# EAGLE schematic 8B_RAM_3 (EAGLE 6.5.0), part 1 of 2

## Sheet 1 of 44
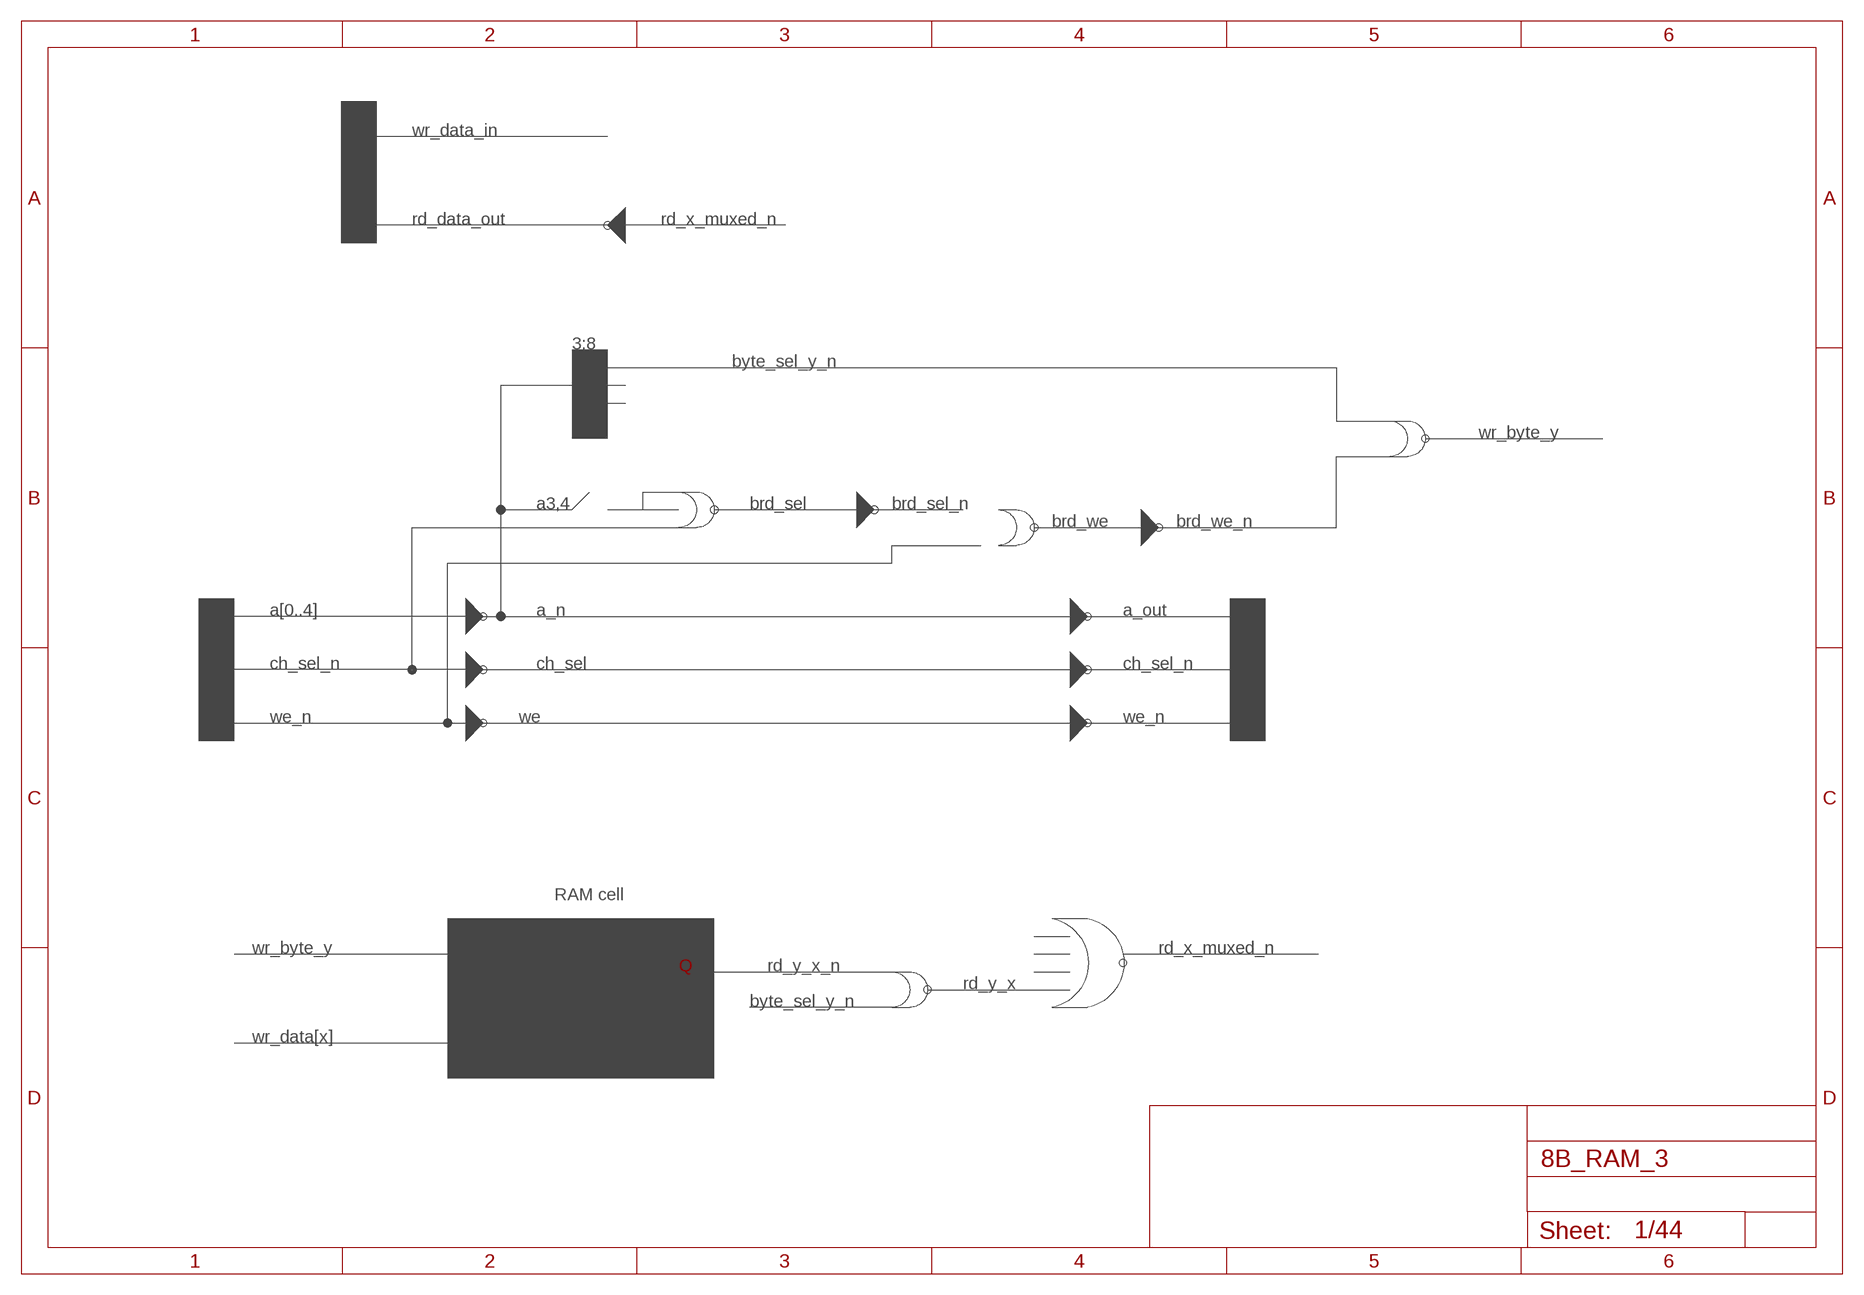
[diagram p0: schematic, sheet 1]

### Notes on the sheet
- wr_data_in
- rd_data_out | rd_x_muxed_n
- 3:8
- byte_sel_y_n
- wr_byte_y
- a3,4 | brd_sel | brd_sel_n
- brd_we | brd_we_n
- a[0..4] | a_n | a_out
- ch_sel_n | ch_sel | ch_sel_n
- we_n | we | we_n
- RAM cell
- wr_byte_y | rd_x_muxed_n
- Q | rd_y_x_n
- RAM cells | rd_y_x
- byte_sel_y_n
- wr_data[x]

## Sheet 2 of 44
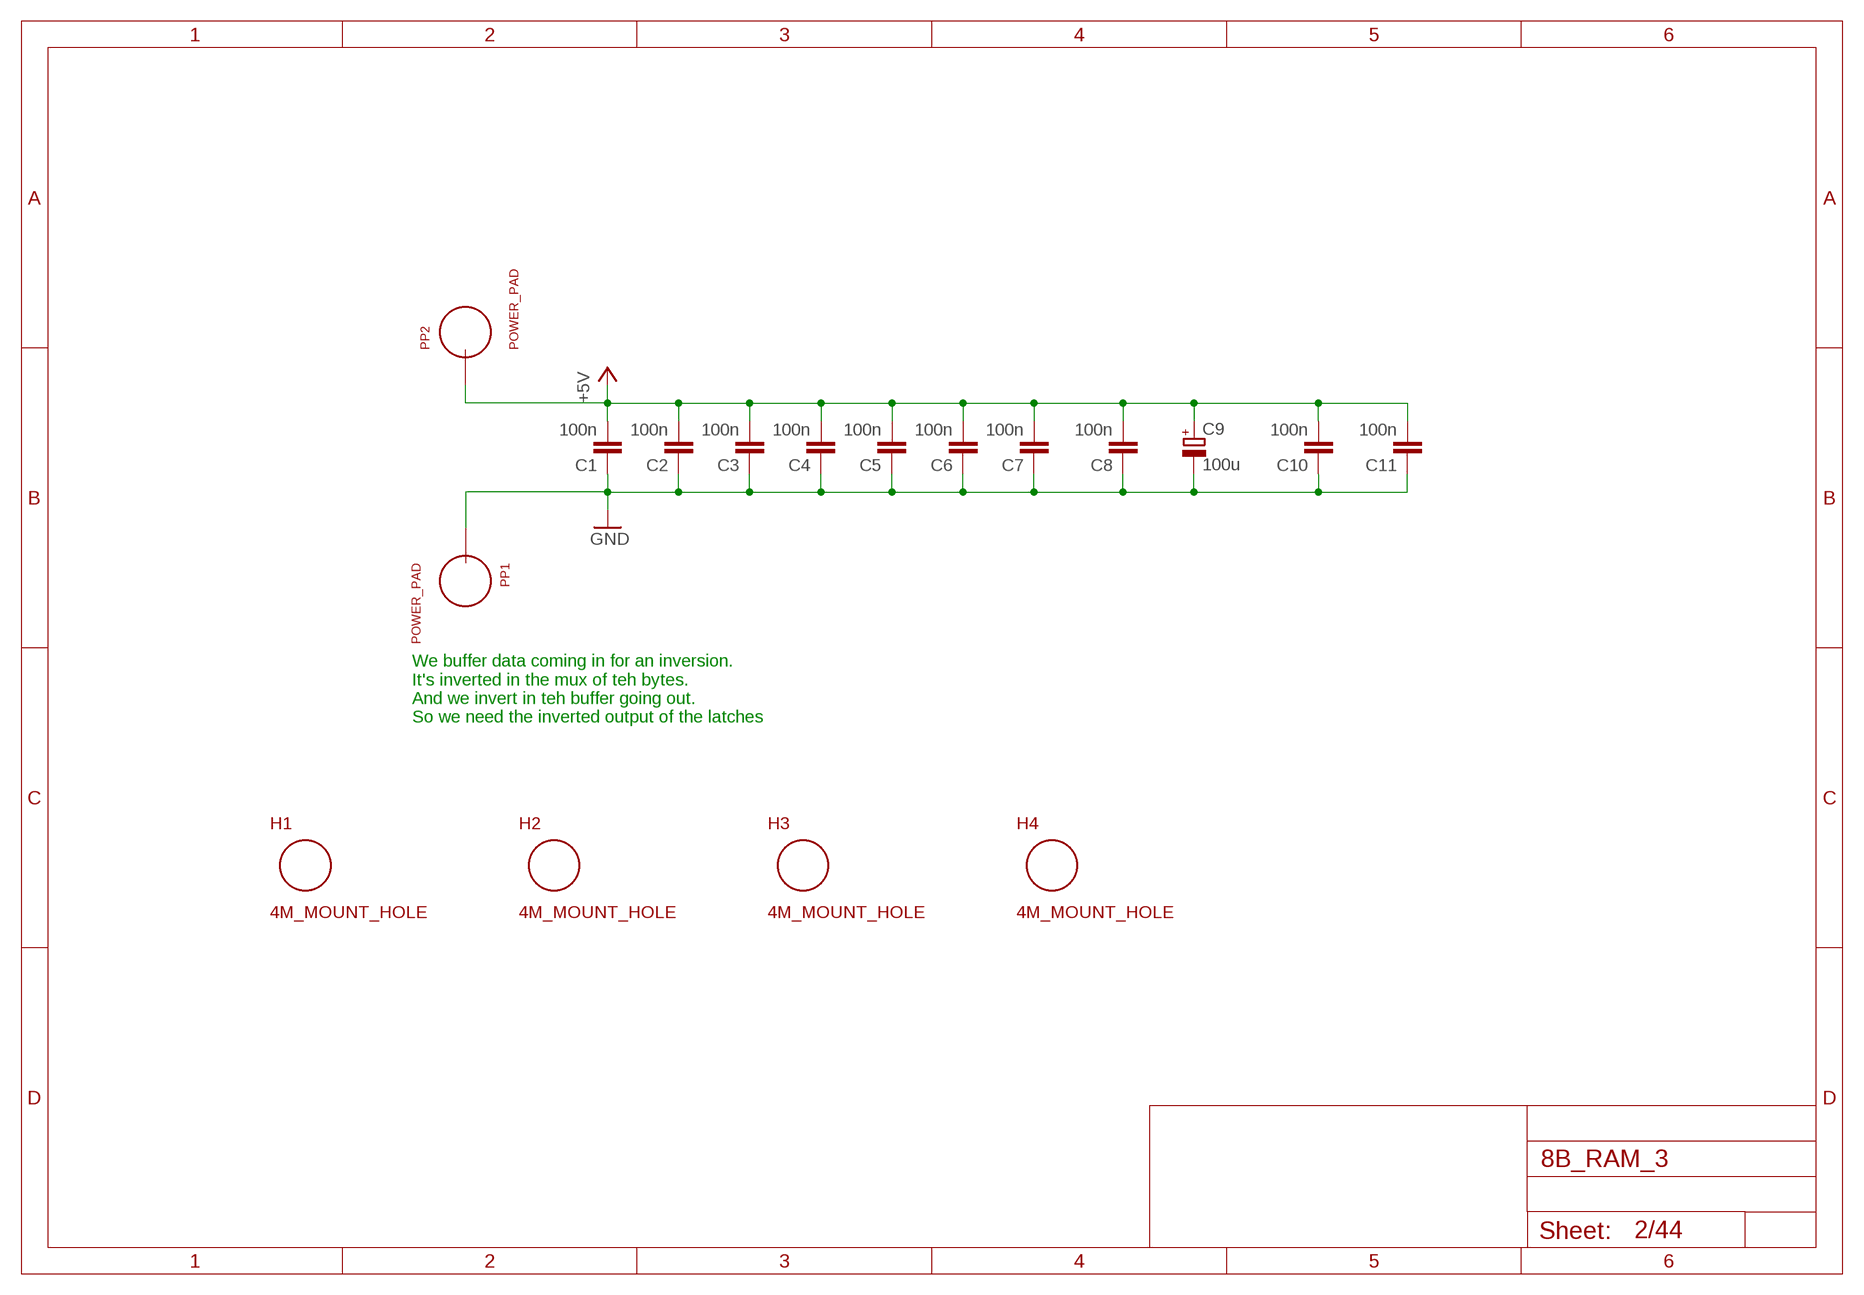
[diagram p1: schematic, sheet 2]

### Parts
C1  100n  C_P2INCH  [CAP_P2INCH]
C2  100n  C_P2INCH  [CAP_P2INCH]
C3  100n  C_P2INCH  [CAP_P2INCH]
C4  100n  C_P2INCH  [CAP_P2INCH]
C5  100n  C_P2INCH  [CAP_P2INCH]
C6  100n  C_P2INCH  [CAP_P2INCH]
C7  100n  C_P2INCH  [CAP_P2INCH]
C8  100n  C_P2INCH  [CAP_P2INCH]
C9  100u  POLARISED_CAP_2P5_6P3MM  [POLARISED_CAP_2P5_6P3MM]
C10  100n  C_P2INCH  [CAP_P2INCH]
C11  100n  C_P2INCH  [CAP_P2INCH]
H1  4M_MOUNT_HOLE  [4M_HOLE]
H2  4M_MOUNT_HOLE  [4M_HOLE]
H3  4M_MOUNT_HOLE  [4M_HOLE]
H4  4M_MOUNT_HOLE  [4M_HOLE]
PP1  POWER_PAD  [POWER_PAD]
PP2  POWER_PAD  [POWER_PAD]

### Nets
+5V: C1.2 C2.2 C3.2 C4.2 C5.2 C6.2 C7.2 C8.2 C9.A C10.2 C11.2 PP2.1 ; also sheet 4,5,6,7,8,9,10,11,12,13,14,15,16,17,18,19,20,21,22,23,24,25,26,27,28,29,30,31,32,33,34,35,36,37,38,39,40,41,42,43,44
GND: C1.1 C2.1 C3.1 C4.1 C5.1 C6.1 C7.1 C8.1 C9.K C10.1 C11.1 PP1.1 ; also sheet 3,4,5,6,7,8,9,10,11,12,13,14,15,16,17,18,19,20,21,22,23,24,25,26,27,28,29,30,31,32,33,34,35,36,37,38,39,40,41,42,43,44

### Notes on the sheet
- We buffer data coming in for an inversion.
  It's inverted in the mux of teh bytes.
  And we invert in teh buffer going out.
  So we need the inverted output of the latches

## Sheet 3 of 44
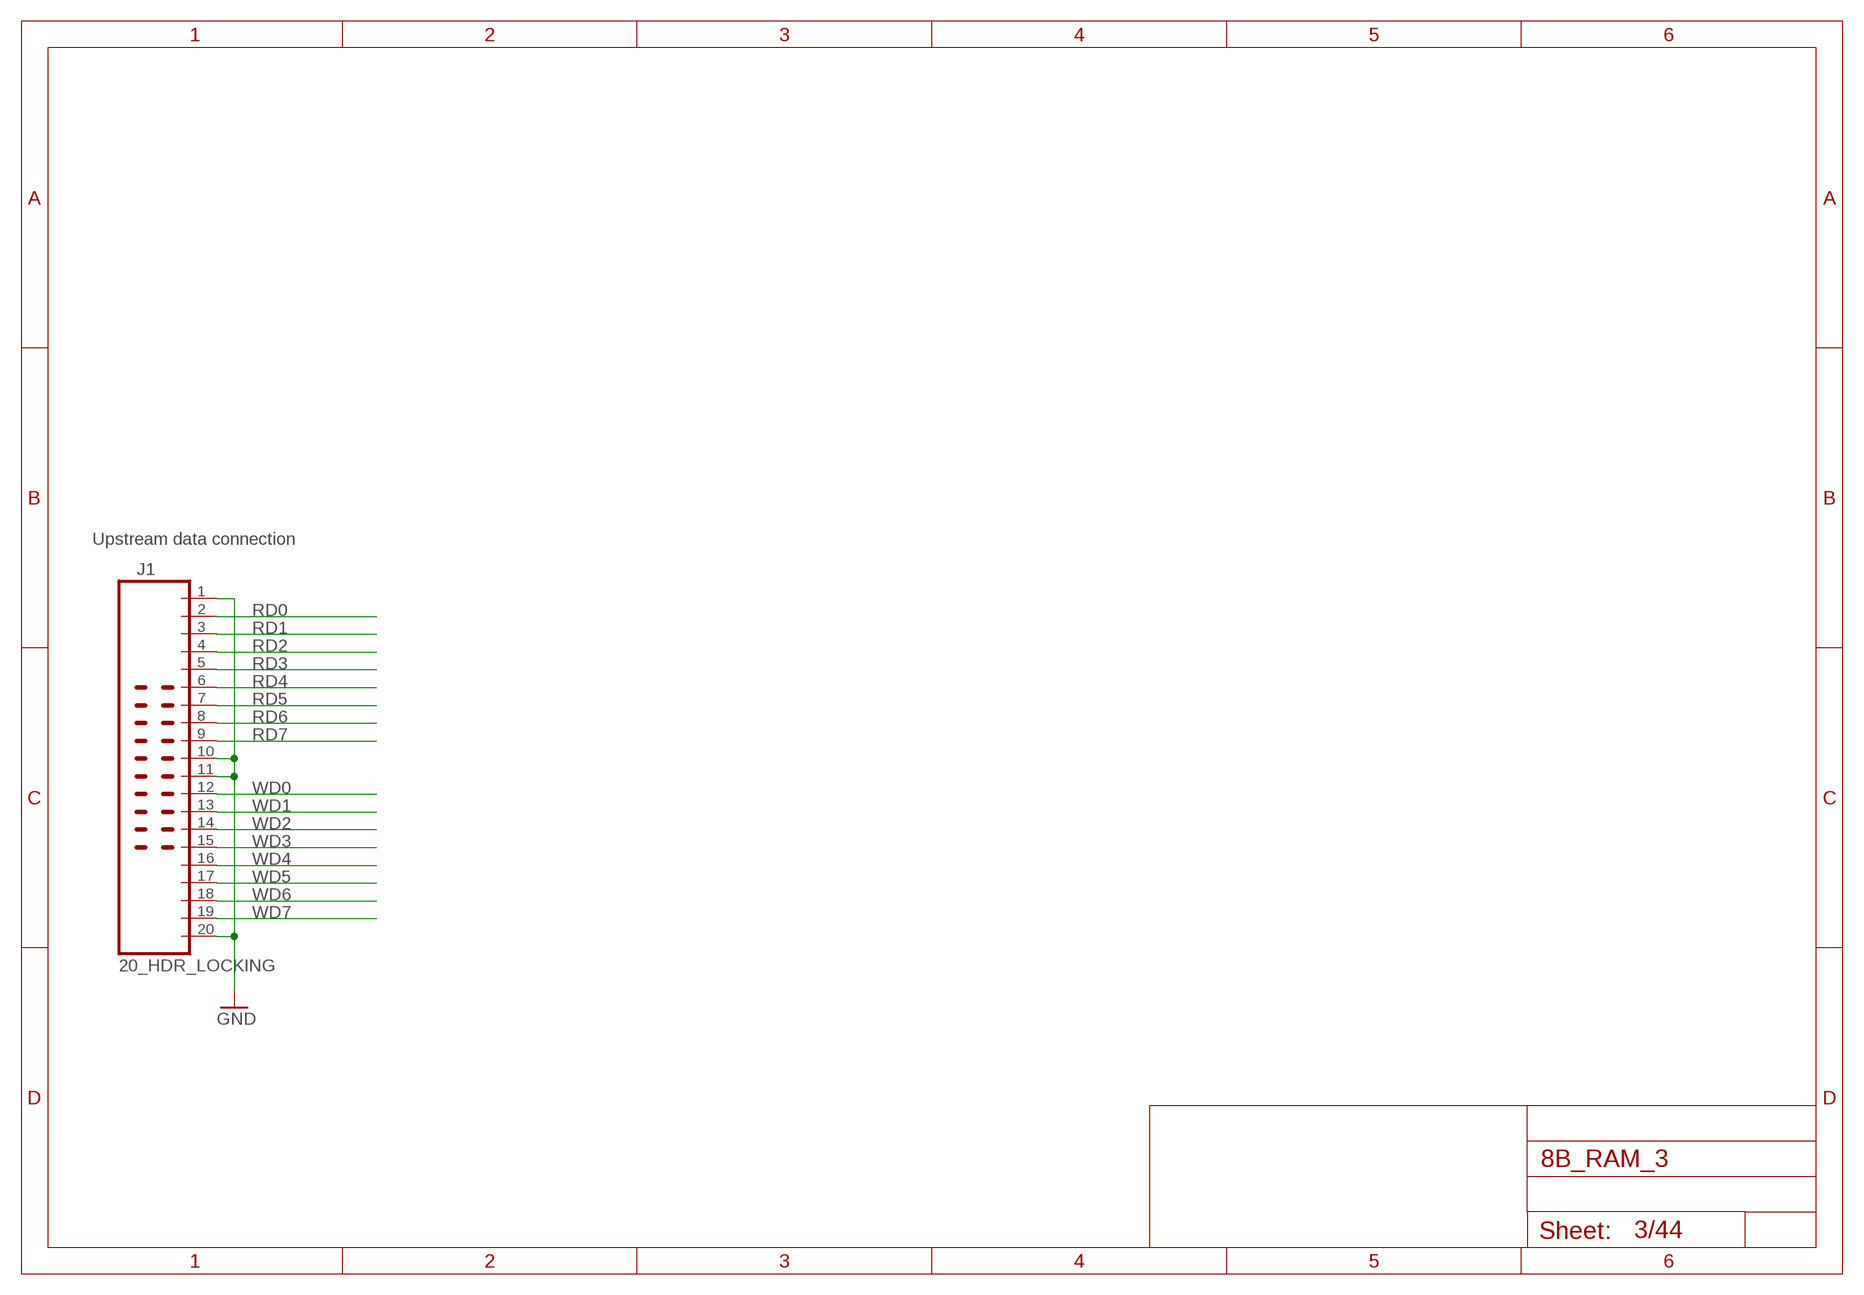
[diagram p2: schematic, sheet 3]

### Parts
J1  20_HDR_LOCKING  [20_HDR_LOCKING]

### Nets
GND: J1.1 J1.10 J1.11 J1.20 ; also sheet 2,4,5,6,7,8,9,10,11,12,13,14,15,16,17,18,19,20,21,22,23,24,25,26,27,28,29,30,31,32,33,34,35,36,37,38,39,40,41,42,43,44
RD0: J1.2 ; also sheet 41
RD1: J1.3 ; also sheet 41
RD2: J1.4 ; also sheet 42
RD3: J1.5 ; also sheet 42
RD4: J1.6 ; also sheet 43
RD5: J1.7 ; also sheet 43
RD6: J1.8 ; also sheet 44
RD7: J1.9 ; also sheet 44
WD0: J1.12 ; also sheet 9,13,17,21,25,29,33,37
WD1: J1.13 ; also sheet 9,13,17,21,25,29,33,37
WD2: J1.14 ; also sheet 10,14,18,22,26,30,34,38
WD3: J1.15 ; also sheet 10,14,18,22,26,30,34,38
WD4: J1.16 ; also sheet 11,15,19,23,27,31,35,39
WD5: J1.17 ; also sheet 11,15,19,23,27,31,35,39
WD6: J1.18 ; also sheet 12,16,20,24,28,32,36,40
WD7: J1.19 ; also sheet 12,16,20,24,28,32,36,40

### Notes on the sheet
- Upstream data connection

## Sheet 4 of 44
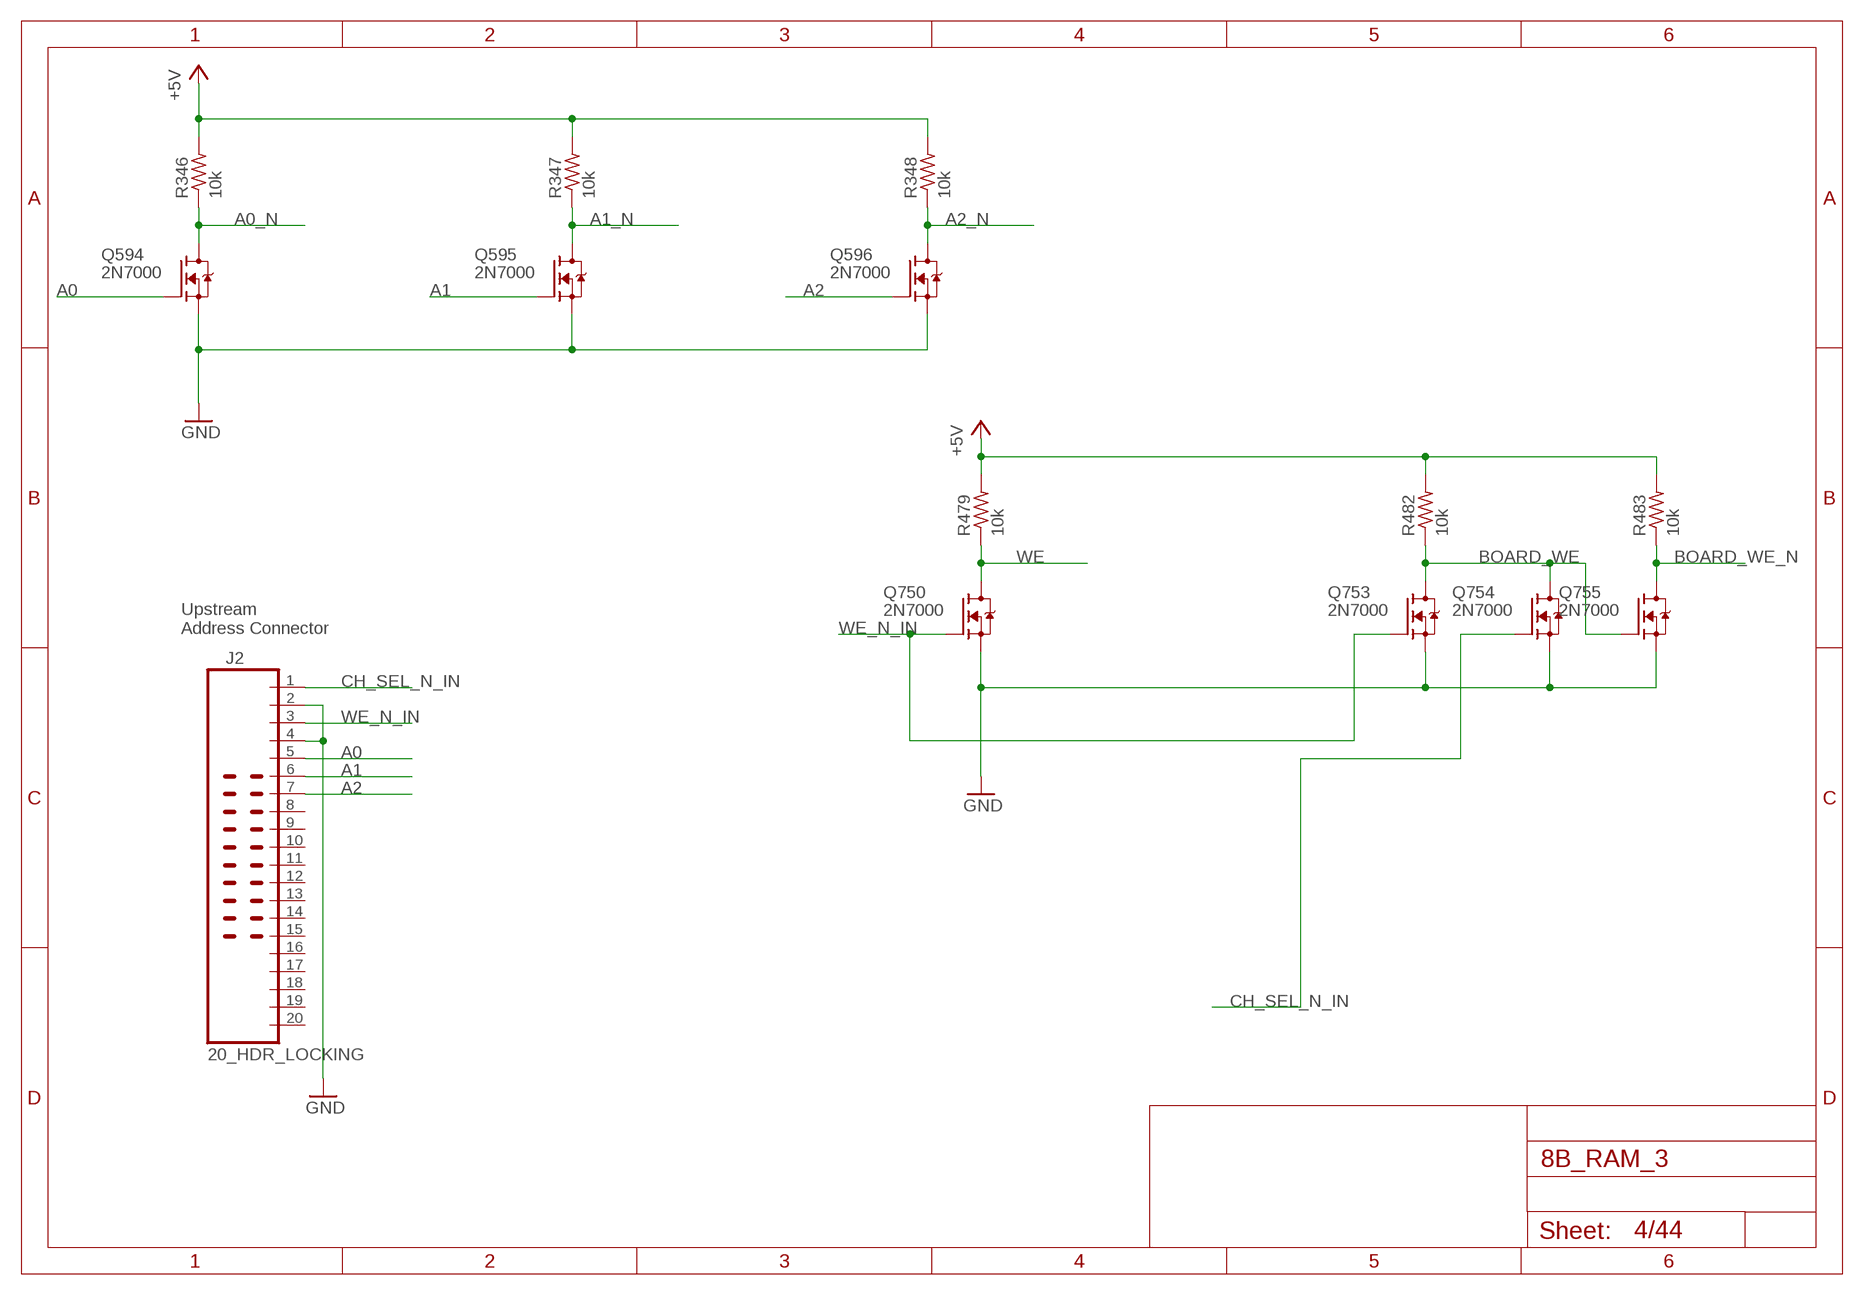
[diagram p3: schematic, sheet 4]

### Parts
J2  20_HDR_LOCKING  [20_HDR_LOCKING]
Q594  2N7000  [TO92-DGS]
Q595  2N7000  [TO92-DGS]
Q596  2N7000  [TO92-DGS]
Q750  2N7000  [TO92-DGS]
Q753  2N7000  [TO92-DGS]
Q754  2N7000  [TO92-DGS]
Q755  2N7000  [TO92-DGS]
R346  10k  R_P2INCH  [R_P2INCH]
R347  10k  R_P2INCH  [R_P2INCH]
R348  10k  R_P2INCH  [R_P2INCH]
R479  10k  R_P2INCH  [R_P2INCH]
R482  10k  R_P2INCH  [R_P2INCH]
R483  10k  R_P2INCH  [R_P2INCH]

### Nets
+5V: R346.2 R347.2 R348.2 R479.2 R482.2 R483.2 ; also sheet 2,5,6,7,8,9,10,11,12,13,14,15,16,17,18,19,20,21,22,23,24,25,26,27,28,29,30,31,32,33,34,35,36,37,38,39,40,41,42,43,44
A0: J2.5 Q594.G ; also sheet 5,6,7,8
A0_N: Q594.D R346.1 ; also sheet 5,6,7,8
A1: J2.6 Q595.G ; also sheet 6,8
A1_N: Q595.D R347.1 ; also sheet 5,7
A2: J2.7 Q596.G ; also sheet 7,8
A2_N: Q596.D R348.1 ; also sheet 5,6
BOARD_WE: Q753.D Q754.D Q755.G R482.1
BOARD_WE_N: Q755.D R483.1 ; also sheet 5,6,7,8
CH_SEL_N_IN: J2.1 Q754.G
GND: J2.2 J2.4 Q594.S Q595.S Q596.S Q750.S Q753.S Q754.S Q755.S ; also sheet 2,3,5,6,7,8,9,10,11,12,13,14,15,16,17,18,19,20,21,22,23,24,25,26,27,28,29,30,31,32,33,34,35,36,37,38,39,40,41,42,43,44
WE: Q750.D R479.1
WE_N_IN: J2.3 Q750.G Q753.G
Unconnected: J2.8 J2.9 J2.10 J2.11 J2.12 J2.13 J2.14 J2.15 J2.16 J2.17 J2.18 J2.19 J2.20

### Notes on the sheet
- Upstream
  Address Connector

## Sheet 5 of 44
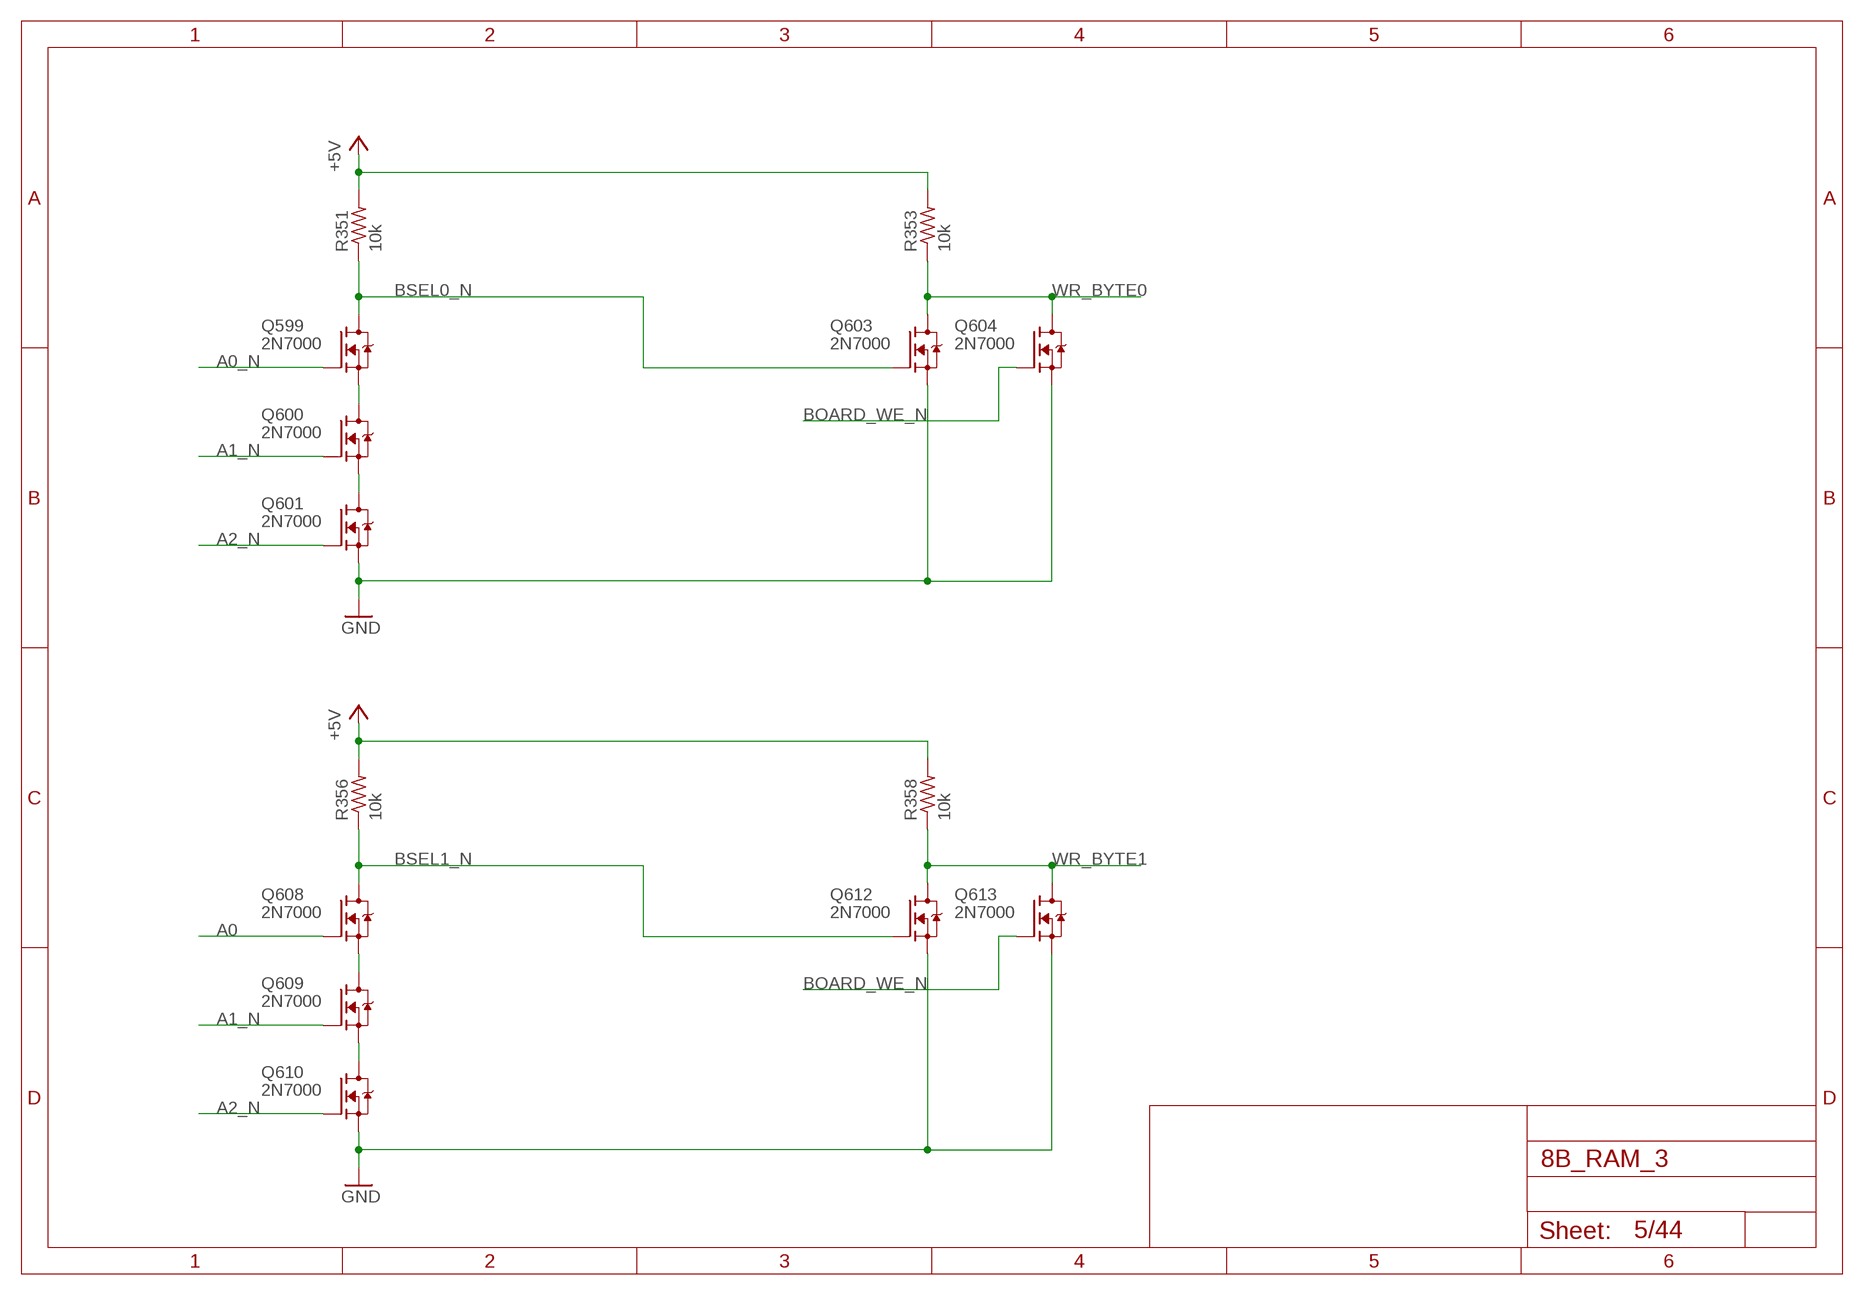
[diagram p4: schematic, sheet 5]

### Parts
Q599  2N7000  [TO92-DGS]
Q600  2N7000  [TO92-DGS]
Q601  2N7000  [TO92-DGS]
Q603  2N7000  [TO92-DGS]
Q604  2N7000  [TO92-DGS]
Q608  2N7000  [TO92-DGS]
Q609  2N7000  [TO92-DGS]
Q610  2N7000  [TO92-DGS]
Q612  2N7000  [TO92-DGS]
Q613  2N7000  [TO92-DGS]
R351  10k  R_P2INCH  [R_P2INCH]
R353  10k  R_P2INCH  [R_P2INCH]
R356  10k  R_P2INCH  [R_P2INCH]
R358  10k  R_P2INCH  [R_P2INCH]

### Nets
+5V: R351.2 R353.2 R356.2 R358.2 ; also sheet 2,4,6,7,8,9,10,11,12,13,14,15,16,17,18,19,20,21,22,23,24,25,26,27,28,29,30,31,32,33,34,35,36,37,38,39,40,41,42,43,44
A0: Q608.G ; also sheet 4,6,7,8
A0_N: Q599.G ; also sheet 4,6,7,8
A1_N: Q600.G Q609.G ; also sheet 4,7
A2_N: Q601.G Q610.G ; also sheet 4,6
BOARD_WE_N: Q604.G Q613.G ; also sheet 4,6,7,8
BSEL0_N: Q599.D Q603.G R351.1 ; also sheet 9,10,11,12
BSEL1_N: Q608.D Q612.G R356.1 ; also sheet 13,14,15,16
GND: Q601.S Q603.S Q604.S Q610.S Q612.S Q613.S ; also sheet 2,3,4,6,7,8,9,10,11,12,13,14,15,16,17,18,19,20,21,22,23,24,25,26,27,28,29,30,31,32,33,34,35,36,37,38,39,40,41,42,43,44
N$449: Q608.S Q609.D
N$451: Q599.S Q600.D
N$452: Q600.S Q601.D
N$454: Q609.S Q610.D
WR_BYTE0: Q603.D Q604.D R353.1 ; also sheet 9,10,11,12
WR_BYTE1: Q612.D Q613.D R358.1 ; also sheet 13,14,15,16

## Sheet 6 of 44
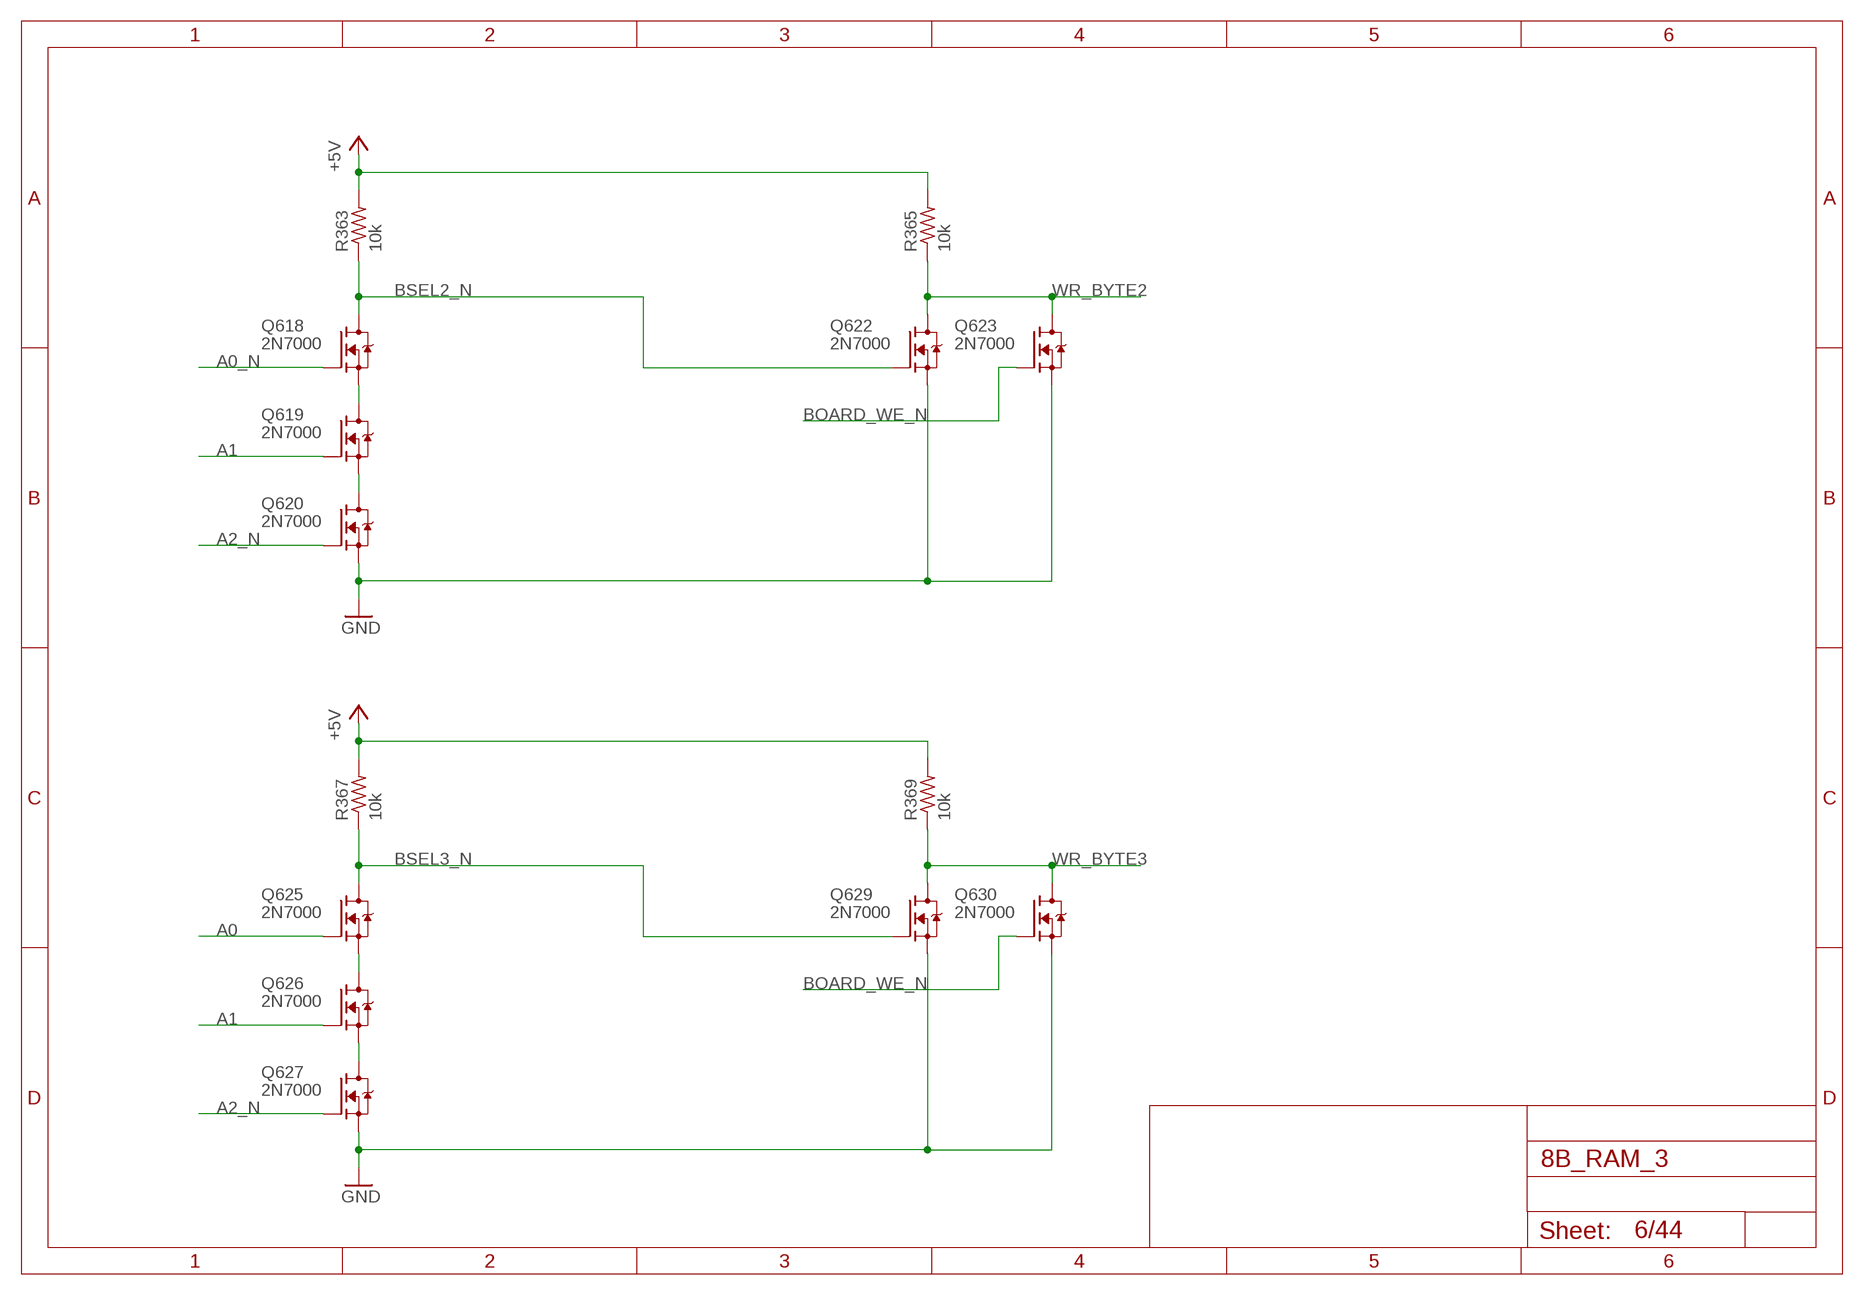
[diagram p5: schematic, sheet 6]

### Parts
Q618  2N7000  [TO92-DGS]
Q619  2N7000  [TO92-DGS]
Q620  2N7000  [TO92-DGS]
Q622  2N7000  [TO92-DGS]
Q623  2N7000  [TO92-DGS]
Q625  2N7000  [TO92-DGS]
Q626  2N7000  [TO92-DGS]
Q627  2N7000  [TO92-DGS]
Q629  2N7000  [TO92-DGS]
Q630  2N7000  [TO92-DGS]
R363  10k  R_P2INCH  [R_P2INCH]
R365  10k  R_P2INCH  [R_P2INCH]
R367  10k  R_P2INCH  [R_P2INCH]
R369  10k  R_P2INCH  [R_P2INCH]

### Nets
+5V: R363.2 R365.2 R367.2 R369.2 ; also sheet 2,4,5,7,8,9,10,11,12,13,14,15,16,17,18,19,20,21,22,23,24,25,26,27,28,29,30,31,32,33,34,35,36,37,38,39,40,41,42,43,44
A0: Q625.G ; also sheet 4,5,7,8
A0_N: Q618.G ; also sheet 4,5,7,8
A1: Q619.G Q626.G ; also sheet 4,8
A2_N: Q620.G Q627.G ; also sheet 4,5
BOARD_WE_N: Q623.G Q630.G ; also sheet 4,5,7,8
BSEL2_N: Q618.D Q622.G R363.1 ; also sheet 17,18,19,20
BSEL3_N: Q625.D Q629.G R367.1 ; also sheet 21,22,23,24
GND: Q620.S Q622.S Q623.S Q627.S Q629.S Q630.S ; also sheet 2,3,4,5,7,8,9,10,11,12,13,14,15,16,17,18,19,20,21,22,23,24,25,26,27,28,29,30,31,32,33,34,35,36,37,38,39,40,41,42,43,44
N$455: Q618.S Q619.D
N$456: Q619.S Q620.D
N$457: Q625.S Q626.D
N$458: Q626.S Q627.D
WR_BYTE2: Q622.D Q623.D R365.1 ; also sheet 17,18,19,20
WR_BYTE3: Q629.D Q630.D R369.1 ; also sheet 21,22,23,24

## Sheet 7 of 44
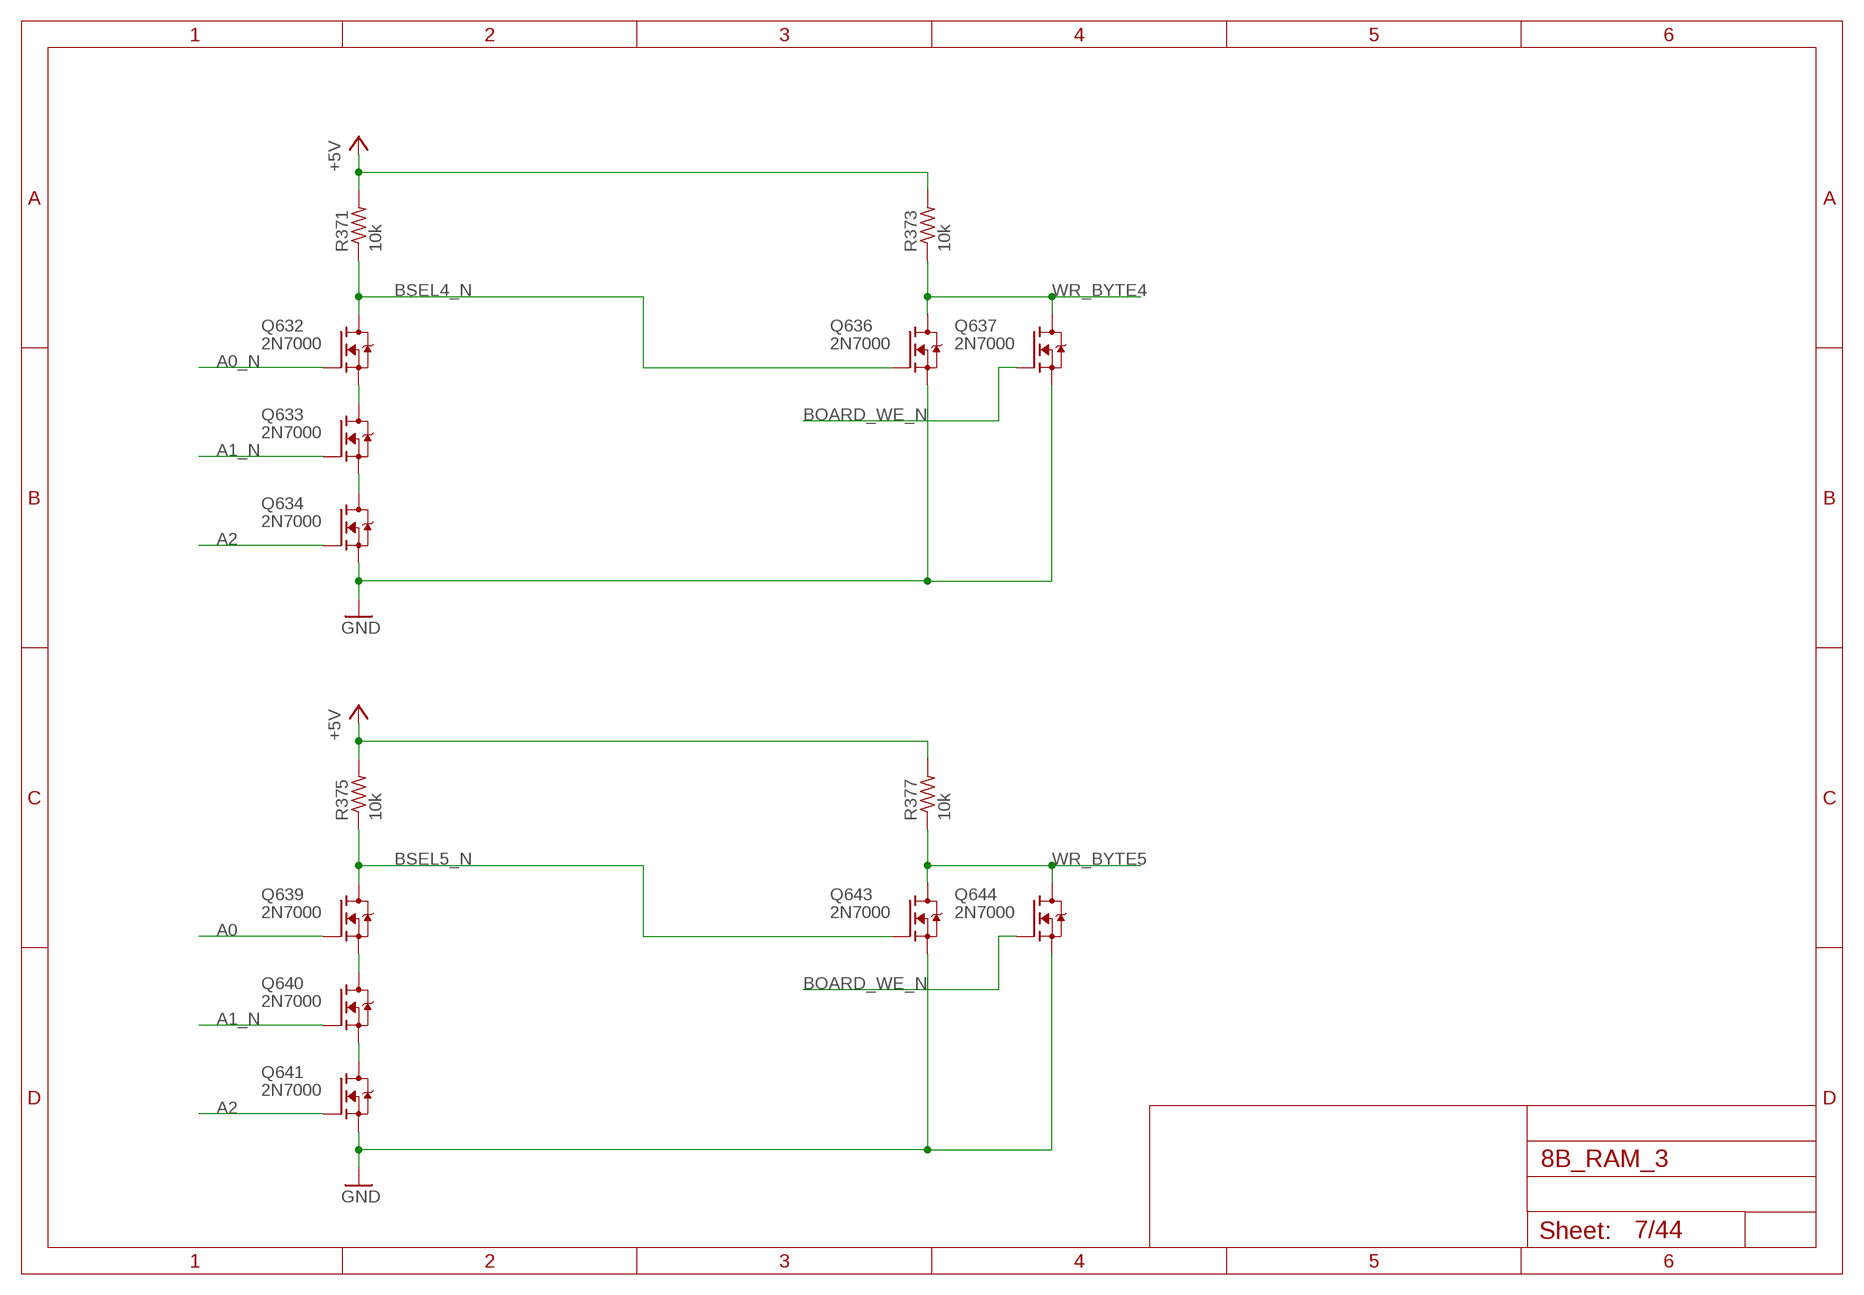
[diagram p6: schematic, sheet 7]

### Parts
Q632  2N7000  [TO92-DGS]
Q633  2N7000  [TO92-DGS]
Q634  2N7000  [TO92-DGS]
Q636  2N7000  [TO92-DGS]
Q637  2N7000  [TO92-DGS]
Q639  2N7000  [TO92-DGS]
Q640  2N7000  [TO92-DGS]
Q641  2N7000  [TO92-DGS]
Q643  2N7000  [TO92-DGS]
Q644  2N7000  [TO92-DGS]
R371  10k  R_P2INCH  [R_P2INCH]
R373  10k  R_P2INCH  [R_P2INCH]
R375  10k  R_P2INCH  [R_P2INCH]
R377  10k  R_P2INCH  [R_P2INCH]

### Nets
+5V: R371.2 R373.2 R375.2 R377.2 ; also sheet 2,4,5,6,8,9,10,11,12,13,14,15,16,17,18,19,20,21,22,23,24,25,26,27,28,29,30,31,32,33,34,35,36,37,38,39,40,41,42,43,44
A0: Q639.G ; also sheet 4,5,6,8
A0_N: Q632.G ; also sheet 4,5,6,8
A1_N: Q633.G Q640.G ; also sheet 4,5
A2: Q634.G Q641.G ; also sheet 4,8
BOARD_WE_N: Q637.G Q644.G ; also sheet 4,5,6,8
BSEL4_N: Q632.D Q636.G R371.1 ; also sheet 25,26,27,28
BSEL5_N: Q639.D Q643.G R375.1 ; also sheet 29,30,31,32
GND: Q634.S Q636.S Q637.S Q641.S Q643.S Q644.S ; also sheet 2,3,4,5,6,8,9,10,11,12,13,14,15,16,17,18,19,20,21,22,23,24,25,26,27,28,29,30,31,32,33,34,35,36,37,38,39,40,41,42,43,44
N$459: Q632.S Q633.D
N$460: Q633.S Q634.D
N$461: Q639.S Q640.D
N$462: Q640.S Q641.D
WR_BYTE4: Q636.D Q637.D R373.1 ; also sheet 25,26,27,28
WR_BYTE5: Q643.D Q644.D R377.1 ; also sheet 29,30,31,32

## Sheet 8 of 44
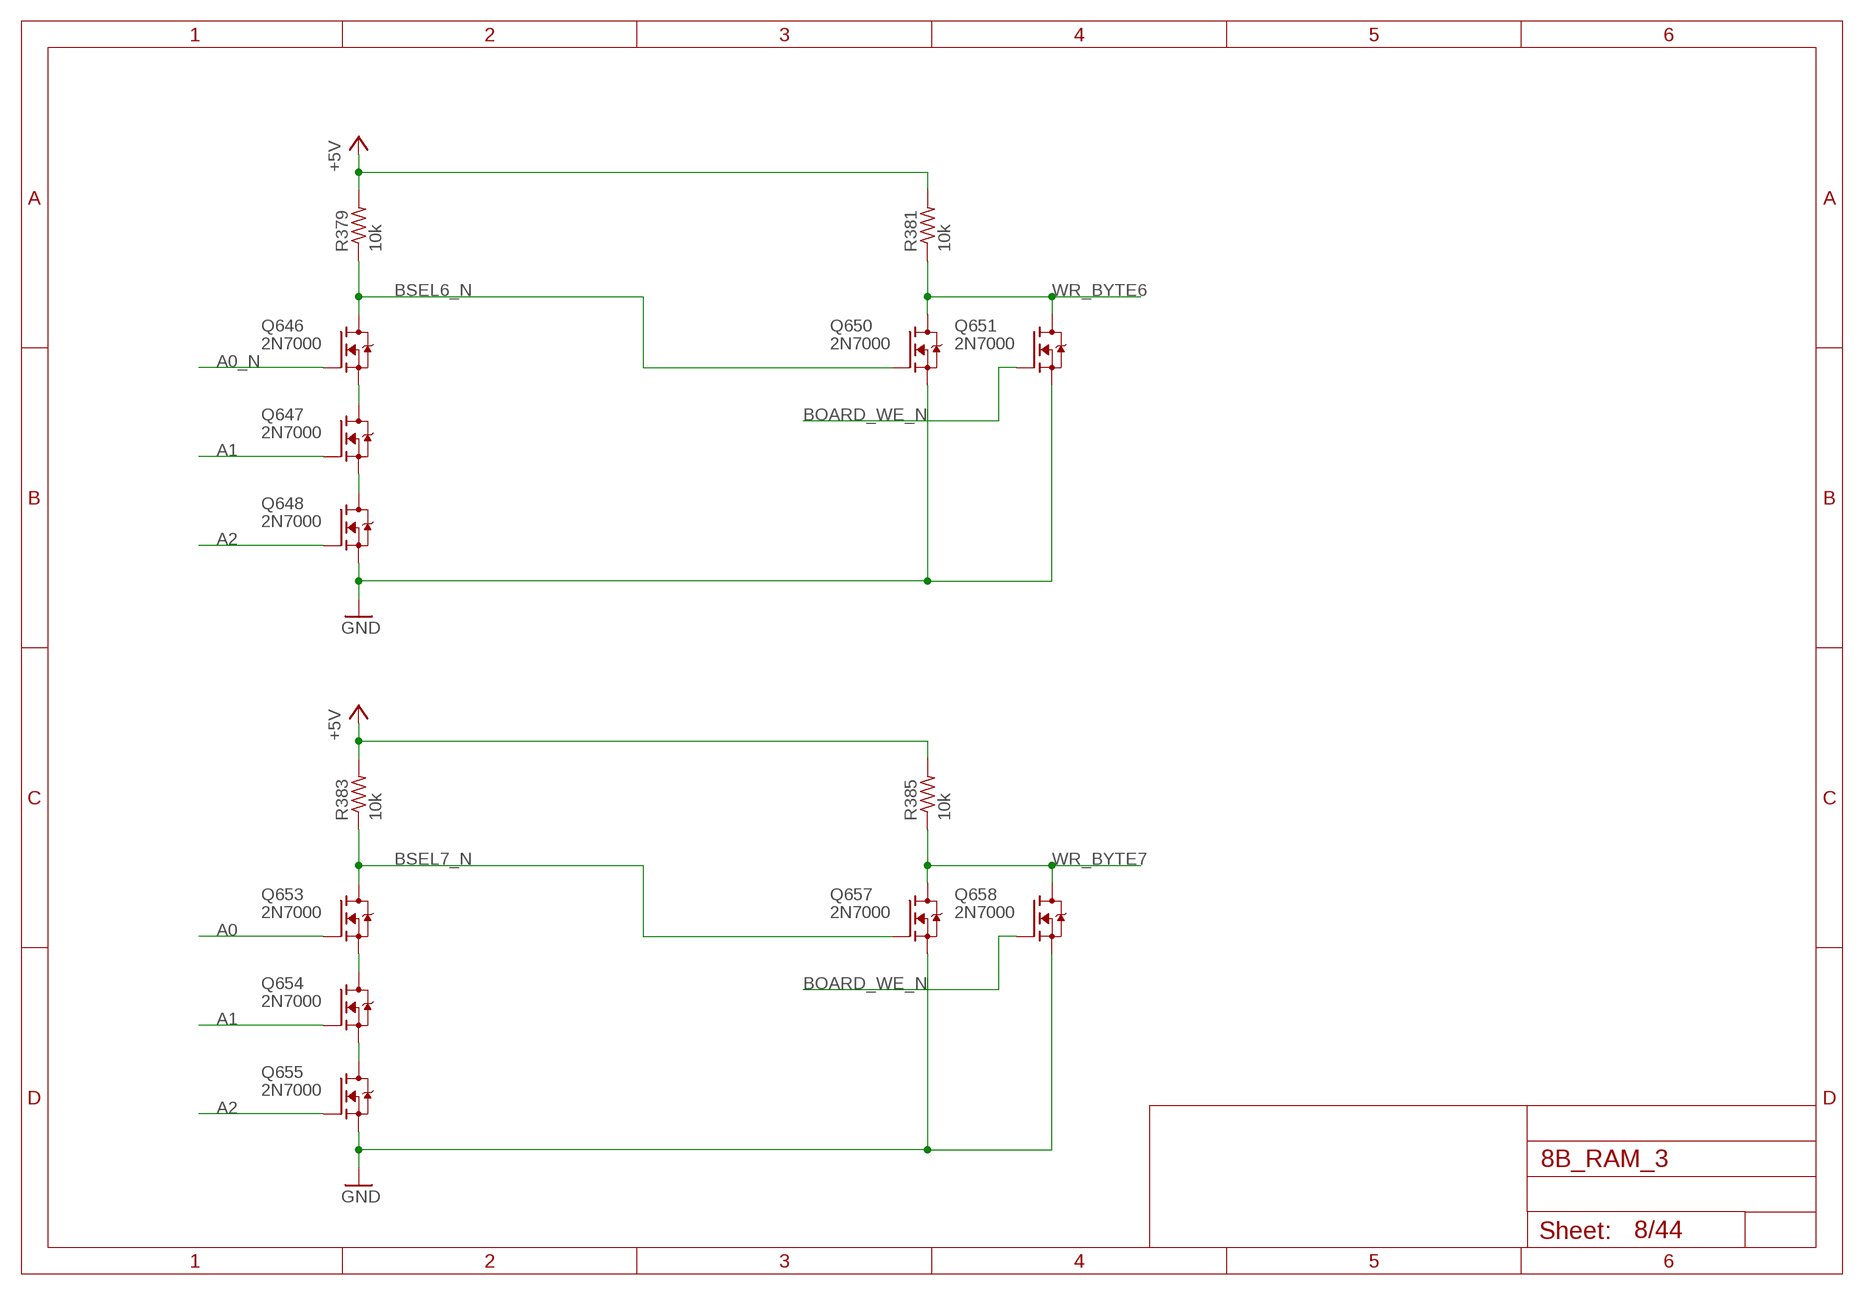
[diagram p7: schematic, sheet 8]

### Parts
Q646  2N7000  [TO92-DGS]
Q647  2N7000  [TO92-DGS]
Q648  2N7000  [TO92-DGS]
Q650  2N7000  [TO92-DGS]
Q651  2N7000  [TO92-DGS]
Q653  2N7000  [TO92-DGS]
Q654  2N7000  [TO92-DGS]
Q655  2N7000  [TO92-DGS]
Q657  2N7000  [TO92-DGS]
Q658  2N7000  [TO92-DGS]
R379  10k  R_P2INCH  [R_P2INCH]
R381  10k  R_P2INCH  [R_P2INCH]
R383  10k  R_P2INCH  [R_P2INCH]
R385  10k  R_P2INCH  [R_P2INCH]

### Nets
+5V: R379.2 R381.2 R383.2 R385.2 ; also sheet 2,4,5,6,7,9,10,11,12,13,14,15,16,17,18,19,20,21,22,23,24,25,26,27,28,29,30,31,32,33,34,35,36,37,38,39,40,41,42,43,44
A0: Q653.G ; also sheet 4,5,6,7
A0_N: Q646.G ; also sheet 4,5,6,7
A1: Q647.G Q654.G ; also sheet 4,6
A2: Q648.G Q655.G ; also sheet 4,7
BOARD_WE_N: Q651.G Q658.G ; also sheet 4,5,6,7
BSEL6_N: Q646.D Q650.G R379.1 ; also sheet 33,34,35,36
BSEL7_N: Q653.D Q657.G R383.1 ; also sheet 37,38,39,40
GND: Q648.S Q650.S Q651.S Q655.S Q657.S Q658.S ; also sheet 2,3,4,5,6,7,9,10,11,12,13,14,15,16,17,18,19,20,21,22,23,24,25,26,27,28,29,30,31,32,33,34,35,36,37,38,39,40,41,42,43,44
N$463: Q646.S Q647.D
N$464: Q647.S Q648.D
N$465: Q653.S Q654.D
N$466: Q654.S Q655.D
WR_BYTE6: Q650.D Q651.D R381.1 ; also sheet 33,34,35,36
WR_BYTE7: Q657.D Q658.D R385.1 ; also sheet 37,38,39,40

## Sheet 9 of 44
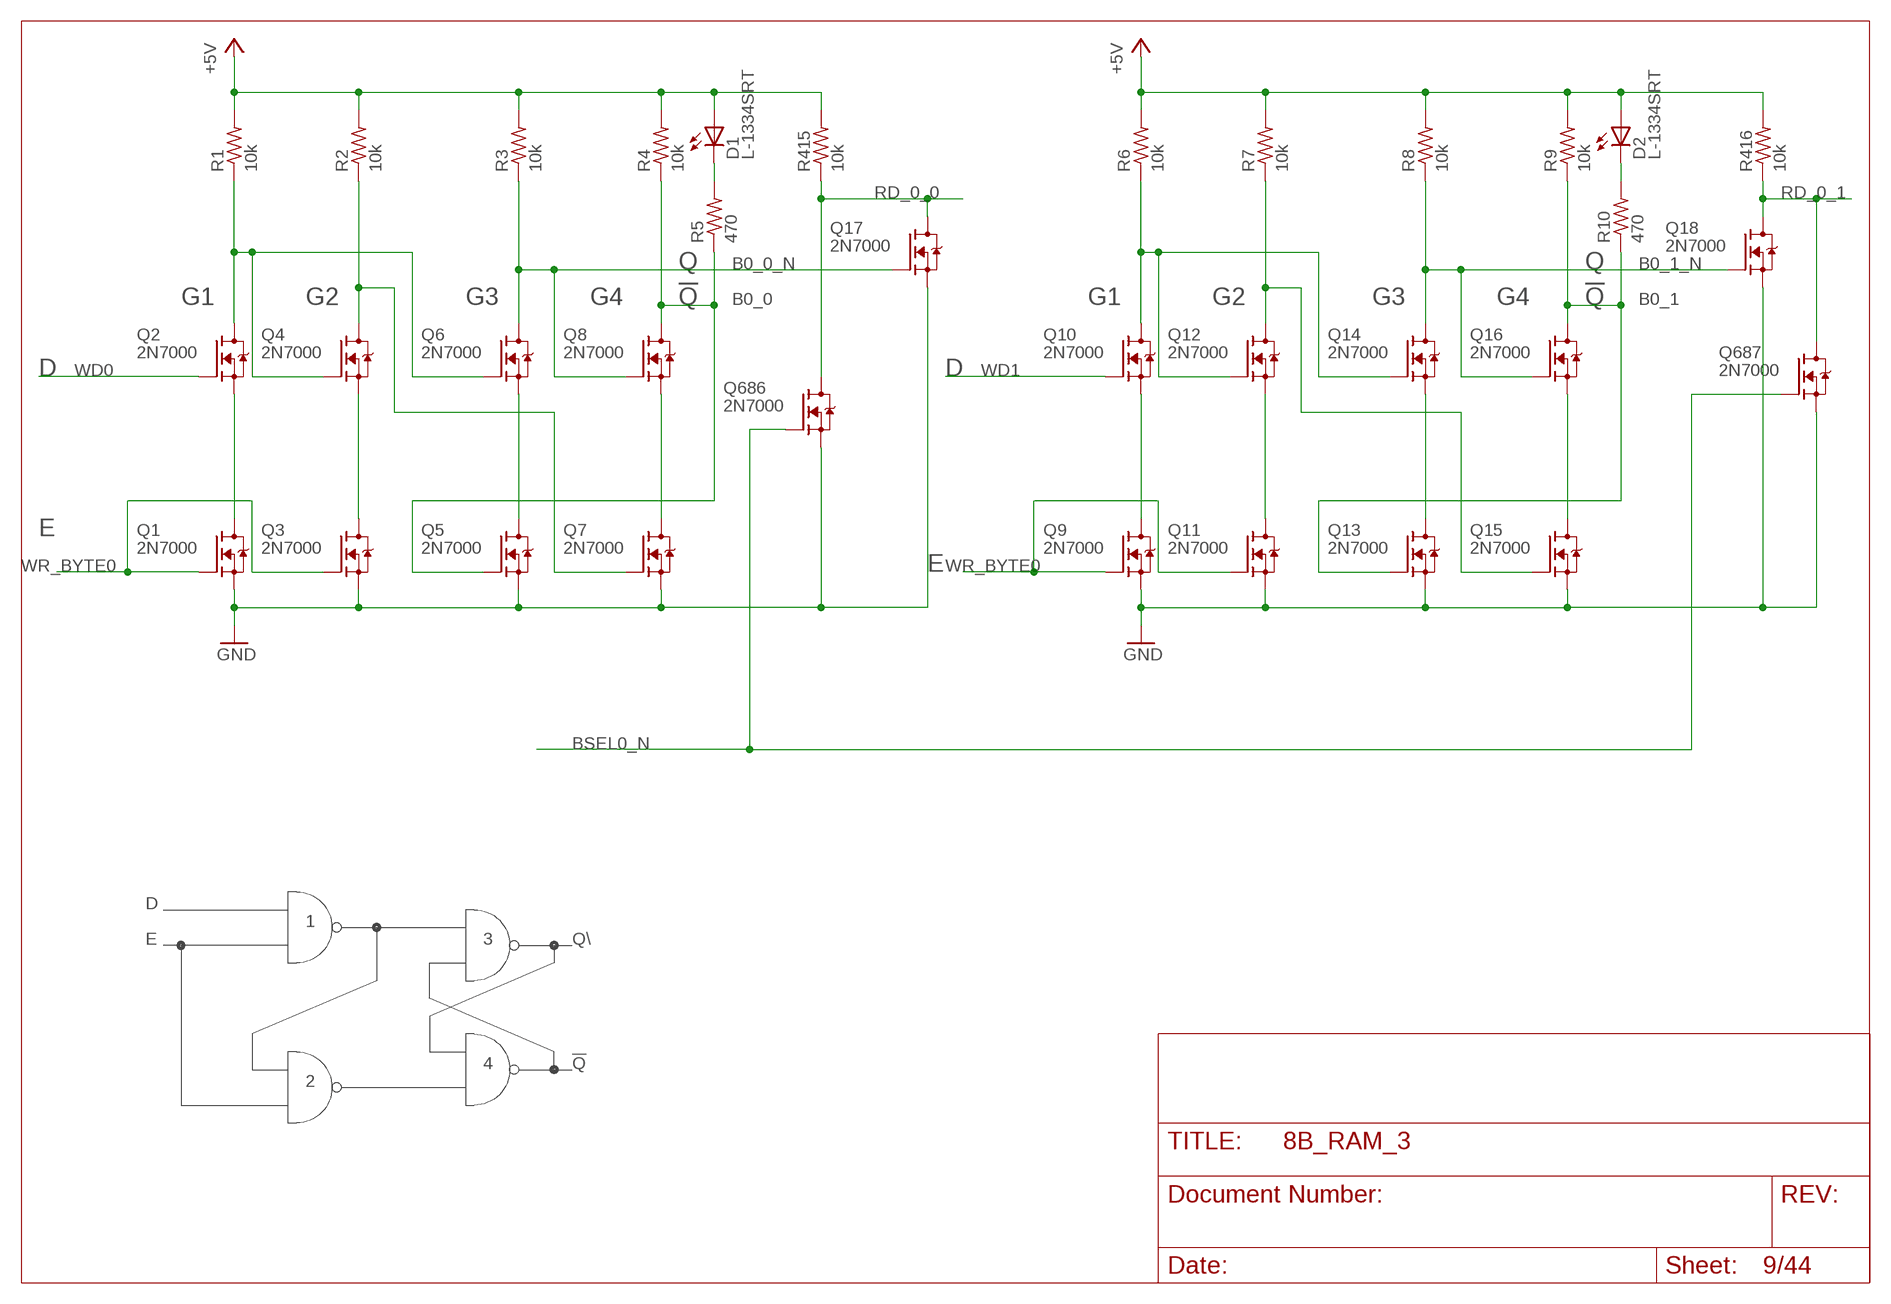
[diagram p8: schematic, sheet 9]

### Parts
D1  L-1334SRT  [LED3MM]
D2  L-1334SRT  [LED3MM]
Q1  2N7000  [TO92-DGS]
Q2  2N7000  [TO92-DGS]
Q3  2N7000  [TO92-DGS]
Q4  2N7000  [TO92-DGS]
Q5  2N7000  [TO92-DGS]
Q6  2N7000  [TO92-DGS]
Q7  2N7000  [TO92-DGS]
Q8  2N7000  [TO92-DGS]
Q9  2N7000  [TO92-DGS]
Q10  2N7000  [TO92-DGS]
Q11  2N7000  [TO92-DGS]
Q12  2N7000  [TO92-DGS]
Q13  2N7000  [TO92-DGS]
Q14  2N7000  [TO92-DGS]
Q15  2N7000  [TO92-DGS]
Q16  2N7000  [TO92-DGS]
Q17  2N7000  [TO92-DGS]
Q18  2N7000  [TO92-DGS]
Q686  2N7000  [TO92-DGS]
Q687  2N7000  [TO92-DGS]
R1  10k  R_P2INCH  [R_P2INCH]
R2  10k  R_P2INCH  [R_P2INCH]
R3  10k  R_P2INCH  [R_P2INCH]
R4  10k  R_P2INCH  [R_P2INCH]
R5  470  R_P2INCH  [R_P2INCH]
R6  10k  R_P2INCH  [R_P2INCH]
R7  10k  R_P2INCH  [R_P2INCH]
R8  10k  R_P2INCH  [R_P2INCH]
R9  10k  R_P2INCH  [R_P2INCH]
R10  470  R_P2INCH  [R_P2INCH]
R415  10k  R_P2INCH  [R_P2INCH]
R416  10k  R_P2INCH  [R_P2INCH]

### Nets
+5V: D1.A D2.A R1.2 R2.2 R3.2 R4.2 R6.2 R7.2 R8.2 R9.2 R415.2 R416.2 ; also sheet 2,4,5,6,7,8,10,11,12,13,14,15,16,17,18,19,20,21,22,23,24,25,26,27,28,29,30,31,32,33,34,35,36,37,38,39,40,41,42,43,44
B0_0: Q5.G Q8.D R4.1 R5.1
B0_0_N: Q6.D Q8.G Q17.G R3.1
B0_1: Q13.G Q16.D R9.1 R10.1
B0_1_N: Q14.D Q16.G Q18.G R8.1
BSEL0_N: Q686.G Q687.G ; also sheet 5,10,11,12
GND: Q1.S Q3.S Q5.S Q7.S Q9.S Q11.S Q13.S Q15.S Q17.S Q18.S Q686.S Q687.S ; also sheet 2,3,4,5,6,7,8,10,11,12,13,14,15,16,17,18,19,20,21,22,23,24,25,26,27,28,29,30,31,32,33,34,35,36,37,38,39,40,41,42,43,44
N$4: Q9.D Q10.S
N$5: Q7.D Q8.S
N$7: Q11.D Q12.S
N$8: Q13.D Q14.S
N$9: Q1.D Q2.S
N$10: Q3.D Q4.S
N$11: Q10.D Q12.G Q14.G R6.1
N$12: Q5.D Q6.S
N$13: Q12.D Q15.G R7.1
N$14: D2.K(C) R10.2
N$16: Q2.D Q4.G Q6.G R1.1
N$17: Q4.D Q7.G R2.1
N$20: Q15.D Q16.S
N$25: D1.K(C) R5.2
RD_0_0: Q17.D Q686.D R415.1 ; also sheet 41
RD_0_1: Q18.D Q687.D R416.1 ; also sheet 41
WD0: Q2.G ; also sheet 3,13,17,21,25,29,33,37
WD1: Q10.G ; also sheet 3,13,17,21,25,29,33,37
WR_BYTE0: Q1.G Q3.G Q9.G Q11.G ; also sheet 5,10,11,12

### Notes on the sheet
- Q | Q
- G1 | G2 | G3 | G4 | !Q | G1 | G2 | G3 | G4 | !Q
- D | D
- E
- E
- D
- 1
- E | 3 | Q\
- 4 | !Q
- 2

## Sheet 10 of 44
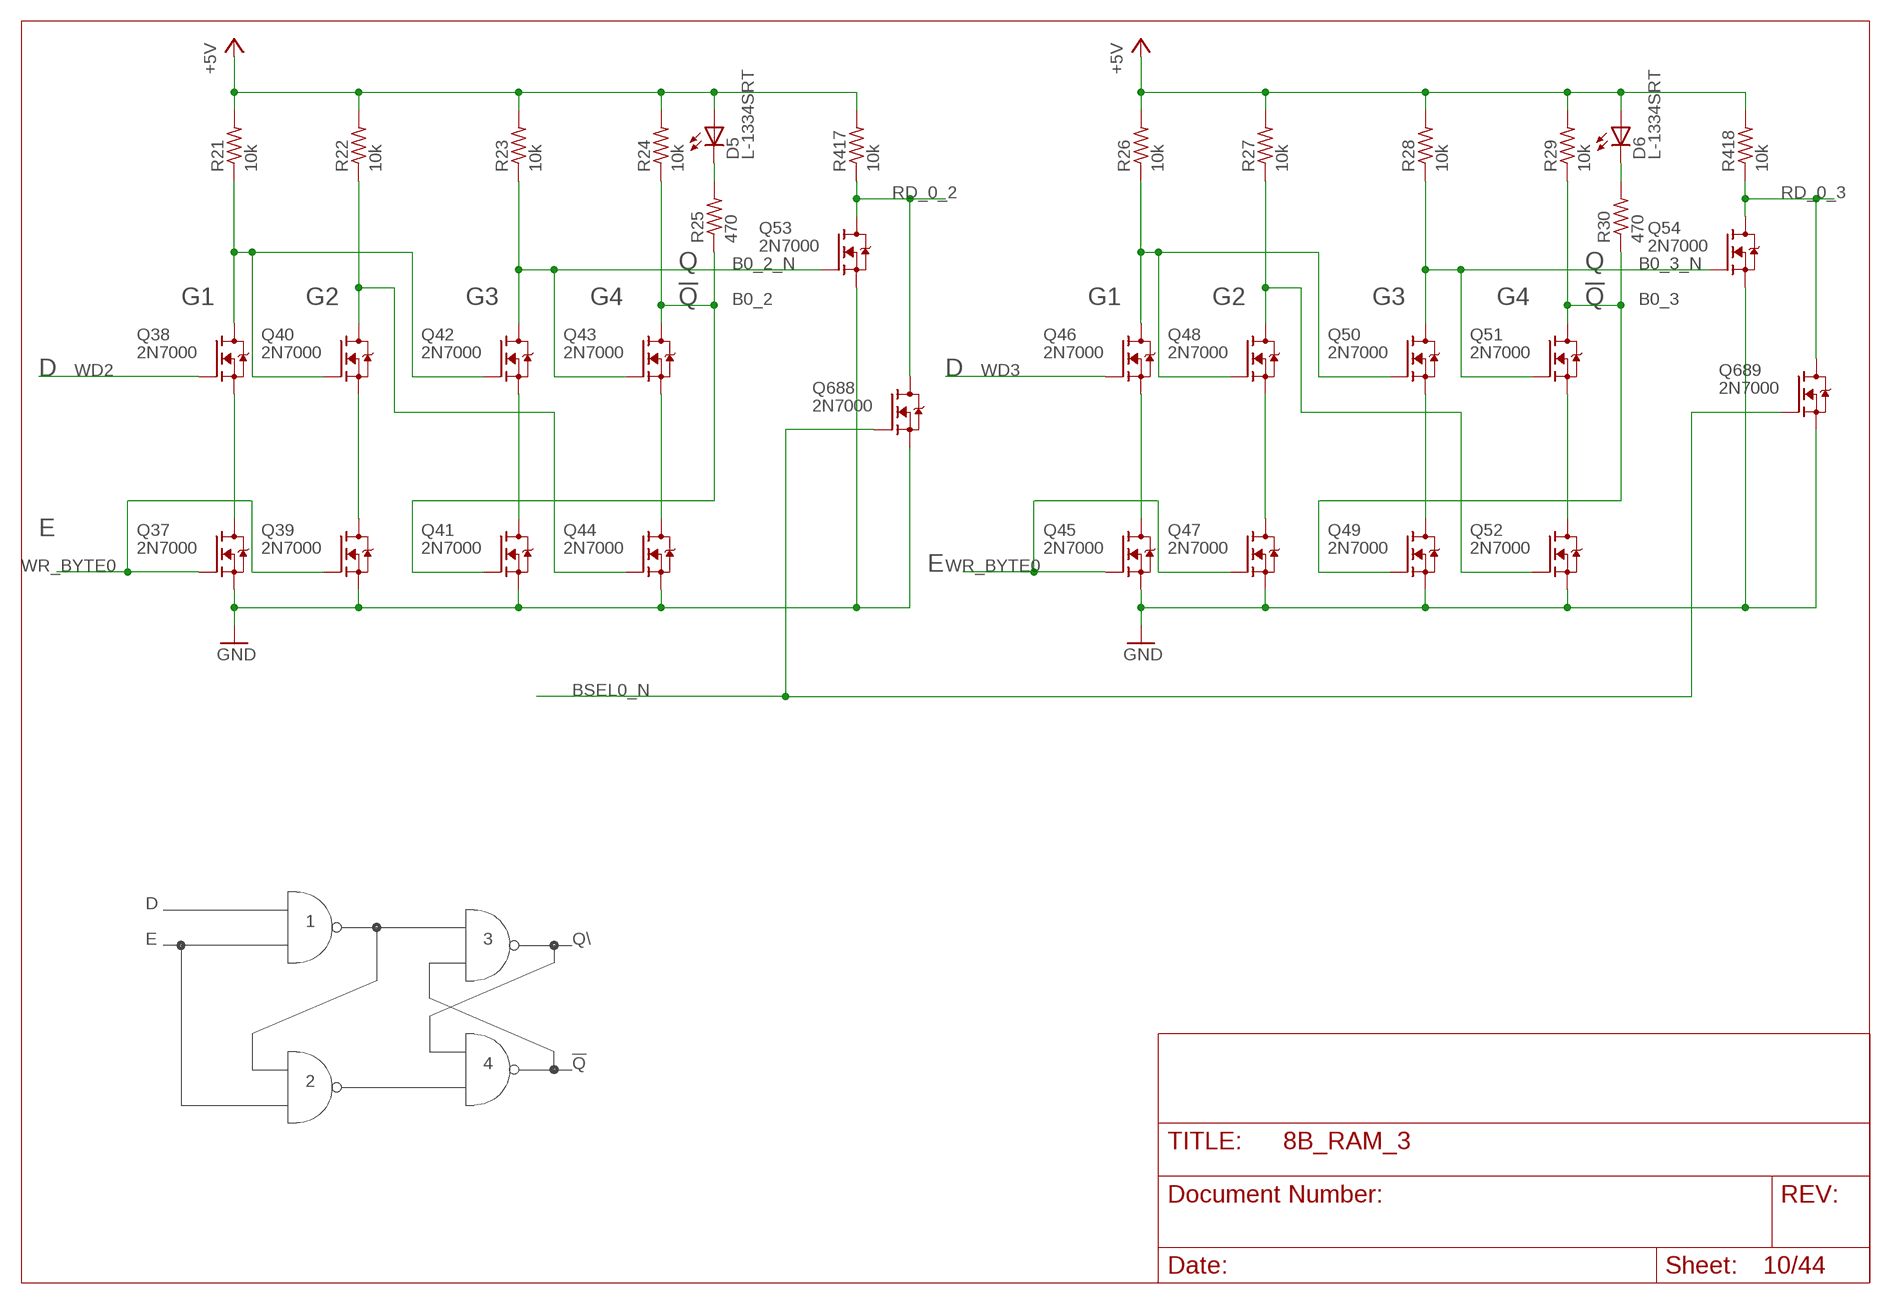
[diagram p9: schematic, sheet 10]

### Parts
D5  L-1334SRT  [LED3MM]
D6  L-1334SRT  [LED3MM]
Q37  2N7000  [TO92-DGS]
Q38  2N7000  [TO92-DGS]
Q39  2N7000  [TO92-DGS]
Q40  2N7000  [TO92-DGS]
Q41  2N7000  [TO92-DGS]
Q42  2N7000  [TO92-DGS]
Q43  2N7000  [TO92-DGS]
Q44  2N7000  [TO92-DGS]
Q45  2N7000  [TO92-DGS]
Q46  2N7000  [TO92-DGS]
Q47  2N7000  [TO92-DGS]
Q48  2N7000  [TO92-DGS]
Q49  2N7000  [TO92-DGS]
Q50  2N7000  [TO92-DGS]
Q51  2N7000  [TO92-DGS]
Q52  2N7000  [TO92-DGS]
Q53  2N7000  [TO92-DGS]
Q54  2N7000  [TO92-DGS]
Q688  2N7000  [TO92-DGS]
Q689  2N7000  [TO92-DGS]
R21  10k  R_P2INCH  [R_P2INCH]
R22  10k  R_P2INCH  [R_P2INCH]
R23  10k  R_P2INCH  [R_P2INCH]
R24  10k  R_P2INCH  [R_P2INCH]
R25  470  R_P2INCH  [R_P2INCH]
R26  10k  R_P2INCH  [R_P2INCH]
R27  10k  R_P2INCH  [R_P2INCH]
R28  10k  R_P2INCH  [R_P2INCH]
R29  10k  R_P2INCH  [R_P2INCH]
R30  470  R_P2INCH  [R_P2INCH]
R417  10k  R_P2INCH  [R_P2INCH]
R418  10k  R_P2INCH  [R_P2INCH]

### Nets
+5V: D5.A D6.A R21.2 R22.2 R23.2 R24.2 R26.2 R27.2 R28.2 R29.2 R417.2 R418.2 ; also sheet 2,4,5,6,7,8,9,11,12,13,14,15,16,17,18,19,20,21,22,23,24,25,26,27,28,29,30,31,32,33,34,35,36,37,38,39,40,41,42,43,44
B0_2: Q41.G Q43.D R24.1 R25.1
B0_2_N: Q42.D Q43.G Q53.G R23.1
B0_3: Q49.G Q51.D R29.1 R30.1
B0_3_N: Q50.D Q51.G Q54.G R28.1
BSEL0_N: Q688.G Q689.G ; also sheet 5,9,11,12
GND: Q37.S Q39.S Q41.S Q44.S Q45.S Q47.S Q49.S Q52.S Q53.S Q54.S Q688.S Q689.S ; also sheet 2,3,4,5,6,7,8,9,11,12,13,14,15,16,17,18,19,20,21,22,23,24,25,26,27,28,29,30,31,32,33,34,35,36,37,38,39,40,41,42,43,44
N$29: Q37.D Q38.S
N$30: Q39.D Q40.S
N$31: Q41.D Q42.S
N$32: Q38.D Q40.G Q42.G R21.1
N$33: Q40.D Q44.G R22.1
N$34: D5.K(C) R25.2
N$35: Q43.S Q44.D
N$36: Q45.D Q46.S
N$37: Q47.D Q48.S
N$38: Q49.D Q50.S
N$39: Q46.D Q48.G Q50.G R26.1
N$40: Q48.D Q52.G R27.1
N$41: D6.K(C) R30.2
N$42: Q51.S Q52.D
RD_0_2: Q53.D Q688.D R417.1 ; also sheet 42
RD_0_3: Q54.D Q689.D R418.1 ; also sheet 42
WD2: Q38.G ; also sheet 3,14,18,22,26,30,34,38
WD3: Q46.G ; also sheet 3,14,18,22,26,30,34,38
WR_BYTE0: Q37.G Q39.G Q45.G Q47.G ; also sheet 5,9,11,12

### Notes on the sheet
- Q | Q
- G1 | G2 | G3 | G4 | !Q | G1 | G2 | G3 | G4 | !Q
- D | D
- E
- E
- D
- 1
- E | 3 | Q\
- 4 | !Q
- 2

## Sheet 11 of 44
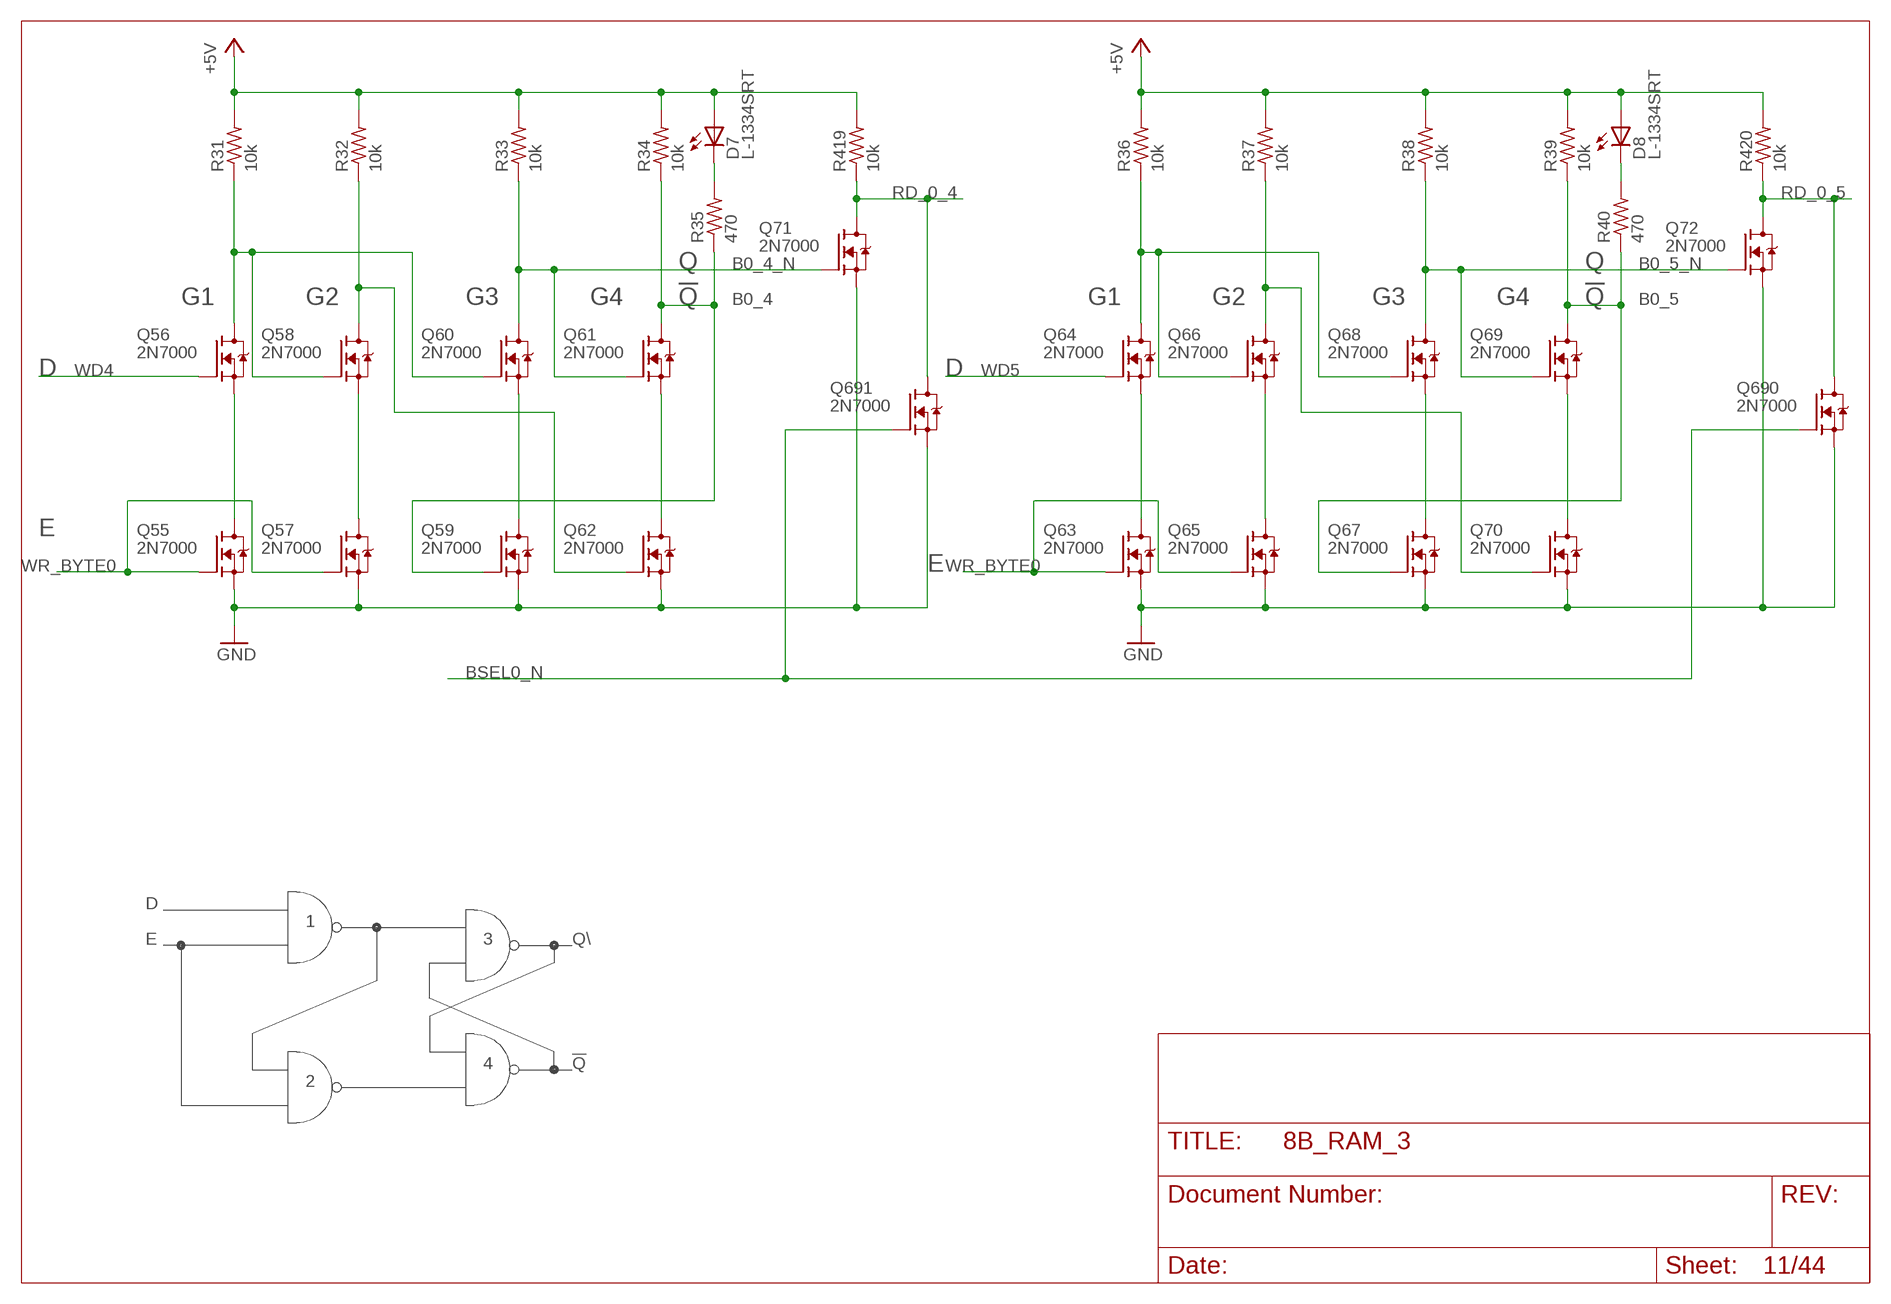
[diagram p10: schematic, sheet 11]

### Parts
D7  L-1334SRT  [LED3MM]
D8  L-1334SRT  [LED3MM]
Q55  2N7000  [TO92-DGS]
Q56  2N7000  [TO92-DGS]
Q57  2N7000  [TO92-DGS]
Q58  2N7000  [TO92-DGS]
Q59  2N7000  [TO92-DGS]
Q60  2N7000  [TO92-DGS]
Q61  2N7000  [TO92-DGS]
Q62  2N7000  [TO92-DGS]
Q63  2N7000  [TO92-DGS]
Q64  2N7000  [TO92-DGS]
Q65  2N7000  [TO92-DGS]
Q66  2N7000  [TO92-DGS]
Q67  2N7000  [TO92-DGS]
Q68  2N7000  [TO92-DGS]
Q69  2N7000  [TO92-DGS]
Q70  2N7000  [TO92-DGS]
Q71  2N7000  [TO92-DGS]
Q72  2N7000  [TO92-DGS]
Q690  2N7000  [TO92-DGS]
Q691  2N7000  [TO92-DGS]
R31  10k  R_P2INCH  [R_P2INCH]
R32  10k  R_P2INCH  [R_P2INCH]
R33  10k  R_P2INCH  [R_P2INCH]
R34  10k  R_P2INCH  [R_P2INCH]
R35  470  R_P2INCH  [R_P2INCH]
R36  10k  R_P2INCH  [R_P2INCH]
R37  10k  R_P2INCH  [R_P2INCH]
R38  10k  R_P2INCH  [R_P2INCH]
R39  10k  R_P2INCH  [R_P2INCH]
R40  470  R_P2INCH  [R_P2INCH]
R419  10k  R_P2INCH  [R_P2INCH]
R420  10k  R_P2INCH  [R_P2INCH]

### Nets
+5V: D7.A D8.A R31.2 R32.2 R33.2 R34.2 R36.2 R37.2 R38.2 R39.2 R419.2 R420.2 ; also sheet 2,4,5,6,7,8,9,10,12,13,14,15,16,17,18,19,20,21,22,23,24,25,26,27,28,29,30,31,32,33,34,35,36,37,38,39,40,41,42,43,44
B0_4: Q59.G Q61.D R34.1 R35.1
B0_4_N: Q60.D Q61.G Q71.G R33.1
B0_5: Q67.G Q69.D R39.1 R40.1
B0_5_N: Q68.D Q69.G Q72.G R38.1
BSEL0_N: Q690.G Q691.G ; also sheet 5,9,10,12
GND: Q55.S Q57.S Q59.S Q62.S Q63.S Q65.S Q67.S Q70.S Q71.S Q72.S Q690.S Q691.S ; also sheet 2,3,4,5,6,7,8,9,10,12,13,14,15,16,17,18,19,20,21,22,23,24,25,26,27,28,29,30,31,32,33,34,35,36,37,38,39,40,41,42,43,44
N$43: Q55.D Q56.S
N$44: Q57.D Q58.S
N$45: Q59.D Q60.S
N$46: Q56.D Q58.G Q60.G R31.1
N$47: Q58.D Q62.G R32.1
N$48: D7.K(C) R35.2
N$49: Q61.S Q62.D
N$50: Q63.D Q64.S
N$51: Q65.D Q66.S
N$52: Q67.D Q68.S
N$53: Q64.D Q66.G Q68.G R36.1
N$54: Q66.D Q70.G R37.1
N$55: D8.K(C) R40.2
N$56: Q69.S Q70.D
RD_0_4: Q71.D Q691.D R419.1 ; also sheet 43
RD_0_5: Q72.D Q690.D R420.1 ; also sheet 43
WD4: Q56.G ; also sheet 3,15,19,23,27,31,35,39
WD5: Q64.G ; also sheet 3,15,19,23,27,31,35,39
WR_BYTE0: Q55.G Q57.G Q63.G Q65.G ; also sheet 5,9,10,12

### Notes on the sheet
- Q | Q
- G1 | G2 | G3 | G4 | !Q | G1 | G2 | G3 | G4 | !Q
- D | D
- E
- E
- D
- 1
- E | 3 | Q\
- 4 | !Q
- 2

## Sheet 12 of 44
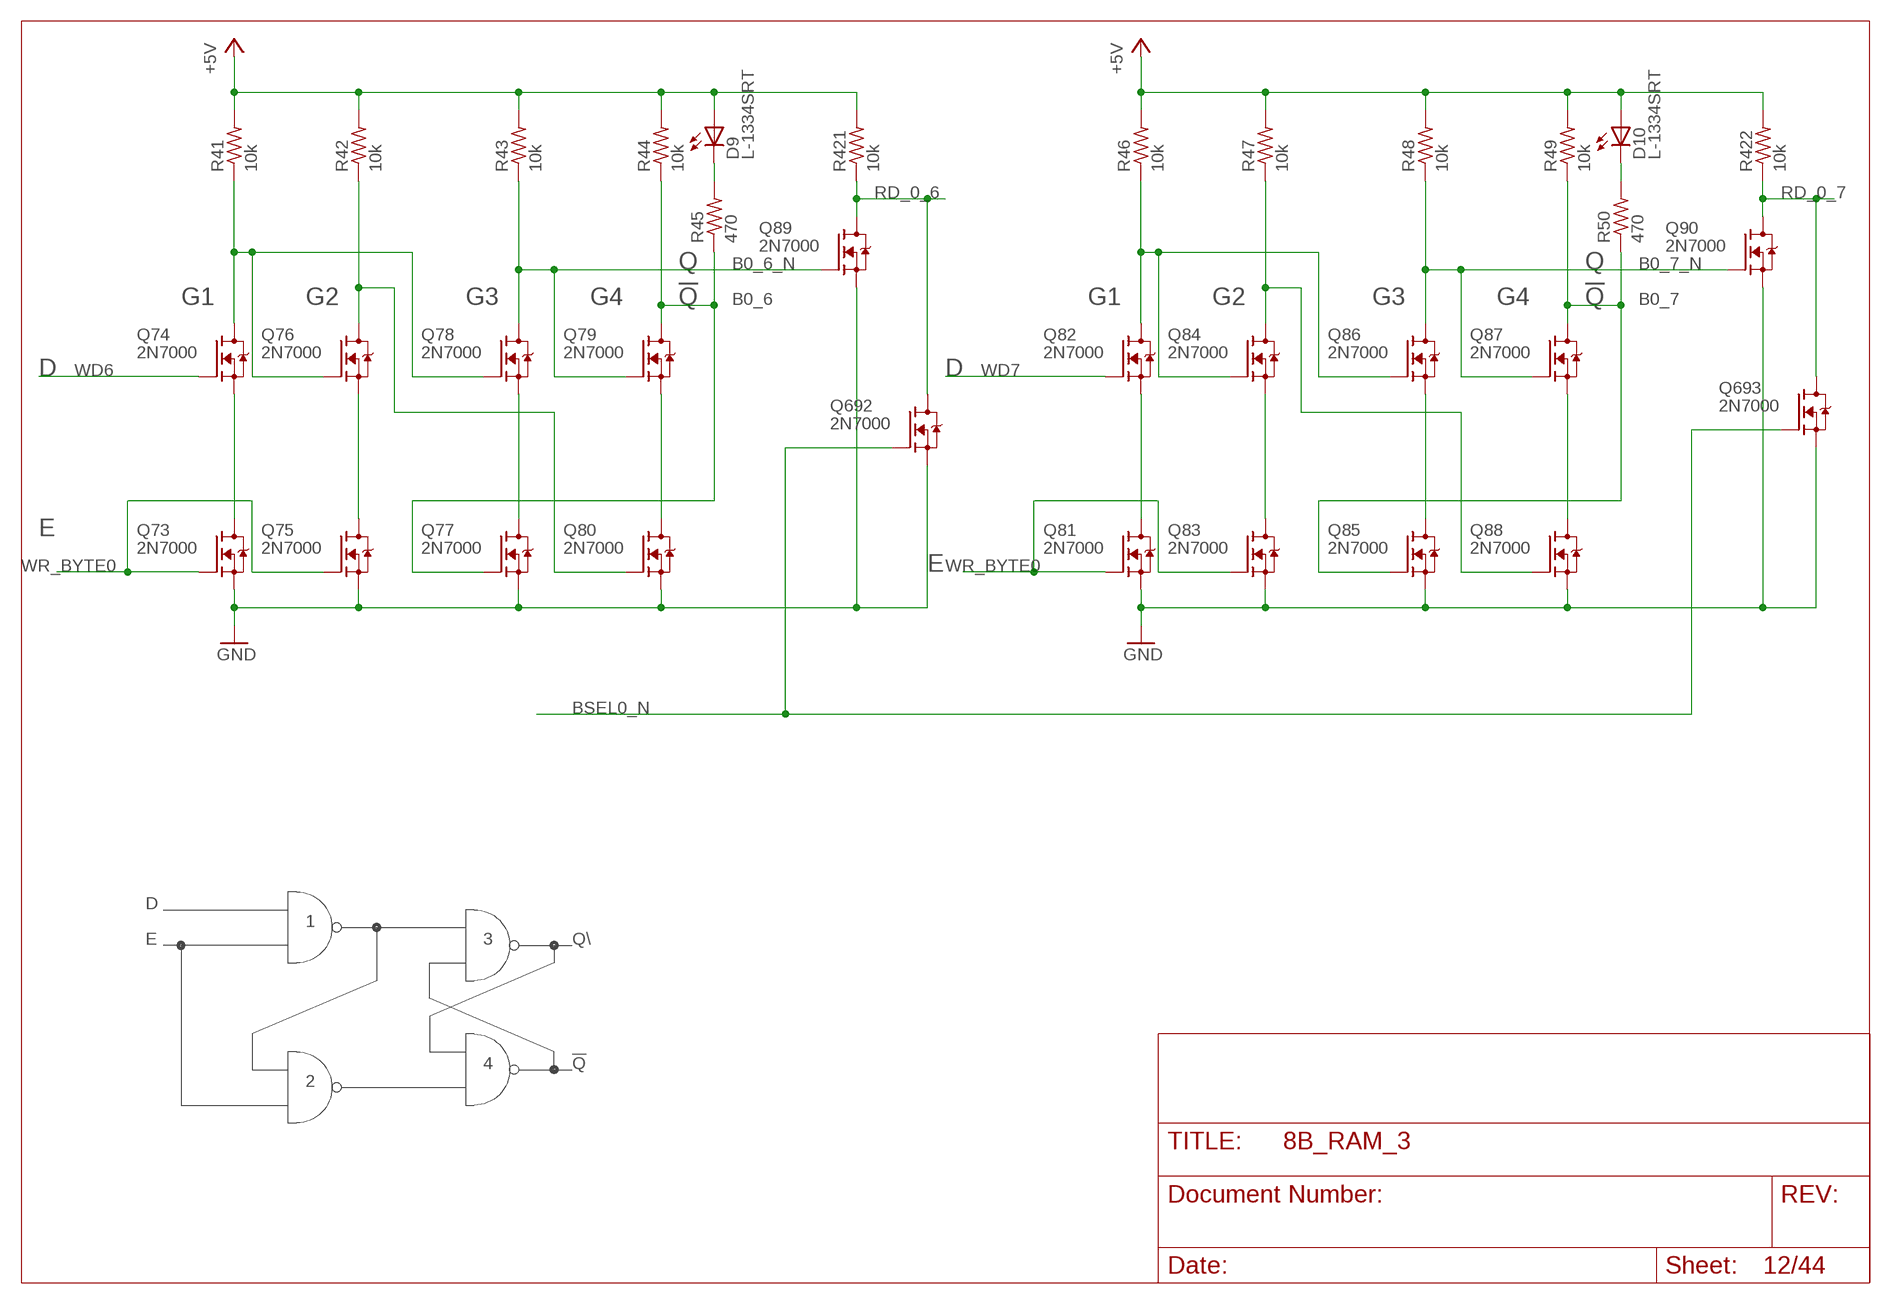
[diagram p11: schematic, sheet 12]

### Parts
D9  L-1334SRT  [LED3MM]
D10  L-1334SRT  [LED3MM]
Q73  2N7000  [TO92-DGS]
Q74  2N7000  [TO92-DGS]
Q75  2N7000  [TO92-DGS]
Q76  2N7000  [TO92-DGS]
Q77  2N7000  [TO92-DGS]
Q78  2N7000  [TO92-DGS]
Q79  2N7000  [TO92-DGS]
Q80  2N7000  [TO92-DGS]
Q81  2N7000  [TO92-DGS]
Q82  2N7000  [TO92-DGS]
Q83  2N7000  [TO92-DGS]
Q84  2N7000  [TO92-DGS]
Q85  2N7000  [TO92-DGS]
Q86  2N7000  [TO92-DGS]
Q87  2N7000  [TO92-DGS]
Q88  2N7000  [TO92-DGS]
Q89  2N7000  [TO92-DGS]
Q90  2N7000  [TO92-DGS]
Q692  2N7000  [TO92-DGS]
Q693  2N7000  [TO92-DGS]
R41  10k  R_P2INCH  [R_P2INCH]
R42  10k  R_P2INCH  [R_P2INCH]
R43  10k  R_P2INCH  [R_P2INCH]
R44  10k  R_P2INCH  [R_P2INCH]
R45  470  R_P2INCH  [R_P2INCH]
R46  10k  R_P2INCH  [R_P2INCH]
R47  10k  R_P2INCH  [R_P2INCH]
R48  10k  R_P2INCH  [R_P2INCH]
R49  10k  R_P2INCH  [R_P2INCH]
R50  470  R_P2INCH  [R_P2INCH]
R421  10k  R_P2INCH  [R_P2INCH]
R422  10k  R_P2INCH  [R_P2INCH]

### Nets
+5V: D9.A D10.A R41.2 R42.2 R43.2 R44.2 R46.2 R47.2 R48.2 R49.2 R421.2 R422.2 ; also sheet 2,4,5,6,7,8,9,10,11,13,14,15,16,17,18,19,20,21,22,23,24,25,26,27,28,29,30,31,32,33,34,35,36,37,38,39,40,41,42,43,44
B0_6: Q77.G Q79.D R44.1 R45.1
B0_6_N: Q78.D Q79.G Q89.G R43.1
B0_7: Q85.G Q87.D R49.1 R50.1
B0_7_N: Q86.D Q87.G Q90.G R48.1
BSEL0_N: Q692.G Q693.G ; also sheet 5,9,10,11
GND: Q73.S Q75.S Q77.S Q80.S Q81.S Q83.S Q85.S Q88.S Q89.S Q90.S Q692.S Q693.S ; also sheet 2,3,4,5,6,7,8,9,10,11,13,14,15,16,17,18,19,20,21,22,23,24,25,26,27,28,29,30,31,32,33,34,35,36,37,38,39,40,41,42,43,44
N$57: Q73.D Q74.S
N$58: Q75.D Q76.S
N$59: Q77.D Q78.S
N$60: Q74.D Q76.G Q78.G R41.1
N$61: Q76.D Q80.G R42.1
N$62: D9.K(C) R45.2
N$63: Q79.S Q80.D
N$64: Q81.D Q82.S
N$65: Q83.D Q84.S
N$66: Q85.D Q86.S
N$67: Q82.D Q84.G Q86.G R46.1
N$68: Q84.D Q88.G R47.1
N$69: D10.K(C) R50.2
N$70: Q87.S Q88.D
RD_0_6: Q89.D Q692.D R421.1 ; also sheet 44
RD_0_7: Q90.D Q693.D R422.1 ; also sheet 44
WD6: Q74.G ; also sheet 3,16,20,24,28,32,36,40
WD7: Q82.G ; also sheet 3,16,20,24,28,32,36,40
WR_BYTE0: Q73.G Q75.G Q81.G Q83.G ; also sheet 5,9,10,11

### Notes on the sheet
- Q | Q
- G1 | G2 | G3 | G4 | !Q | G1 | G2 | G3 | G4 | !Q
- D | D
- E
- E
- D
- 1
- E | 3 | Q\
- 4 | !Q
- 2

## Sheet 13 of 44
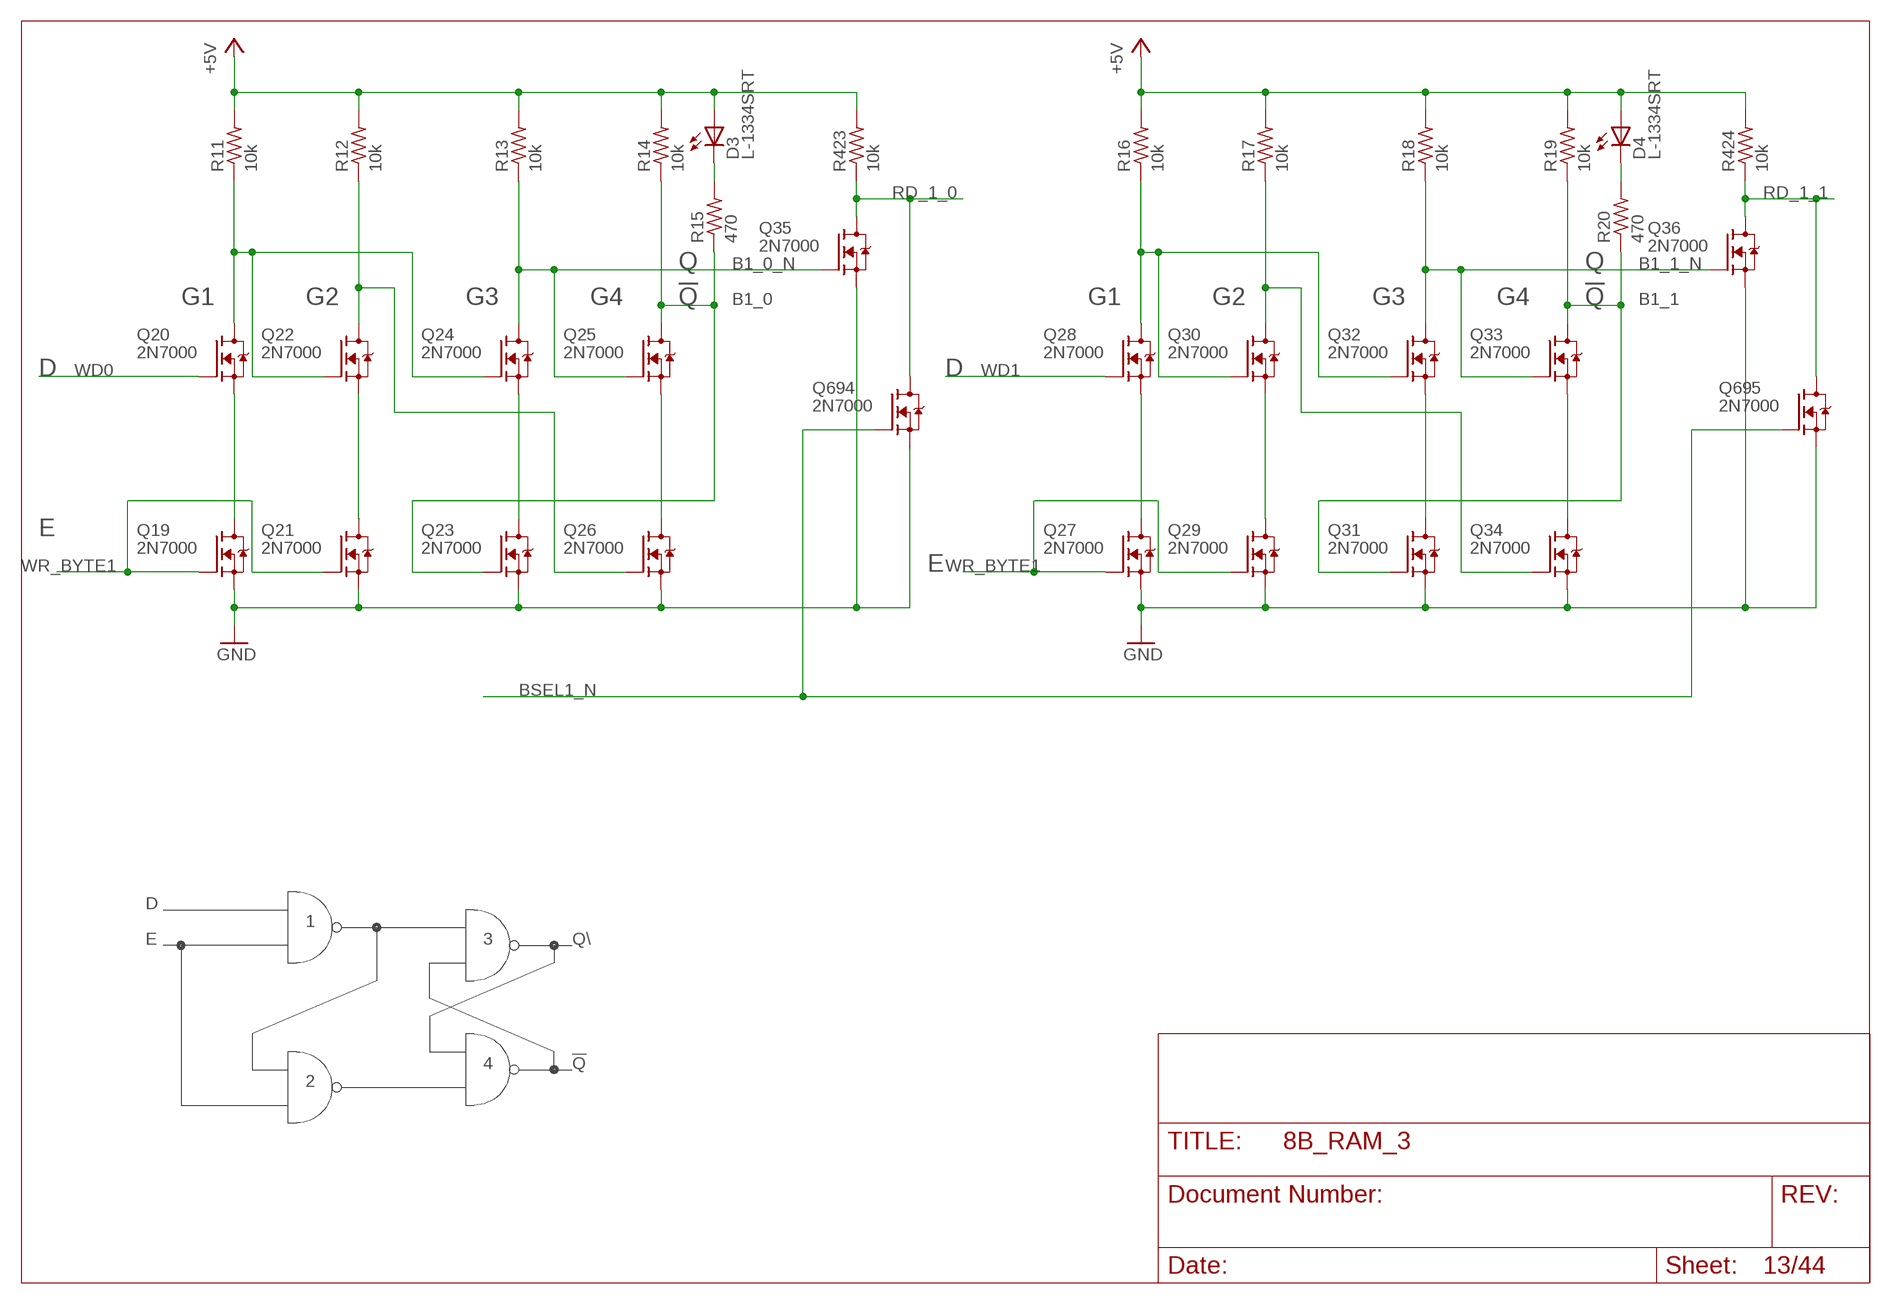
[diagram p12: schematic, sheet 13]

### Parts
D3  L-1334SRT  [LED3MM]
D4  L-1334SRT  [LED3MM]
Q19  2N7000  [TO92-DGS]
Q20  2N7000  [TO92-DGS]
Q21  2N7000  [TO92-DGS]
Q22  2N7000  [TO92-DGS]
Q23  2N7000  [TO92-DGS]
Q24  2N7000  [TO92-DGS]
Q25  2N7000  [TO92-DGS]
Q26  2N7000  [TO92-DGS]
Q27  2N7000  [TO92-DGS]
Q28  2N7000  [TO92-DGS]
Q29  2N7000  [TO92-DGS]
Q30  2N7000  [TO92-DGS]
Q31  2N7000  [TO92-DGS]
Q32  2N7000  [TO92-DGS]
Q33  2N7000  [TO92-DGS]
Q34  2N7000  [TO92-DGS]
Q35  2N7000  [TO92-DGS]
Q36  2N7000  [TO92-DGS]
Q694  2N7000  [TO92-DGS]
Q695  2N7000  [TO92-DGS]
R11  10k  R_P2INCH  [R_P2INCH]
R12  10k  R_P2INCH  [R_P2INCH]
R13  10k  R_P2INCH  [R_P2INCH]
R14  10k  R_P2INCH  [R_P2INCH]
R15  470  R_P2INCH  [R_P2INCH]
R16  10k  R_P2INCH  [R_P2INCH]
R17  10k  R_P2INCH  [R_P2INCH]
R18  10k  R_P2INCH  [R_P2INCH]
R19  10k  R_P2INCH  [R_P2INCH]
R20  470  R_P2INCH  [R_P2INCH]
R423  10k  R_P2INCH  [R_P2INCH]
R424  10k  R_P2INCH  [R_P2INCH]

### Nets
+5V: D3.A D4.A R11.2 R12.2 R13.2 R14.2 R16.2 R17.2 R18.2 R19.2 R423.2 R424.2 ; also sheet 2,4,5,6,7,8,9,10,11,12,14,15,16,17,18,19,20,21,22,23,24,25,26,27,28,29,30,31,32,33,34,35,36,37,38,39,40,41,42,43,44
B1_0: Q23.G Q25.D R14.1 R15.1
B1_0_N: Q24.D Q25.G Q35.G R13.1
B1_1: Q31.G Q33.D R19.1 R20.1
B1_1_N: Q32.D Q33.G Q36.G R18.1
BSEL1_N: Q694.G Q695.G ; also sheet 5,14,15,16
GND: Q19.S Q21.S Q23.S Q26.S Q27.S Q29.S Q31.S Q34.S Q35.S Q36.S Q694.S Q695.S ; also sheet 2,3,4,5,6,7,8,9,10,11,12,14,15,16,17,18,19,20,21,22,23,24,25,26,27,28,29,30,31,32,33,34,35,36,37,38,39,40,41,42,43,44
N$1: Q19.D Q20.S
N$2: Q21.D Q22.S
N$3: Q23.D Q24.S
N$6: Q20.D Q22.G Q24.G R11.1
N$15: Q22.D Q26.G R12.1
N$18: D3.K(C) R15.2
N$19: Q25.S Q26.D
N$21: Q27.D Q28.S
N$22: Q29.D Q30.S
N$23: Q31.D Q32.S
N$24: Q28.D Q30.G Q32.G R16.1
N$26: Q30.D Q34.G R17.1
N$27: D4.K(C) R20.2
N$28: Q33.S Q34.D
RD_1_0: Q35.D Q694.D R423.1 ; also sheet 41
RD_1_1: Q36.D Q695.D R424.1 ; also sheet 41
WD0: Q20.G ; also sheet 3,9,17,21,25,29,33,37
WD1: Q28.G ; also sheet 3,9,17,21,25,29,33,37
WR_BYTE1: Q19.G Q21.G Q27.G Q29.G ; also sheet 5,14,15,16

### Notes on the sheet
- Q | Q
- G1 | G2 | G3 | G4 | !Q | G1 | G2 | G3 | G4 | !Q
- D | D
- E
- E
- D
- 1
- E | 3 | Q\
- 4 | !Q
- 2

## Sheet 14 of 44
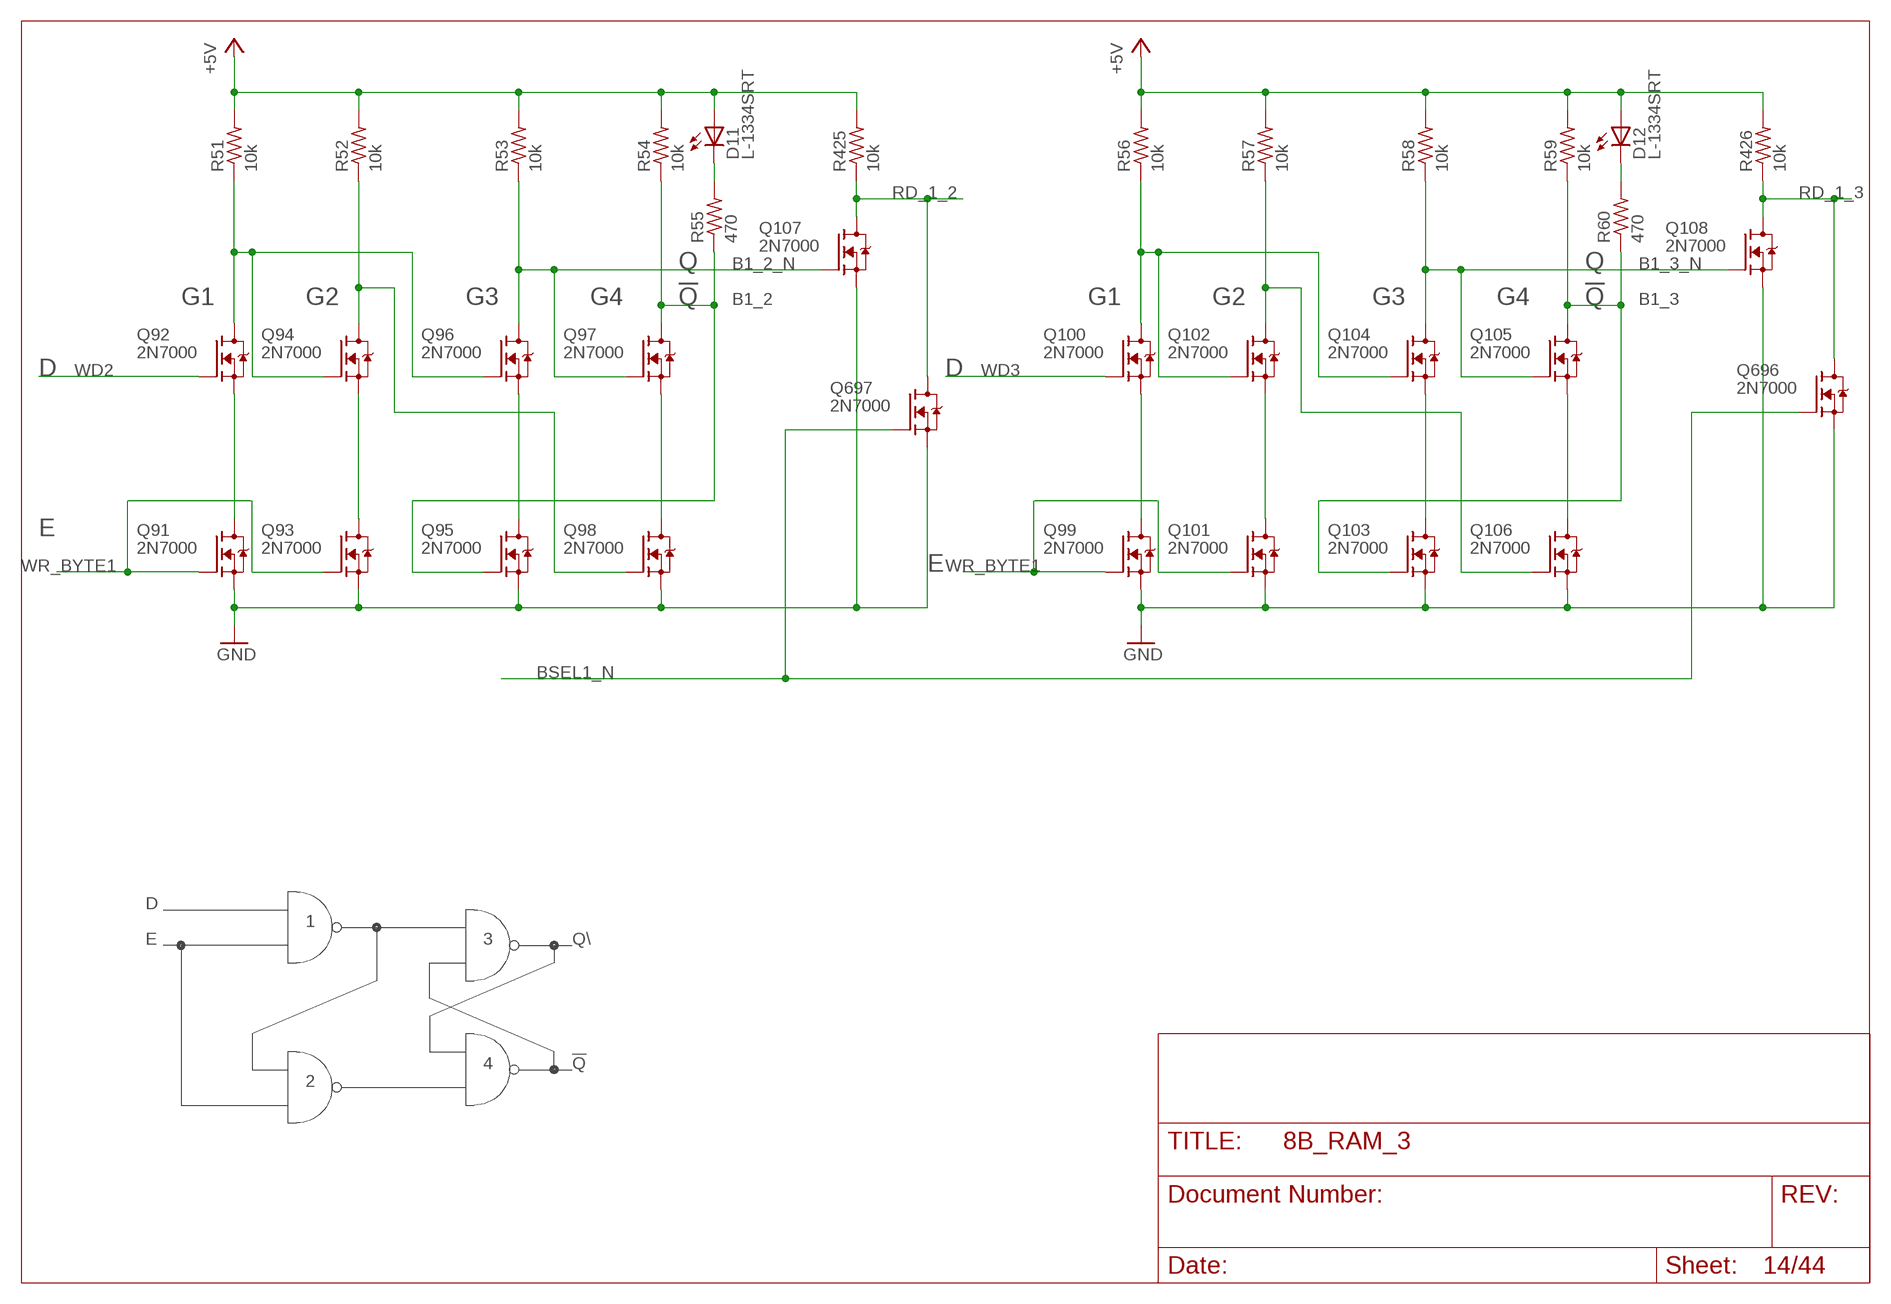
[diagram p13: schematic, sheet 14]

### Parts
D11  L-1334SRT  [LED3MM]
D12  L-1334SRT  [LED3MM]
Q91  2N7000  [TO92-DGS]
Q92  2N7000  [TO92-DGS]
Q93  2N7000  [TO92-DGS]
Q94  2N7000  [TO92-DGS]
Q95  2N7000  [TO92-DGS]
Q96  2N7000  [TO92-DGS]
Q97  2N7000  [TO92-DGS]
Q98  2N7000  [TO92-DGS]
Q99  2N7000  [TO92-DGS]
Q100  2N7000  [TO92-DGS]
Q101  2N7000  [TO92-DGS]
Q102  2N7000  [TO92-DGS]
Q103  2N7000  [TO92-DGS]
Q104  2N7000  [TO92-DGS]
Q105  2N7000  [TO92-DGS]
Q106  2N7000  [TO92-DGS]
Q107  2N7000  [TO92-DGS]
Q108  2N7000  [TO92-DGS]
Q696  2N7000  [TO92-DGS]
Q697  2N7000  [TO92-DGS]
R51  10k  R_P2INCH  [R_P2INCH]
R52  10k  R_P2INCH  [R_P2INCH]
R53  10k  R_P2INCH  [R_P2INCH]
R54  10k  R_P2INCH  [R_P2INCH]
R55  470  R_P2INCH  [R_P2INCH]
R56  10k  R_P2INCH  [R_P2INCH]
R57  10k  R_P2INCH  [R_P2INCH]
R58  10k  R_P2INCH  [R_P2INCH]
R59  10k  R_P2INCH  [R_P2INCH]
R60  470  R_P2INCH  [R_P2INCH]
R425  10k  R_P2INCH  [R_P2INCH]
R426  10k  R_P2INCH  [R_P2INCH]

### Nets
+5V: D11.A D12.A R51.2 R52.2 R53.2 R54.2 R56.2 R57.2 R58.2 R59.2 R425.2 R426.2 ; also sheet 2,4,5,6,7,8,9,10,11,12,13,15,16,17,18,19,20,21,22,23,24,25,26,27,28,29,30,31,32,33,34,35,36,37,38,39,40,41,42,43,44
B1_2: Q95.G Q97.D R54.1 R55.1
B1_2_N: Q96.D Q97.G Q107.G R53.1
B1_3: Q103.G Q105.D R59.1 R60.1
B1_3_N: Q104.D Q105.G Q108.G R58.1
BSEL1_N: Q696.G Q697.G ; also sheet 5,13,15,16
GND: Q91.S Q93.S Q95.S Q98.S Q99.S Q101.S Q103.S Q106.S Q107.S Q108.S Q696.S Q697.S ; also sheet 2,3,4,5,6,7,8,9,10,11,12,13,15,16,17,18,19,20,21,22,23,24,25,26,27,28,29,30,31,32,33,34,35,36,37,38,39,40,41,42,43,44
N$71: Q91.D Q92.S
N$72: Q93.D Q94.S
N$73: Q95.D Q96.S
N$74: Q92.D Q94.G Q96.G R51.1
N$75: Q94.D Q98.G R52.1
N$76: D11.K(C) R55.2
N$77: Q97.S Q98.D
N$78: Q99.D Q100.S
N$79: Q101.D Q102.S
N$80: Q103.D Q104.S
N$81: Q100.D Q102.G Q104.G R56.1
N$82: Q102.D Q106.G R57.1
N$83: D12.K(C) R60.2
N$84: Q105.S Q106.D
RD_1_2: Q107.D Q697.D R425.1 ; also sheet 42
RD_1_3: Q108.D Q696.D R426.1 ; also sheet 42
WD2: Q92.G ; also sheet 3,10,18,22,26,30,34,38
WD3: Q100.G ; also sheet 3,10,18,22,26,30,34,38
WR_BYTE1: Q91.G Q93.G Q99.G Q101.G ; also sheet 5,13,15,16

### Notes on the sheet
- Q | Q
- G1 | G2 | G3 | G4 | !Q | G1 | G2 | G3 | G4 | !Q
- D | D
- E
- E
- D
- 1
- E | 3 | Q\
- 4 | !Q
- 2

## Sheet 15 of 44
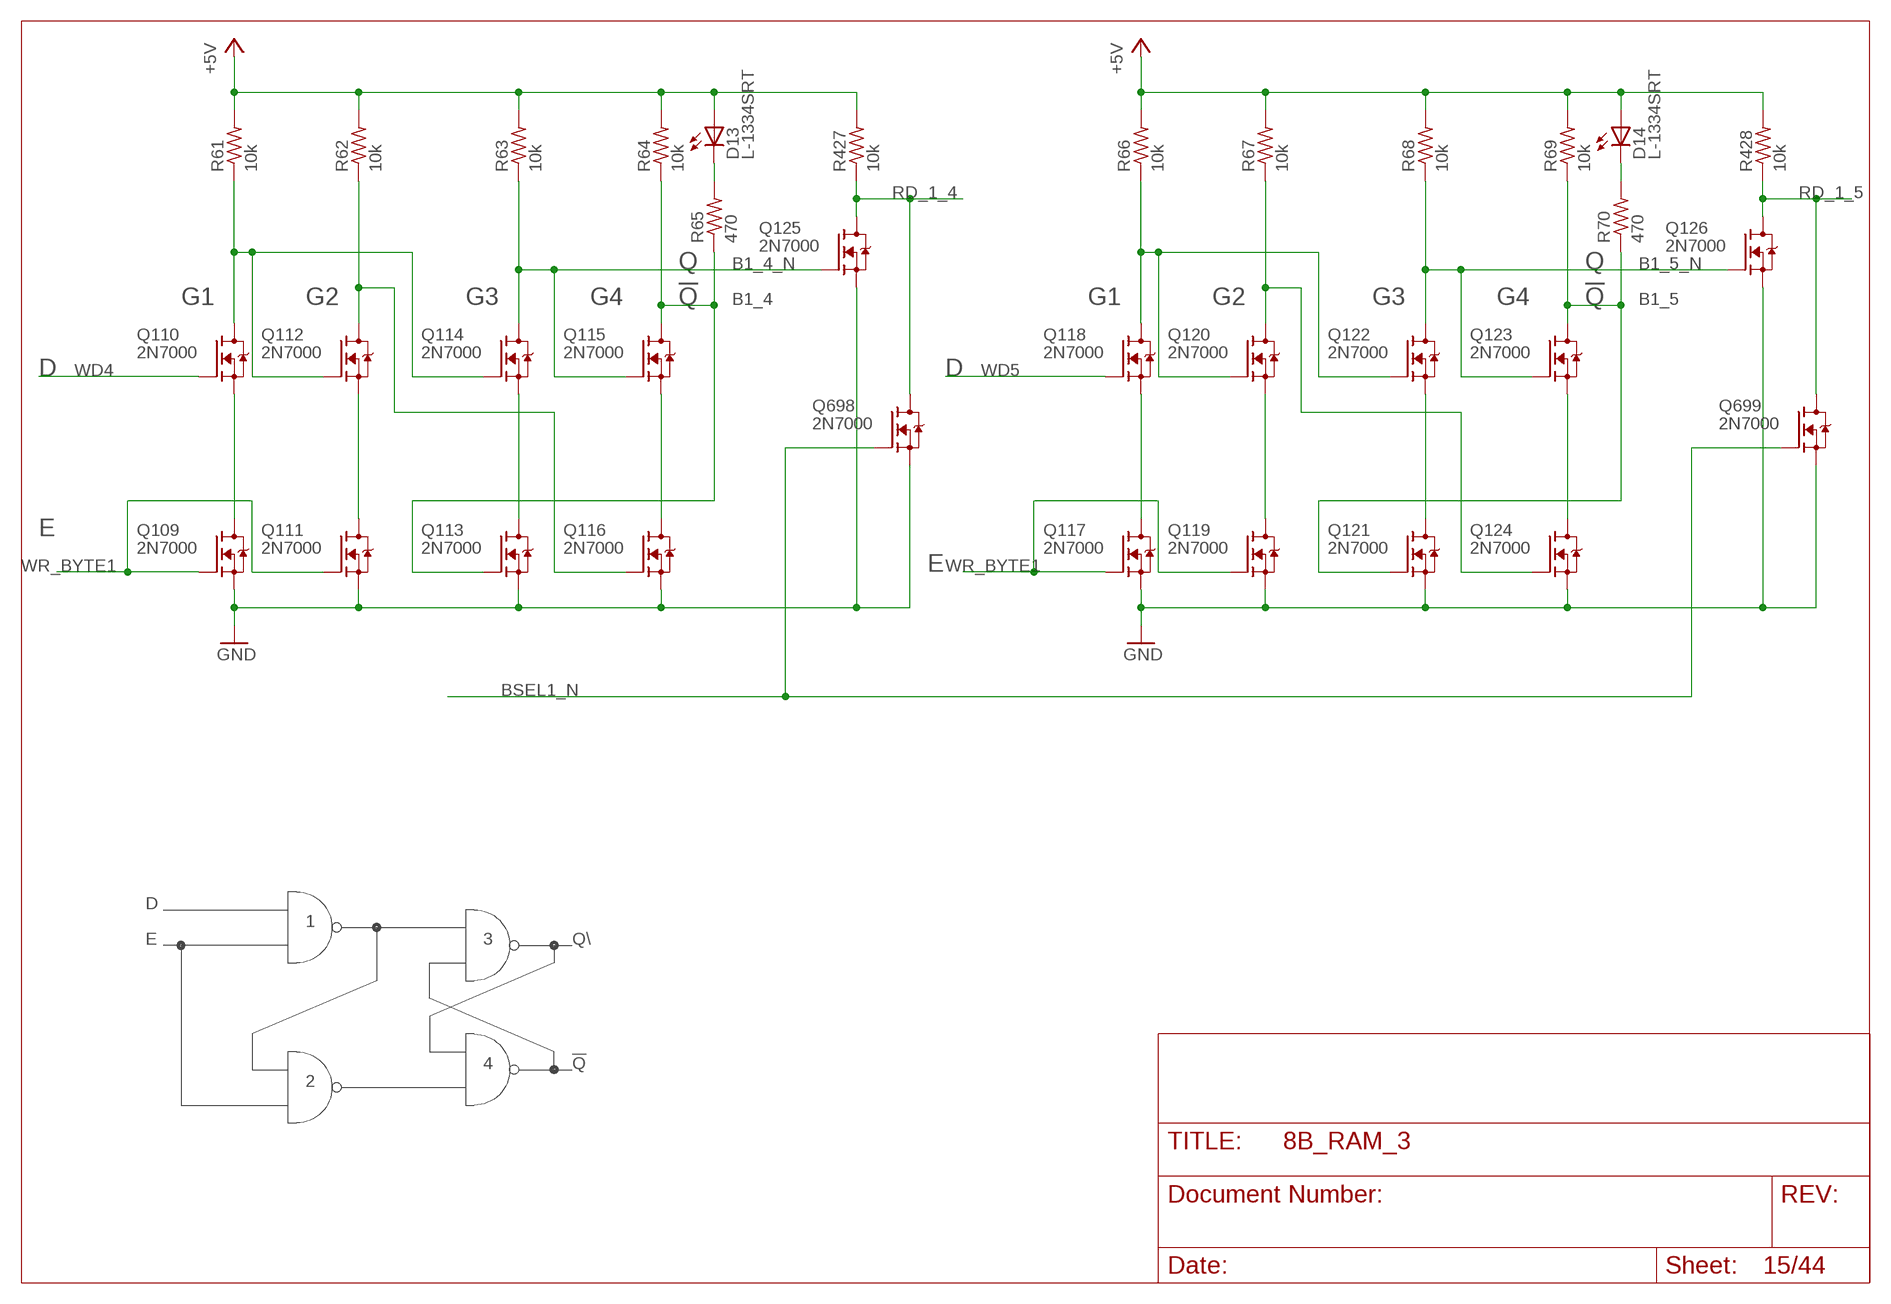
[diagram p14: schematic, sheet 15]

### Parts
D13  L-1334SRT  [LED3MM]
D14  L-1334SRT  [LED3MM]
Q109  2N7000  [TO92-DGS]
Q110  2N7000  [TO92-DGS]
Q111  2N7000  [TO92-DGS]
Q112  2N7000  [TO92-DGS]
Q113  2N7000  [TO92-DGS]
Q114  2N7000  [TO92-DGS]
Q115  2N7000  [TO92-DGS]
Q116  2N7000  [TO92-DGS]
Q117  2N7000  [TO92-DGS]
Q118  2N7000  [TO92-DGS]
Q119  2N7000  [TO92-DGS]
Q120  2N7000  [TO92-DGS]
Q121  2N7000  [TO92-DGS]
Q122  2N7000  [TO92-DGS]
Q123  2N7000  [TO92-DGS]
Q124  2N7000  [TO92-DGS]
Q125  2N7000  [TO92-DGS]
Q126  2N7000  [TO92-DGS]
Q698  2N7000  [TO92-DGS]
Q699  2N7000  [TO92-DGS]
R61  10k  R_P2INCH  [R_P2INCH]
R62  10k  R_P2INCH  [R_P2INCH]
R63  10k  R_P2INCH  [R_P2INCH]
R64  10k  R_P2INCH  [R_P2INCH]
R65  470  R_P2INCH  [R_P2INCH]
R66  10k  R_P2INCH  [R_P2INCH]
R67  10k  R_P2INCH  [R_P2INCH]
R68  10k  R_P2INCH  [R_P2INCH]
R69  10k  R_P2INCH  [R_P2INCH]
R70  470  R_P2INCH  [R_P2INCH]
R427  10k  R_P2INCH  [R_P2INCH]
R428  10k  R_P2INCH  [R_P2INCH]

### Nets
+5V: D13.A D14.A R61.2 R62.2 R63.2 R64.2 R66.2 R67.2 R68.2 R69.2 R427.2 R428.2 ; also sheet 2,4,5,6,7,8,9,10,11,12,13,14,16,17,18,19,20,21,22,23,24,25,26,27,28,29,30,31,32,33,34,35,36,37,38,39,40,41,42,43,44
B1_4: Q113.G Q115.D R64.1 R65.1
B1_4_N: Q114.D Q115.G Q125.G R63.1
B1_5: Q121.G Q123.D R69.1 R70.1
B1_5_N: Q122.D Q123.G Q126.G R68.1
BSEL1_N: Q698.G Q699.G ; also sheet 5,13,14,16
GND: Q109.S Q111.S Q113.S Q116.S Q117.S Q119.S Q121.S Q124.S Q125.S Q126.S Q698.S Q699.S ; also sheet 2,3,4,5,6,7,8,9,10,11,12,13,14,16,17,18,19,20,21,22,23,24,25,26,27,28,29,30,31,32,33,34,35,36,37,38,39,40,41,42,43,44
N$85: Q109.D Q110.S
N$86: Q111.D Q112.S
N$87: Q113.D Q114.S
N$88: Q110.D Q112.G Q114.G R61.1
N$89: Q112.D Q116.G R62.1
N$90: D13.K(C) R65.2
N$91: Q115.S Q116.D
N$92: Q117.D Q118.S
N$93: Q119.D Q120.S
N$94: Q121.D Q122.S
N$95: Q118.D Q120.G Q122.G R66.1
N$96: Q120.D Q124.G R67.1
N$97: D14.K(C) R70.2
N$98: Q123.S Q124.D
RD_1_4: Q125.D Q698.D R427.1 ; also sheet 43
RD_1_5: Q126.D Q699.D R428.1 ; also sheet 43
WD4: Q110.G ; also sheet 3,11,19,23,27,31,35,39
WD5: Q118.G ; also sheet 3,11,19,23,27,31,35,39
WR_BYTE1: Q109.G Q111.G Q117.G Q119.G ; also sheet 5,13,14,16

### Notes on the sheet
- Q | Q
- G1 | G2 | G3 | G4 | !Q | G1 | G2 | G3 | G4 | !Q
- D | D
- E
- E
- D
- 1
- E | 3 | Q\
- 4 | !Q
- 2

## Sheet 16 of 44
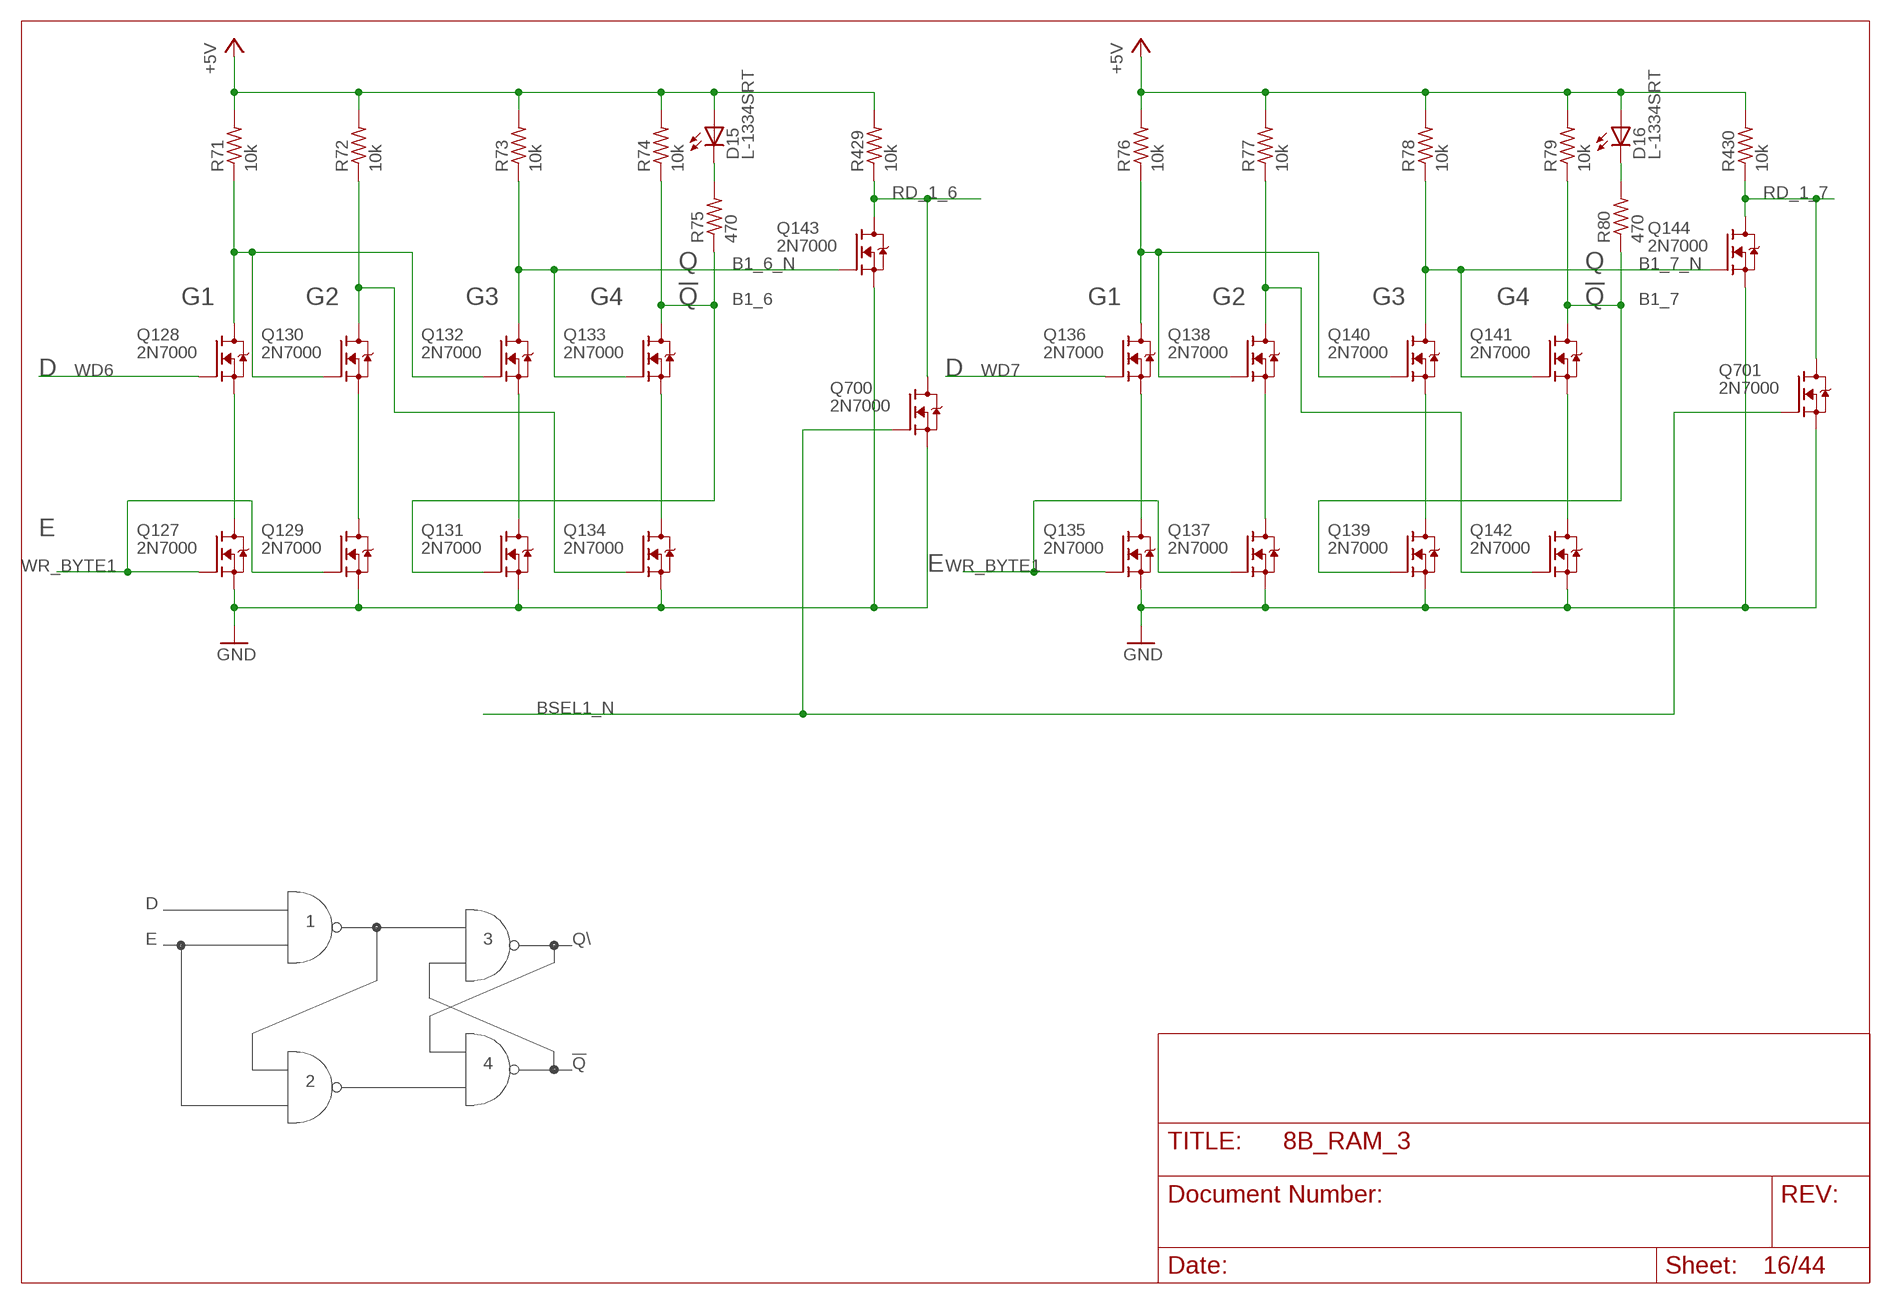
[diagram p15: schematic, sheet 16]

### Parts
D15  L-1334SRT  [LED3MM]
D16  L-1334SRT  [LED3MM]
Q127  2N7000  [TO92-DGS]
Q128  2N7000  [TO92-DGS]
Q129  2N7000  [TO92-DGS]
Q130  2N7000  [TO92-DGS]
Q131  2N7000  [TO92-DGS]
Q132  2N7000  [TO92-DGS]
Q133  2N7000  [TO92-DGS]
Q134  2N7000  [TO92-DGS]
Q135  2N7000  [TO92-DGS]
Q136  2N7000  [TO92-DGS]
Q137  2N7000  [TO92-DGS]
Q138  2N7000  [TO92-DGS]
Q139  2N7000  [TO92-DGS]
Q140  2N7000  [TO92-DGS]
Q141  2N7000  [TO92-DGS]
Q142  2N7000  [TO92-DGS]
Q143  2N7000  [TO92-DGS]
Q144  2N7000  [TO92-DGS]
Q700  2N7000  [TO92-DGS]
Q701  2N7000  [TO92-DGS]
R71  10k  R_P2INCH  [R_P2INCH]
R72  10k  R_P2INCH  [R_P2INCH]
R73  10k  R_P2INCH  [R_P2INCH]
R74  10k  R_P2INCH  [R_P2INCH]
R75  470  R_P2INCH  [R_P2INCH]
R76  10k  R_P2INCH  [R_P2INCH]
R77  10k  R_P2INCH  [R_P2INCH]
R78  10k  R_P2INCH  [R_P2INCH]
R79  10k  R_P2INCH  [R_P2INCH]
R80  470  R_P2INCH  [R_P2INCH]
R429  10k  R_P2INCH  [R_P2INCH]
R430  10k  R_P2INCH  [R_P2INCH]

### Nets
+5V: D15.A D16.A R71.2 R72.2 R73.2 R74.2 R76.2 R77.2 R78.2 R79.2 R429.2 R430.2 ; also sheet 2,4,5,6,7,8,9,10,11,12,13,14,15,17,18,19,20,21,22,23,24,25,26,27,28,29,30,31,32,33,34,35,36,37,38,39,40,41,42,43,44
B1_6: Q131.G Q133.D R74.1 R75.1
B1_6_N: Q132.D Q133.G Q143.G R73.1
B1_7: Q139.G Q141.D R79.1 R80.1
B1_7_N: Q140.D Q141.G Q144.G R78.1
BSEL1_N: Q700.G Q701.G ; also sheet 5,13,14,15
GND: Q127.S Q129.S Q131.S Q134.S Q135.S Q137.S Q139.S Q142.S Q143.S Q144.S Q700.S Q701.S ; also sheet 2,3,4,5,6,7,8,9,10,11,12,13,14,15,17,18,19,20,21,22,23,24,25,26,27,28,29,30,31,32,33,34,35,36,37,38,39,40,41,42,43,44
N$99: Q127.D Q128.S
N$100: Q129.D Q130.S
N$101: Q131.D Q132.S
N$102: Q128.D Q130.G Q132.G R71.1
N$103: Q130.D Q134.G R72.1
N$104: D15.K(C) R75.2
N$105: Q133.S Q134.D
N$106: Q135.D Q136.S
N$107: Q137.D Q138.S
N$108: Q139.D Q140.S
N$109: Q136.D Q138.G Q140.G R76.1
N$110: Q138.D Q142.G R77.1
N$111: D16.K(C) R80.2
N$112: Q141.S Q142.D
RD_1_6: Q143.D Q700.D R429.1 ; also sheet 44
RD_1_7: Q144.D Q701.D R430.1 ; also sheet 44
WD6: Q128.G ; also sheet 3,12,20,24,28,32,36,40
WD7: Q136.G ; also sheet 3,12,20,24,28,32,36,40
WR_BYTE1: Q127.G Q129.G Q135.G Q137.G ; also sheet 5,13,14,15

### Notes on the sheet
- Q | Q
- G1 | G2 | G3 | G4 | !Q | G1 | G2 | G3 | G4 | !Q
- D | D
- E
- E
- D
- 1
- E | 3 | Q\
- 4 | !Q
- 2

## Sheet 17 of 44
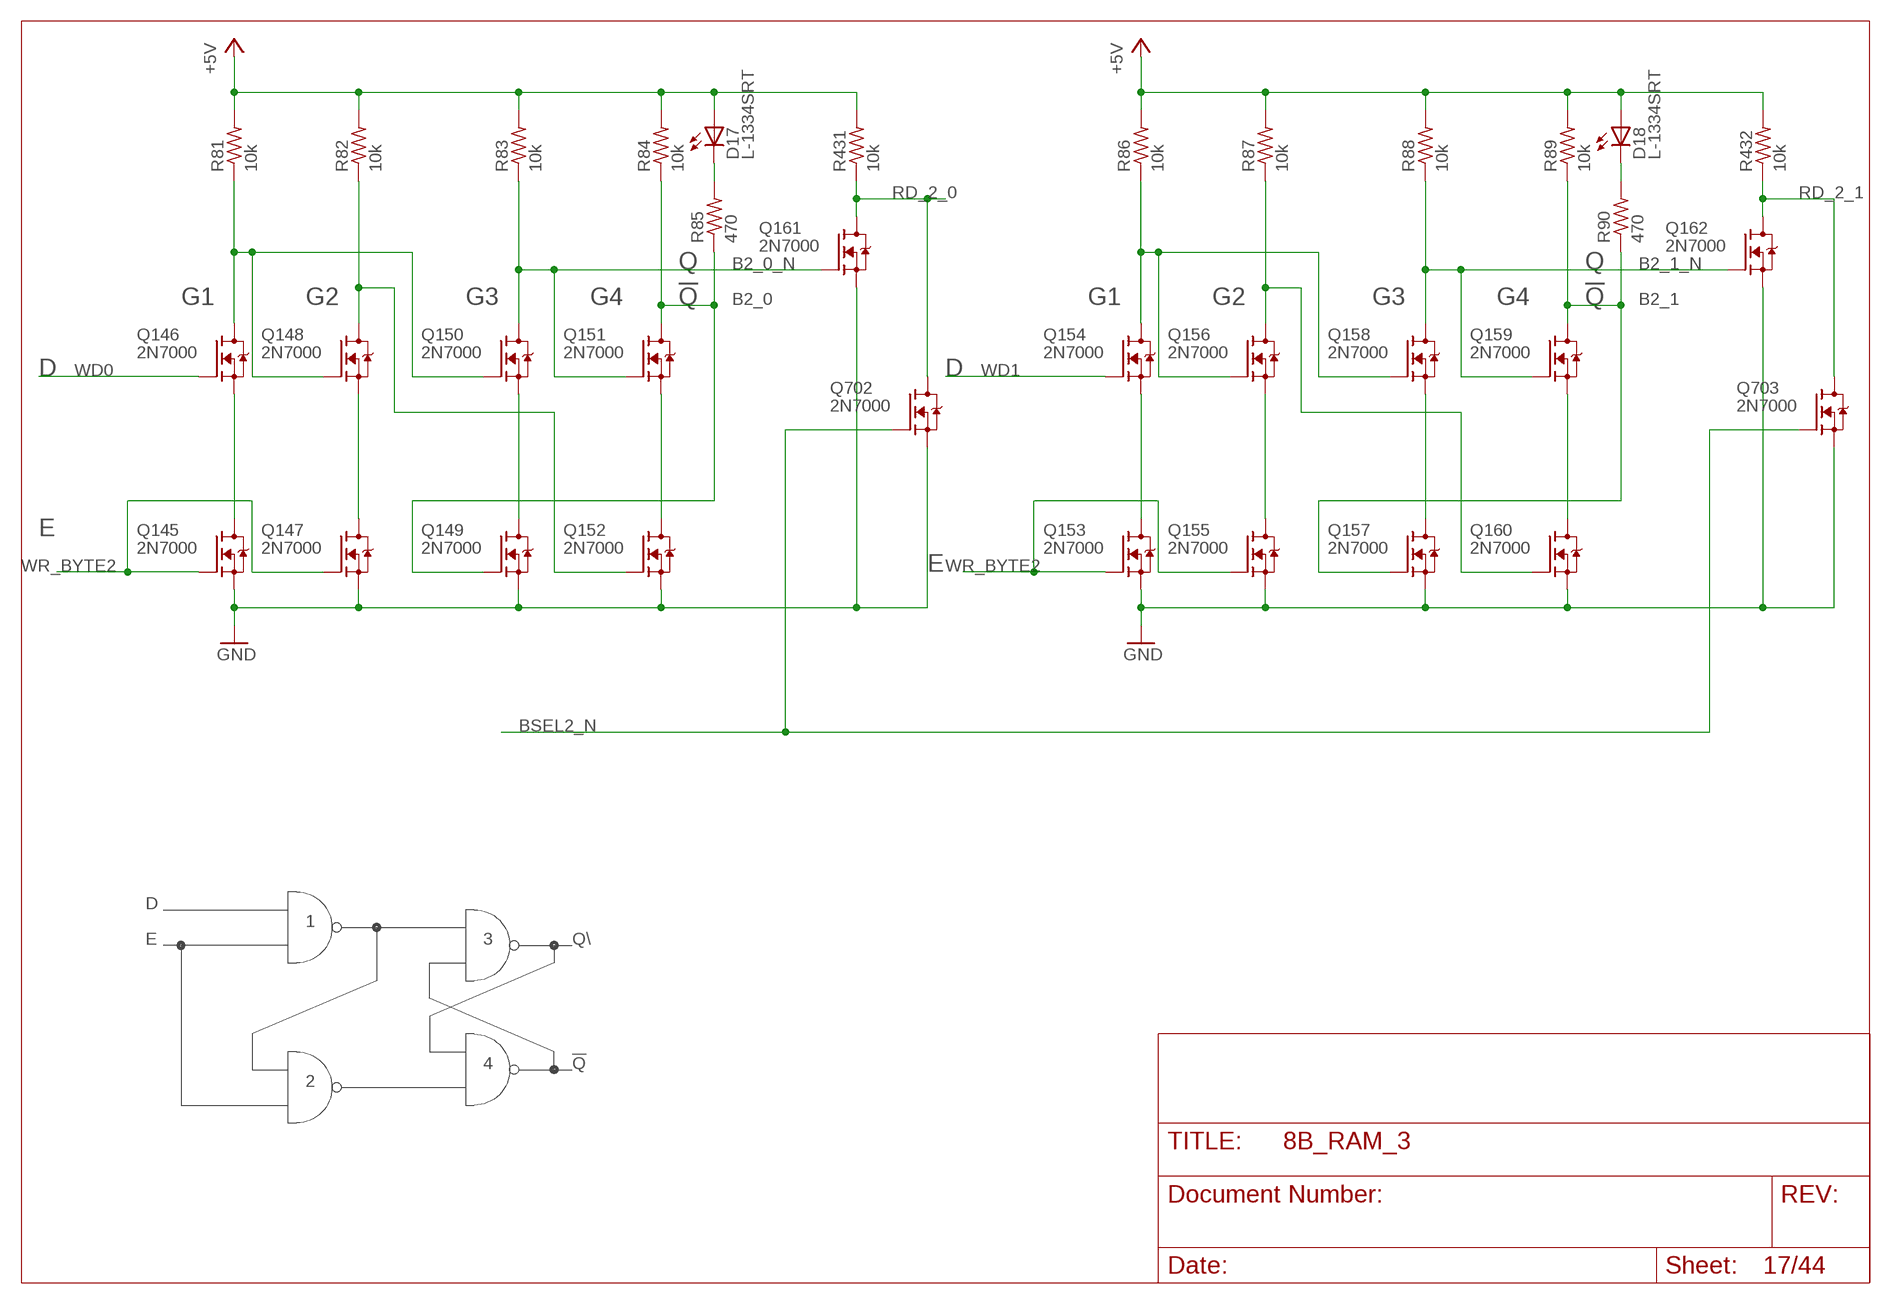
[diagram p16: schematic, sheet 17]

### Parts
D17  L-1334SRT  [LED3MM]
D18  L-1334SRT  [LED3MM]
Q145  2N7000  [TO92-DGS]
Q146  2N7000  [TO92-DGS]
Q147  2N7000  [TO92-DGS]
Q148  2N7000  [TO92-DGS]
Q149  2N7000  [TO92-DGS]
Q150  2N7000  [TO92-DGS]
Q151  2N7000  [TO92-DGS]
Q152  2N7000  [TO92-DGS]
Q153  2N7000  [TO92-DGS]
Q154  2N7000  [TO92-DGS]
Q155  2N7000  [TO92-DGS]
Q156  2N7000  [TO92-DGS]
Q157  2N7000  [TO92-DGS]
Q158  2N7000  [TO92-DGS]
Q159  2N7000  [TO92-DGS]
Q160  2N7000  [TO92-DGS]
Q161  2N7000  [TO92-DGS]
Q162  2N7000  [TO92-DGS]
Q702  2N7000  [TO92-DGS]
Q703  2N7000  [TO92-DGS]
R81  10k  R_P2INCH  [R_P2INCH]
R82  10k  R_P2INCH  [R_P2INCH]
R83  10k  R_P2INCH  [R_P2INCH]
R84  10k  R_P2INCH  [R_P2INCH]
R85  470  R_P2INCH  [R_P2INCH]
R86  10k  R_P2INCH  [R_P2INCH]
R87  10k  R_P2INCH  [R_P2INCH]
R88  10k  R_P2INCH  [R_P2INCH]
R89  10k  R_P2INCH  [R_P2INCH]
R90  470  R_P2INCH  [R_P2INCH]
R431  10k  R_P2INCH  [R_P2INCH]
R432  10k  R_P2INCH  [R_P2INCH]

### Nets
+5V: D17.A D18.A R81.2 R82.2 R83.2 R84.2 R86.2 R87.2 R88.2 R89.2 R431.2 R432.2 ; also sheet 2,4,5,6,7,8,9,10,11,12,13,14,15,16,18,19,20,21,22,23,24,25,26,27,28,29,30,31,32,33,34,35,36,37,38,39,40,41,42,43,44
B2_0: Q149.G Q151.D R84.1 R85.1
B2_0_N: Q150.D Q151.G Q161.G R83.1
B2_1: Q157.G Q159.D R89.1 R90.1
B2_1_N: Q158.D Q159.G Q162.G R88.1
BSEL2_N: Q702.G Q703.G ; also sheet 6,18,19,20
GND: Q145.S Q147.S Q149.S Q152.S Q153.S Q155.S Q157.S Q160.S Q161.S Q162.S Q702.S Q703.S ; also sheet 2,3,4,5,6,7,8,9,10,11,12,13,14,15,16,18,19,20,21,22,23,24,25,26,27,28,29,30,31,32,33,34,35,36,37,38,39,40,41,42,43,44
N$113: Q145.D Q146.S
N$114: Q147.D Q148.S
N$115: Q149.D Q150.S
N$116: Q146.D Q148.G Q150.G R81.1
N$117: Q148.D Q152.G R82.1
N$118: D17.K(C) R85.2
N$119: Q151.S Q152.D
N$120: Q153.D Q154.S
N$121: Q155.D Q156.S
N$122: Q157.D Q158.S
N$123: Q154.D Q156.G Q158.G R86.1
N$124: Q156.D Q160.G R87.1
N$125: D18.K(C) R90.2
N$126: Q159.S Q160.D
RD_2_0: Q161.D Q702.D R431.1 ; also sheet 41
RD_2_1: Q162.D Q703.D R432.1 ; also sheet 41
WD0: Q146.G ; also sheet 3,9,13,21,25,29,33,37
WD1: Q154.G ; also sheet 3,9,13,21,25,29,33,37
WR_BYTE2: Q145.G Q147.G Q153.G Q155.G ; also sheet 6,18,19,20

### Notes on the sheet
- Q | Q
- G1 | G2 | G3 | G4 | !Q | G1 | G2 | G3 | G4 | !Q
- D | D
- E
- E
- D
- 1
- E | 3 | Q\
- 4 | !Q
- 2

## Sheet 18 of 44
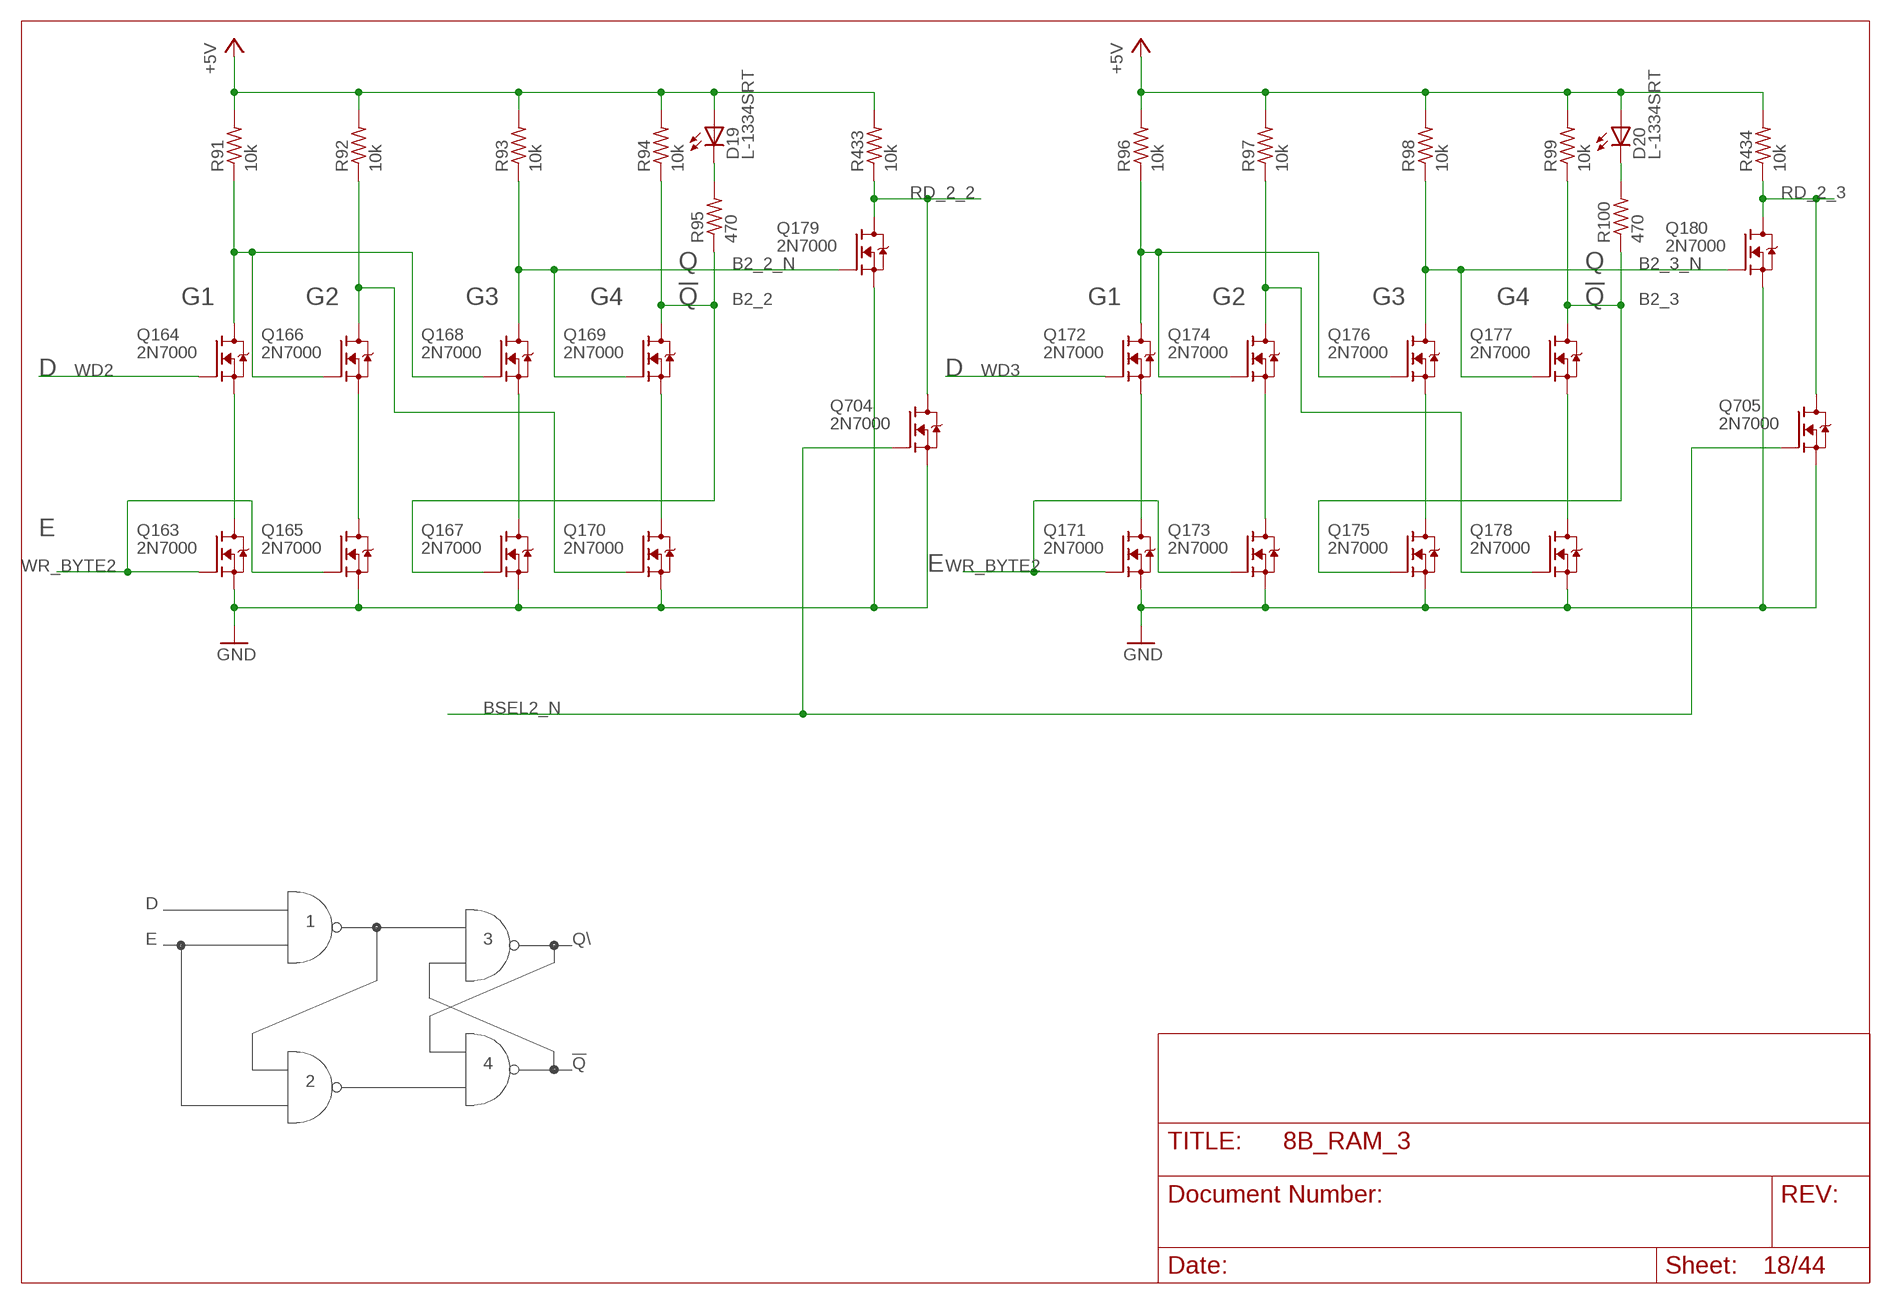
[diagram p17: schematic, sheet 18]

### Parts
D19  L-1334SRT  [LED3MM]
D20  L-1334SRT  [LED3MM]
Q163  2N7000  [TO92-DGS]
Q164  2N7000  [TO92-DGS]
Q165  2N7000  [TO92-DGS]
Q166  2N7000  [TO92-DGS]
Q167  2N7000  [TO92-DGS]
Q168  2N7000  [TO92-DGS]
Q169  2N7000  [TO92-DGS]
Q170  2N7000  [TO92-DGS]
Q171  2N7000  [TO92-DGS]
Q172  2N7000  [TO92-DGS]
Q173  2N7000  [TO92-DGS]
Q174  2N7000  [TO92-DGS]
Q175  2N7000  [TO92-DGS]
Q176  2N7000  [TO92-DGS]
Q177  2N7000  [TO92-DGS]
Q178  2N7000  [TO92-DGS]
Q179  2N7000  [TO92-DGS]
Q180  2N7000  [TO92-DGS]
Q704  2N7000  [TO92-DGS]
Q705  2N7000  [TO92-DGS]
R91  10k  R_P2INCH  [R_P2INCH]
R92  10k  R_P2INCH  [R_P2INCH]
R93  10k  R_P2INCH  [R_P2INCH]
R94  10k  R_P2INCH  [R_P2INCH]
R95  470  R_P2INCH  [R_P2INCH]
R96  10k  R_P2INCH  [R_P2INCH]
R97  10k  R_P2INCH  [R_P2INCH]
R98  10k  R_P2INCH  [R_P2INCH]
R99  10k  R_P2INCH  [R_P2INCH]
R100  470  R_P2INCH  [R_P2INCH]
R433  10k  R_P2INCH  [R_P2INCH]
R434  10k  R_P2INCH  [R_P2INCH]

### Nets
+5V: D19.A D20.A R91.2 R92.2 R93.2 R94.2 R96.2 R97.2 R98.2 R99.2 R433.2 R434.2 ; also sheet 2,4,5,6,7,8,9,10,11,12,13,14,15,16,17,19,20,21,22,23,24,25,26,27,28,29,30,31,32,33,34,35,36,37,38,39,40,41,42,43,44
B2_2: Q167.G Q169.D R94.1 R95.1
B2_2_N: Q168.D Q169.G Q179.G R93.1
B2_3: Q175.G Q177.D R99.1 R100.1
B2_3_N: Q176.D Q177.G Q180.G R98.1
BSEL2_N: Q704.G Q705.G ; also sheet 6,17,19,20
GND: Q163.S Q165.S Q167.S Q170.S Q171.S Q173.S Q175.S Q178.S Q179.S Q180.S Q704.S Q705.S ; also sheet 2,3,4,5,6,7,8,9,10,11,12,13,14,15,16,17,19,20,21,22,23,24,25,26,27,28,29,30,31,32,33,34,35,36,37,38,39,40,41,42,43,44
N$127: Q163.D Q164.S
N$128: Q165.D Q166.S
N$129: Q167.D Q168.S
N$130: Q164.D Q166.G Q168.G R91.1
N$131: Q166.D Q170.G R92.1
N$132: D19.K(C) R95.2
N$133: Q169.S Q170.D
N$134: Q171.D Q172.S
N$135: Q173.D Q174.S
N$136: Q175.D Q176.S
N$137: Q172.D Q174.G Q176.G R96.1
N$138: Q174.D Q178.G R97.1
N$139: D20.K(C) R100.2
N$140: Q177.S Q178.D
RD_2_2: Q179.D Q704.D R433.1 ; also sheet 42
RD_2_3: Q180.D Q705.D R434.1 ; also sheet 42
WD2: Q164.G ; also sheet 3,10,14,22,26,30,34,38
WD3: Q172.G ; also sheet 3,10,14,22,26,30,34,38
WR_BYTE2: Q163.G Q165.G Q171.G Q173.G ; also sheet 6,17,19,20

### Notes on the sheet
- Q | Q
- G1 | G2 | G3 | G4 | !Q | G1 | G2 | G3 | G4 | !Q
- D | D
- E
- E
- D
- 1
- E | 3 | Q\
- 4 | !Q
- 2

## Sheet 19 of 44
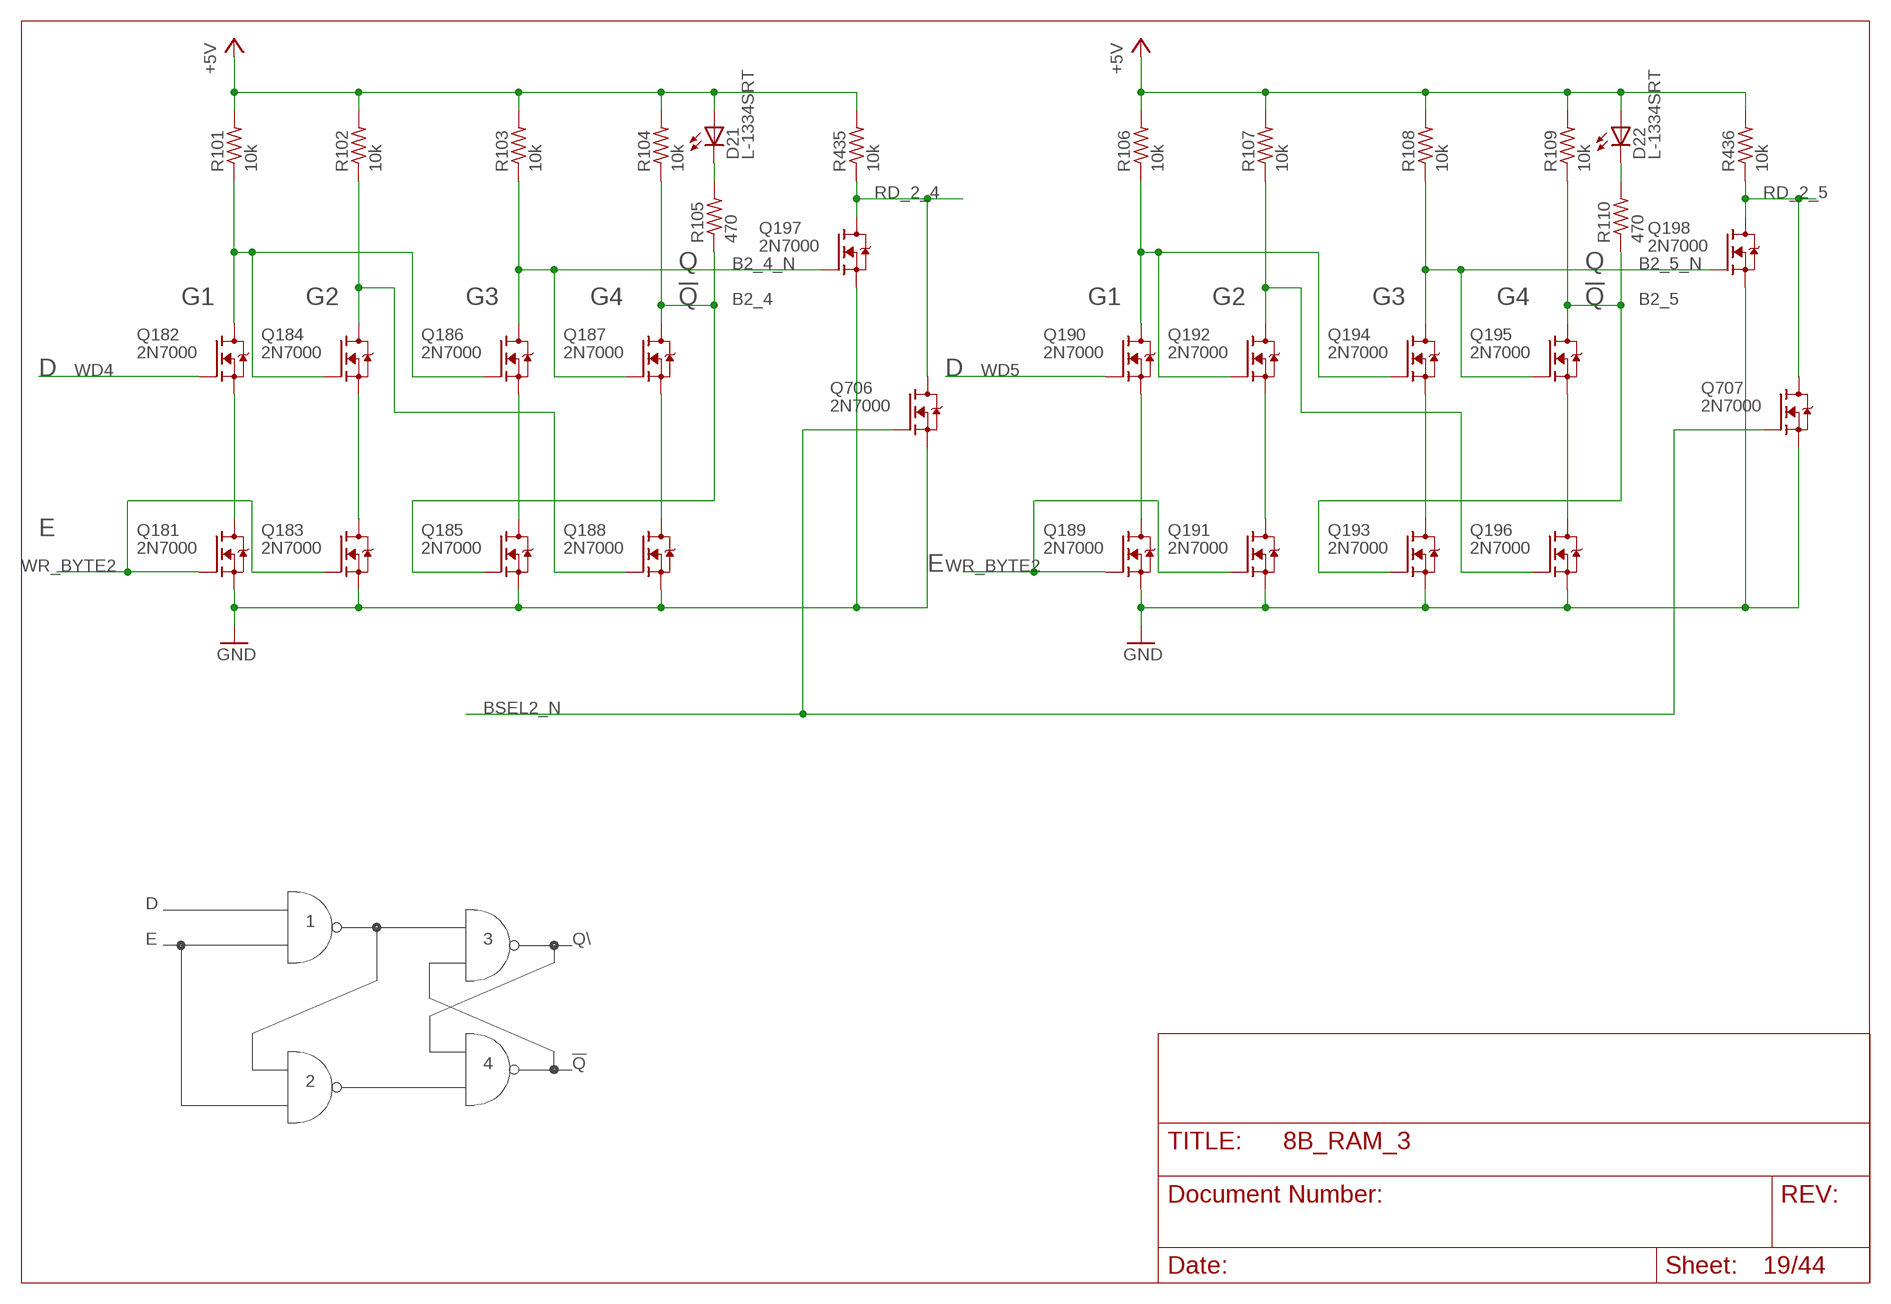
[diagram p18: schematic, sheet 19]

### Parts
D21  L-1334SRT  [LED3MM]
D22  L-1334SRT  [LED3MM]
Q181  2N7000  [TO92-DGS]
Q182  2N7000  [TO92-DGS]
Q183  2N7000  [TO92-DGS]
Q184  2N7000  [TO92-DGS]
Q185  2N7000  [TO92-DGS]
Q186  2N7000  [TO92-DGS]
Q187  2N7000  [TO92-DGS]
Q188  2N7000  [TO92-DGS]
Q189  2N7000  [TO92-DGS]
Q190  2N7000  [TO92-DGS]
Q191  2N7000  [TO92-DGS]
Q192  2N7000  [TO92-DGS]
Q193  2N7000  [TO92-DGS]
Q194  2N7000  [TO92-DGS]
Q195  2N7000  [TO92-DGS]
Q196  2N7000  [TO92-DGS]
Q197  2N7000  [TO92-DGS]
Q198  2N7000  [TO92-DGS]
Q706  2N7000  [TO92-DGS]
Q707  2N7000  [TO92-DGS]
R101  10k  R_P2INCH  [R_P2INCH]
R102  10k  R_P2INCH  [R_P2INCH]
R103  10k  R_P2INCH  [R_P2INCH]
R104  10k  R_P2INCH  [R_P2INCH]
R105  470  R_P2INCH  [R_P2INCH]
R106  10k  R_P2INCH  [R_P2INCH]
R107  10k  R_P2INCH  [R_P2INCH]
R108  10k  R_P2INCH  [R_P2INCH]
R109  10k  R_P2INCH  [R_P2INCH]
R110  470  R_P2INCH  [R_P2INCH]
R435  10k  R_P2INCH  [R_P2INCH]
R436  10k  R_P2INCH  [R_P2INCH]

### Nets
+5V: D21.A D22.A R101.2 R102.2 R103.2 R104.2 R106.2 R107.2 R108.2 R109.2 R435.2 R436.2 ; also sheet 2,4,5,6,7,8,9,10,11,12,13,14,15,16,17,18,20,21,22,23,24,25,26,27,28,29,30,31,32,33,34,35,36,37,38,39,40,41,42,43,44
B2_4: Q185.G Q187.D R104.1 R105.1
B2_4_N: Q186.D Q187.G Q197.G R103.1
B2_5: Q193.G Q195.D R109.1 R110.1
B2_5_N: Q194.D Q195.G Q198.G R108.1
BSEL2_N: Q706.G Q707.G ; also sheet 6,17,18,20
GND: Q181.S Q183.S Q185.S Q188.S Q189.S Q191.S Q193.S Q196.S Q197.S Q198.S Q706.S Q707.S ; also sheet 2,3,4,5,6,7,8,9,10,11,12,13,14,15,16,17,18,20,21,22,23,24,25,26,27,28,29,30,31,32,33,34,35,36,37,38,39,40,41,42,43,44
N$141: Q181.D Q182.S
N$142: Q183.D Q184.S
N$143: Q185.D Q186.S
N$144: Q182.D Q184.G Q186.G R101.1
N$145: Q184.D Q188.G R102.1
N$146: D21.K(C) R105.2
N$147: Q187.S Q188.D
N$148: Q189.D Q190.S
N$149: Q191.D Q192.S
N$150: Q193.D Q194.S
N$151: Q190.D Q192.G Q194.G R106.1
N$152: Q192.D Q196.G R107.1
N$153: D22.K(C) R110.2
N$154: Q195.S Q196.D
RD_2_4: Q197.D Q706.D R435.1 ; also sheet 43
RD_2_5: Q198.D Q707.D R436.1 ; also sheet 43
WD4: Q182.G ; also sheet 3,11,15,23,27,31,35,39
WD5: Q190.G ; also sheet 3,11,15,23,27,31,35,39
WR_BYTE2: Q181.G Q183.G Q189.G Q191.G ; also sheet 6,17,18,20

### Notes on the sheet
- Q | Q
- G1 | G2 | G3 | G4 | !Q | G1 | G2 | G3 | G4 | !Q
- D | D
- E
- E
- D
- 1
- E | 3 | Q\
- 4 | !Q
- 2

## Sheet 20 of 44
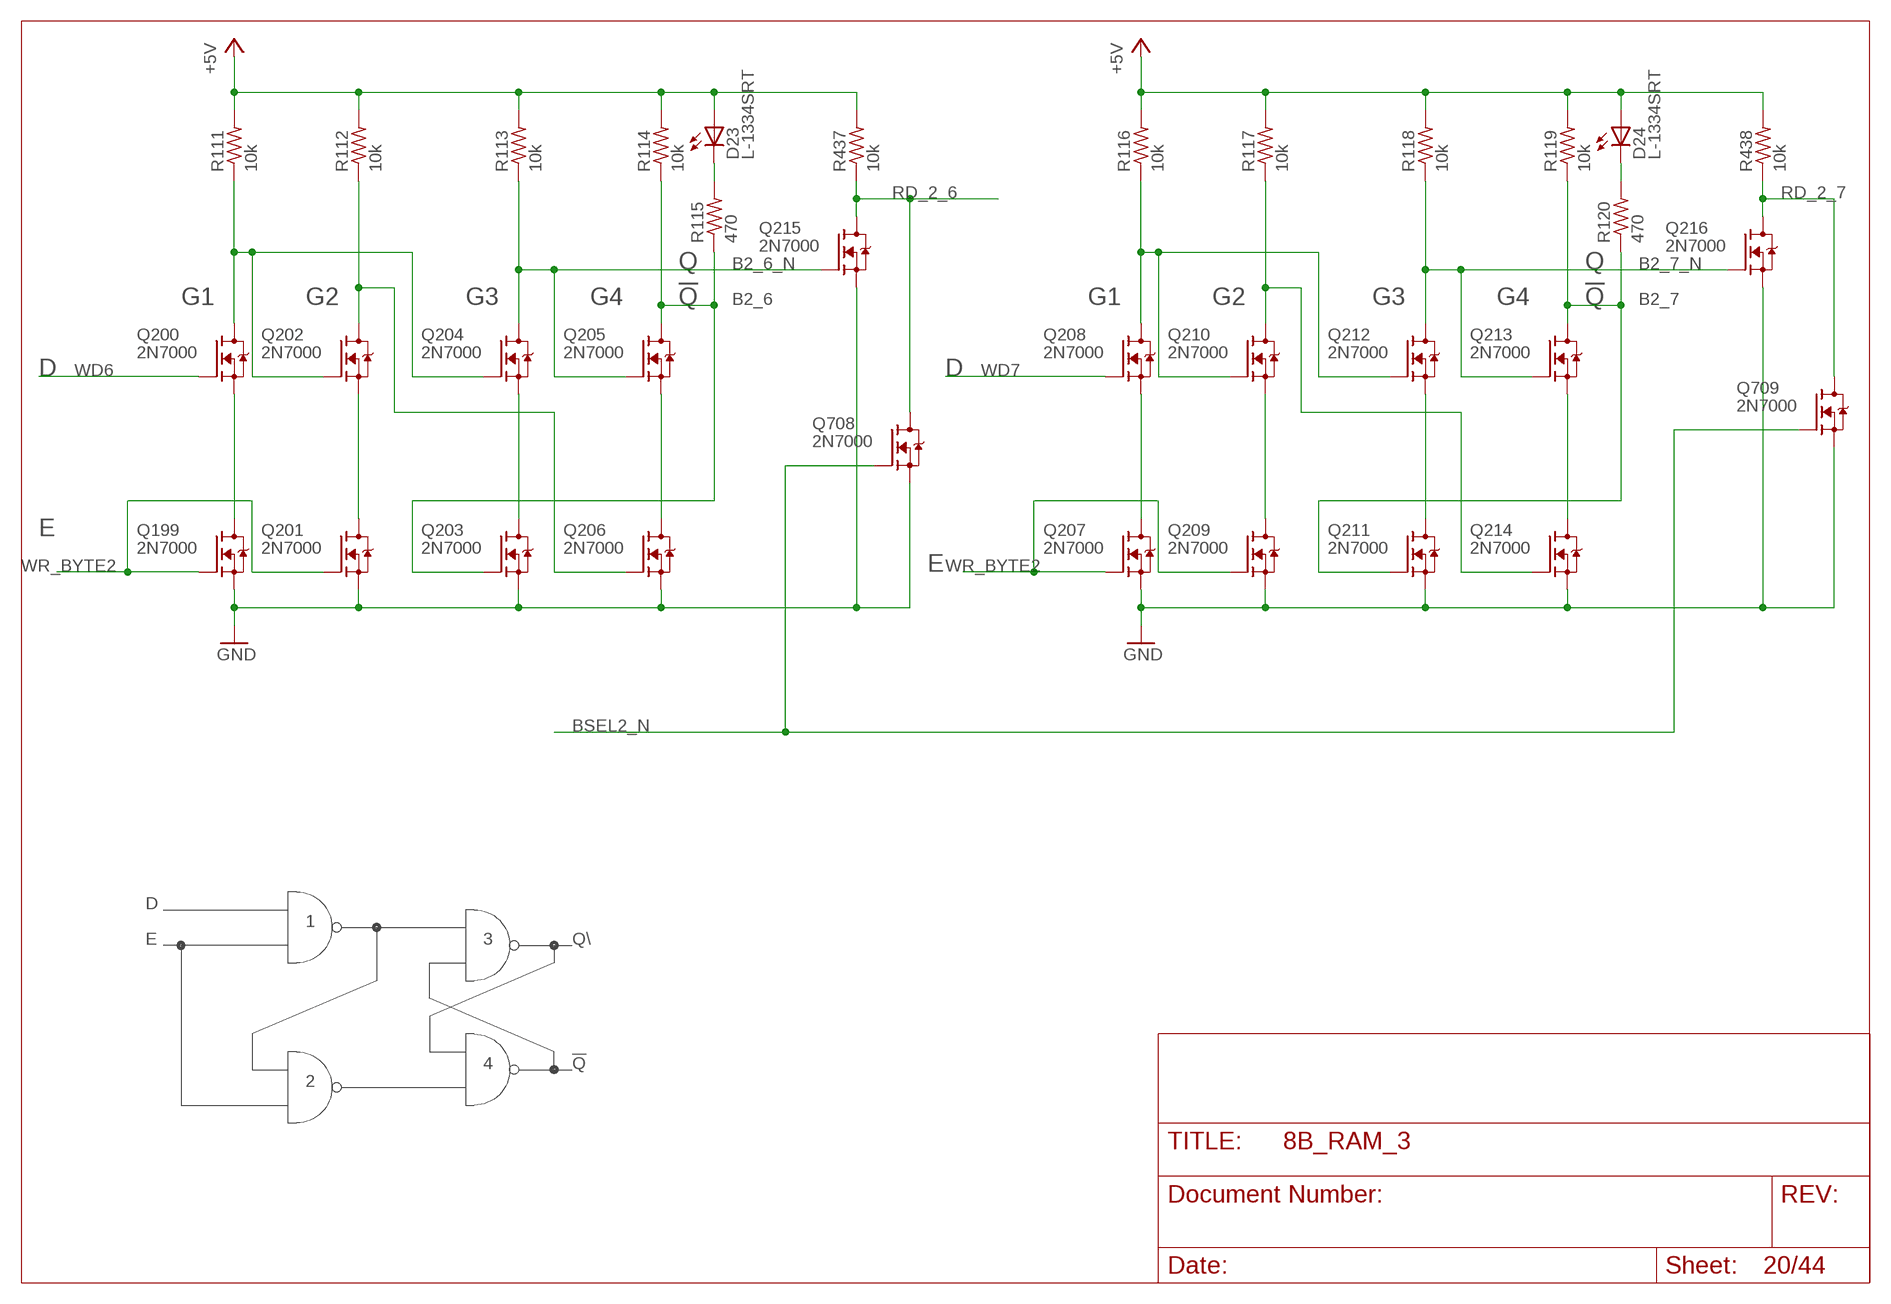
[diagram p19: schematic, sheet 20]

### Parts
D23  L-1334SRT  [LED3MM]
D24  L-1334SRT  [LED3MM]
Q199  2N7000  [TO92-DGS]
Q200  2N7000  [TO92-DGS]
Q201  2N7000  [TO92-DGS]
Q202  2N7000  [TO92-DGS]
Q203  2N7000  [TO92-DGS]
Q204  2N7000  [TO92-DGS]
Q205  2N7000  [TO92-DGS]
Q206  2N7000  [TO92-DGS]
Q207  2N7000  [TO92-DGS]
Q208  2N7000  [TO92-DGS]
Q209  2N7000  [TO92-DGS]
Q210  2N7000  [TO92-DGS]
Q211  2N7000  [TO92-DGS]
Q212  2N7000  [TO92-DGS]
Q213  2N7000  [TO92-DGS]
Q214  2N7000  [TO92-DGS]
Q215  2N7000  [TO92-DGS]
Q216  2N7000  [TO92-DGS]
Q708  2N7000  [TO92-DGS]
Q709  2N7000  [TO92-DGS]
R111  10k  R_P2INCH  [R_P2INCH]
R112  10k  R_P2INCH  [R_P2INCH]
R113  10k  R_P2INCH  [R_P2INCH]
R114  10k  R_P2INCH  [R_P2INCH]
R115  470  R_P2INCH  [R_P2INCH]
R116  10k  R_P2INCH  [R_P2INCH]
R117  10k  R_P2INCH  [R_P2INCH]
R118  10k  R_P2INCH  [R_P2INCH]
R119  10k  R_P2INCH  [R_P2INCH]
R120  470  R_P2INCH  [R_P2INCH]
R437  10k  R_P2INCH  [R_P2INCH]
R438  10k  R_P2INCH  [R_P2INCH]

### Nets
+5V: D23.A D24.A R111.2 R112.2 R113.2 R114.2 R116.2 R117.2 R118.2 R119.2 R437.2 R438.2 ; also sheet 2,4,5,6,7,8,9,10,11,12,13,14,15,16,17,18,19,21,22,23,24,25,26,27,28,29,30,31,32,33,34,35,36,37,38,39,40,41,42,43,44
B2_6: Q203.G Q205.D R114.1 R115.1
B2_6_N: Q204.D Q205.G Q215.G R113.1
B2_7: Q211.G Q213.D R119.1 R120.1
B2_7_N: Q212.D Q213.G Q216.G R118.1
BSEL2_N: Q708.G Q709.G ; also sheet 6,17,18,19
GND: Q199.S Q201.S Q203.S Q206.S Q207.S Q209.S Q211.S Q214.S Q215.S Q216.S Q708.S Q709.S ; also sheet 2,3,4,5,6,7,8,9,10,11,12,13,14,15,16,17,18,19,21,22,23,24,25,26,27,28,29,30,31,32,33,34,35,36,37,38,39,40,41,42,43,44
N$155: Q199.D Q200.S
N$156: Q201.D Q202.S
N$157: Q203.D Q204.S
N$158: Q200.D Q202.G Q204.G R111.1
N$159: Q202.D Q206.G R112.1
N$160: D23.K(C) R115.2
N$161: Q205.S Q206.D
N$162: Q207.D Q208.S
N$163: Q209.D Q210.S
N$164: Q211.D Q212.S
N$165: Q208.D Q210.G Q212.G R116.1
N$166: Q210.D Q214.G R117.1
N$167: D24.K(C) R120.2
N$168: Q213.S Q214.D
RD_2_6: Q215.D Q708.D R437.1 ; also sheet 44
RD_2_7: Q216.D Q709.D R438.1 ; also sheet 44
WD6: Q200.G ; also sheet 3,12,16,24,28,32,36,40
WD7: Q208.G ; also sheet 3,12,16,24,28,32,36,40
WR_BYTE2: Q199.G Q201.G Q207.G Q209.G ; also sheet 6,17,18,19

### Notes on the sheet
- Q | Q
- G1 | G2 | G3 | G4 | !Q | G1 | G2 | G3 | G4 | !Q
- D | D
- E
- E
- D
- 1
- E | 3 | Q\
- 4 | !Q
- 2

## Sheet 21 of 44
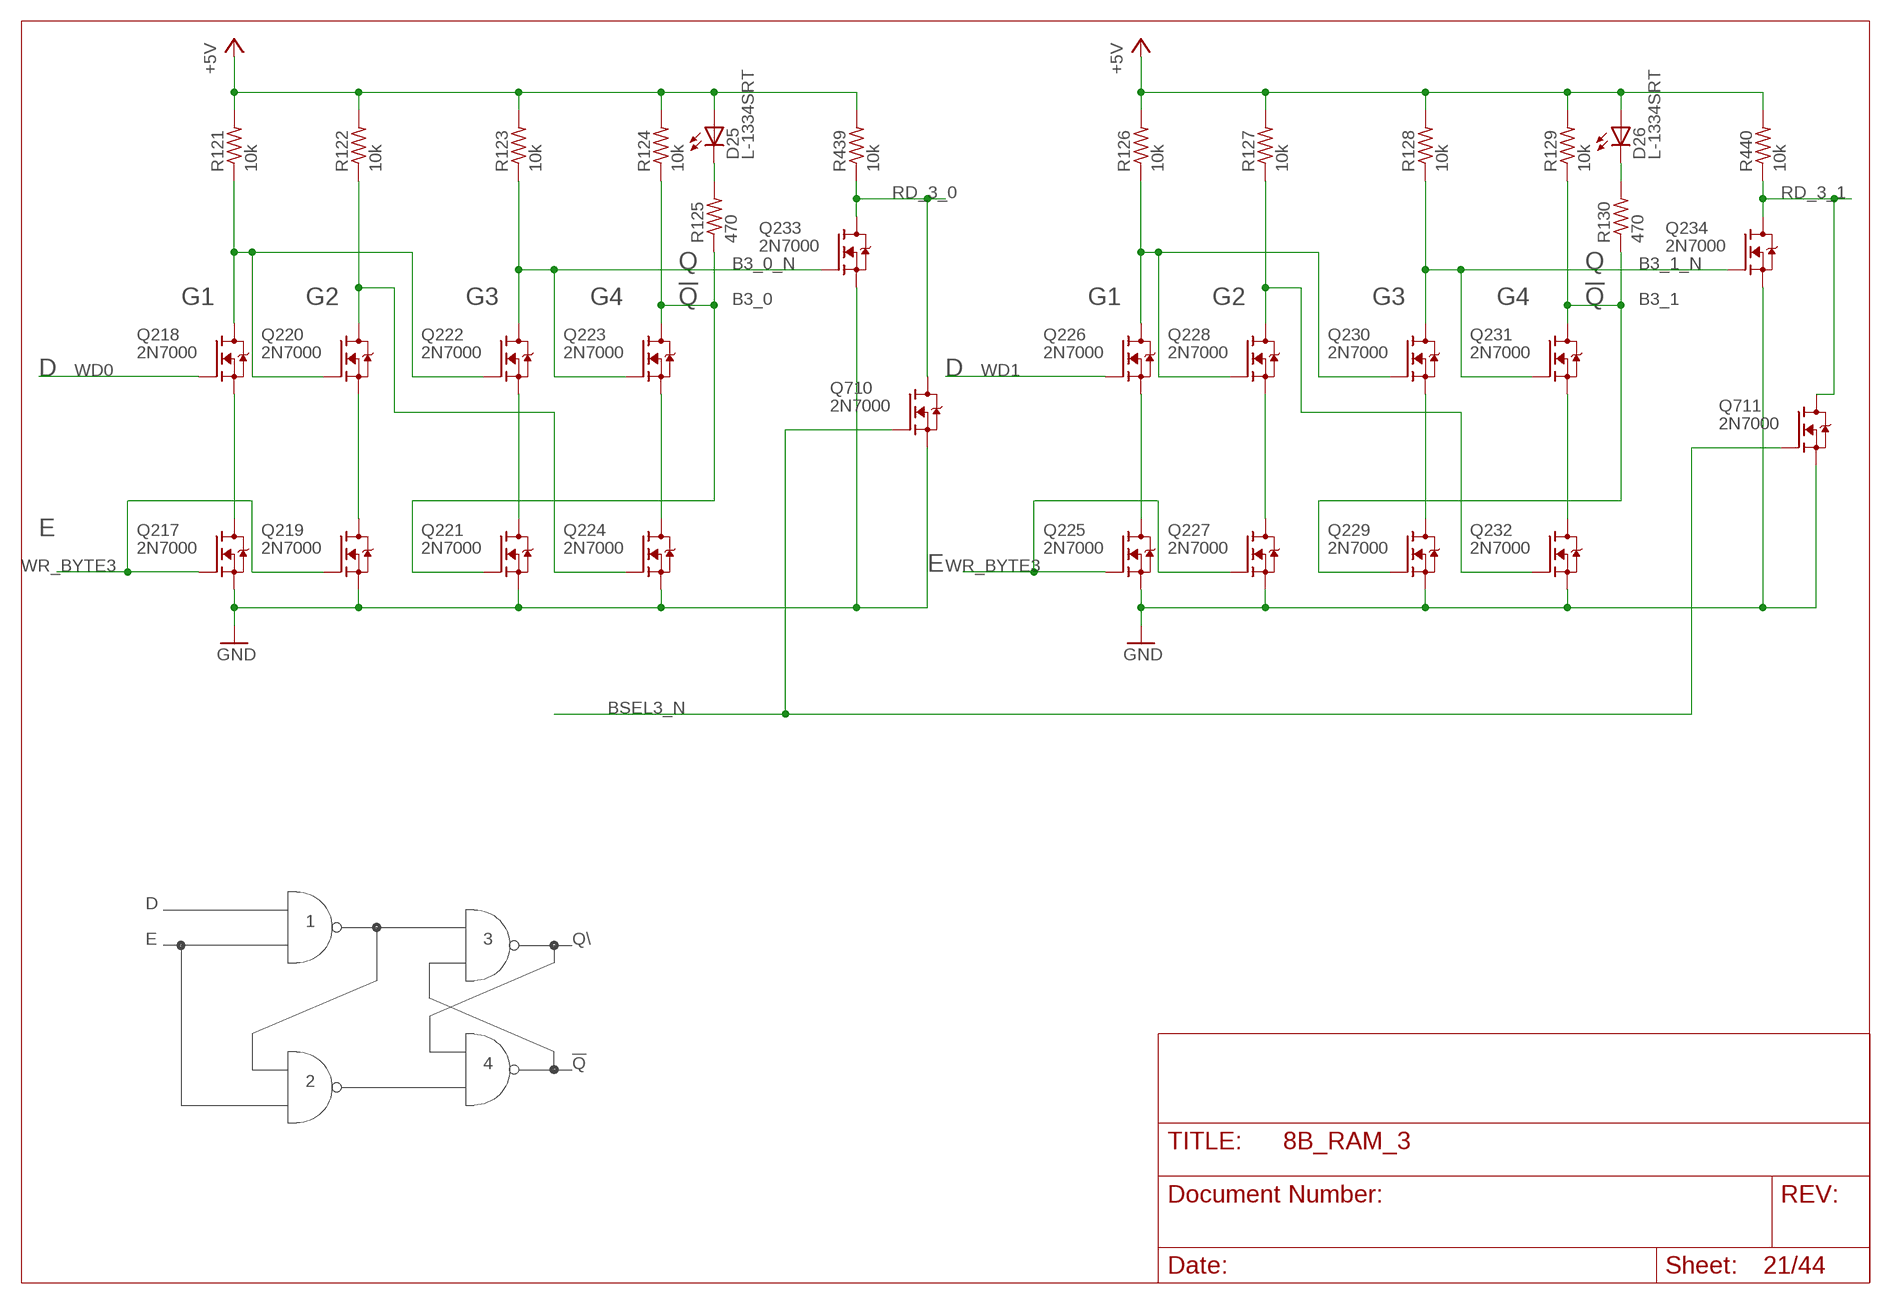
[diagram p20: schematic, sheet 21]

### Parts
D25  L-1334SRT  [LED3MM]
D26  L-1334SRT  [LED3MM]
Q217  2N7000  [TO92-DGS]
Q218  2N7000  [TO92-DGS]
Q219  2N7000  [TO92-DGS]
Q220  2N7000  [TO92-DGS]
Q221  2N7000  [TO92-DGS]
Q222  2N7000  [TO92-DGS]
Q223  2N7000  [TO92-DGS]
Q224  2N7000  [TO92-DGS]
Q225  2N7000  [TO92-DGS]
Q226  2N7000  [TO92-DGS]
Q227  2N7000  [TO92-DGS]
Q228  2N7000  [TO92-DGS]
Q229  2N7000  [TO92-DGS]
Q230  2N7000  [TO92-DGS]
Q231  2N7000  [TO92-DGS]
Q232  2N7000  [TO92-DGS]
Q233  2N7000  [TO92-DGS]
Q234  2N7000  [TO92-DGS]
Q710  2N7000  [TO92-DGS]
Q711  2N7000  [TO92-DGS]
R121  10k  R_P2INCH  [R_P2INCH]
R122  10k  R_P2INCH  [R_P2INCH]
R123  10k  R_P2INCH  [R_P2INCH]
R124  10k  R_P2INCH  [R_P2INCH]
R125  470  R_P2INCH  [R_P2INCH]
R126  10k  R_P2INCH  [R_P2INCH]
R127  10k  R_P2INCH  [R_P2INCH]
R128  10k  R_P2INCH  [R_P2INCH]
R129  10k  R_P2INCH  [R_P2INCH]
R130  470  R_P2INCH  [R_P2INCH]
R439  10k  R_P2INCH  [R_P2INCH]
R440  10k  R_P2INCH  [R_P2INCH]

### Nets
+5V: D25.A D26.A R121.2 R122.2 R123.2 R124.2 R126.2 R127.2 R128.2 R129.2 R439.2 R440.2 ; also sheet 2,4,5,6,7,8,9,10,11,12,13,14,15,16,17,18,19,20,22,23,24,25,26,27,28,29,30,31,32,33,34,35,36,37,38,39,40,41,42,43,44
B3_0: Q221.G Q223.D R124.1 R125.1
B3_0_N: Q222.D Q223.G Q233.G R123.1
B3_1: Q229.G Q231.D R129.1 R130.1
B3_1_N: Q230.D Q231.G Q234.G R128.1
BSEL3_N: Q710.G Q711.G ; also sheet 6,22,23,24
GND: Q217.S Q219.S Q221.S Q224.S Q225.S Q227.S Q229.S Q232.S Q233.S Q234.S Q710.S Q711.S ; also sheet 2,3,4,5,6,7,8,9,10,11,12,13,14,15,16,17,18,19,20,22,23,24,25,26,27,28,29,30,31,32,33,34,35,36,37,38,39,40,41,42,43,44
N$169: Q217.D Q218.S
N$170: Q219.D Q220.S
N$171: Q221.D Q222.S
N$172: Q218.D Q220.G Q222.G R121.1
N$173: Q220.D Q224.G R122.1
N$174: D25.K(C) R125.2
N$175: Q223.S Q224.D
N$176: Q225.D Q226.S
N$177: Q227.D Q228.S
N$178: Q229.D Q230.S
N$179: Q226.D Q228.G Q230.G R126.1
N$180: Q228.D Q232.G R127.1
N$181: D26.K(C) R130.2
N$182: Q231.S Q232.D
RD_3_0: Q233.D Q710.D R439.1 ; also sheet 41
RD_3_1: Q234.D Q711.D R440.1 ; also sheet 41
WD0: Q218.G ; also sheet 3,9,13,17,25,29,33,37
WD1: Q226.G ; also sheet 3,9,13,17,25,29,33,37
WR_BYTE3: Q217.G Q219.G Q225.G Q227.G ; also sheet 6,22,23,24

### Notes on the sheet
- Q | Q
- G1 | G2 | G3 | G4 | !Q | G1 | G2 | G3 | G4 | !Q
- D | D
- E
- E
- D
- 1
- E | 3 | Q\
- 4 | !Q
- 2

## Sheet 22 of 44
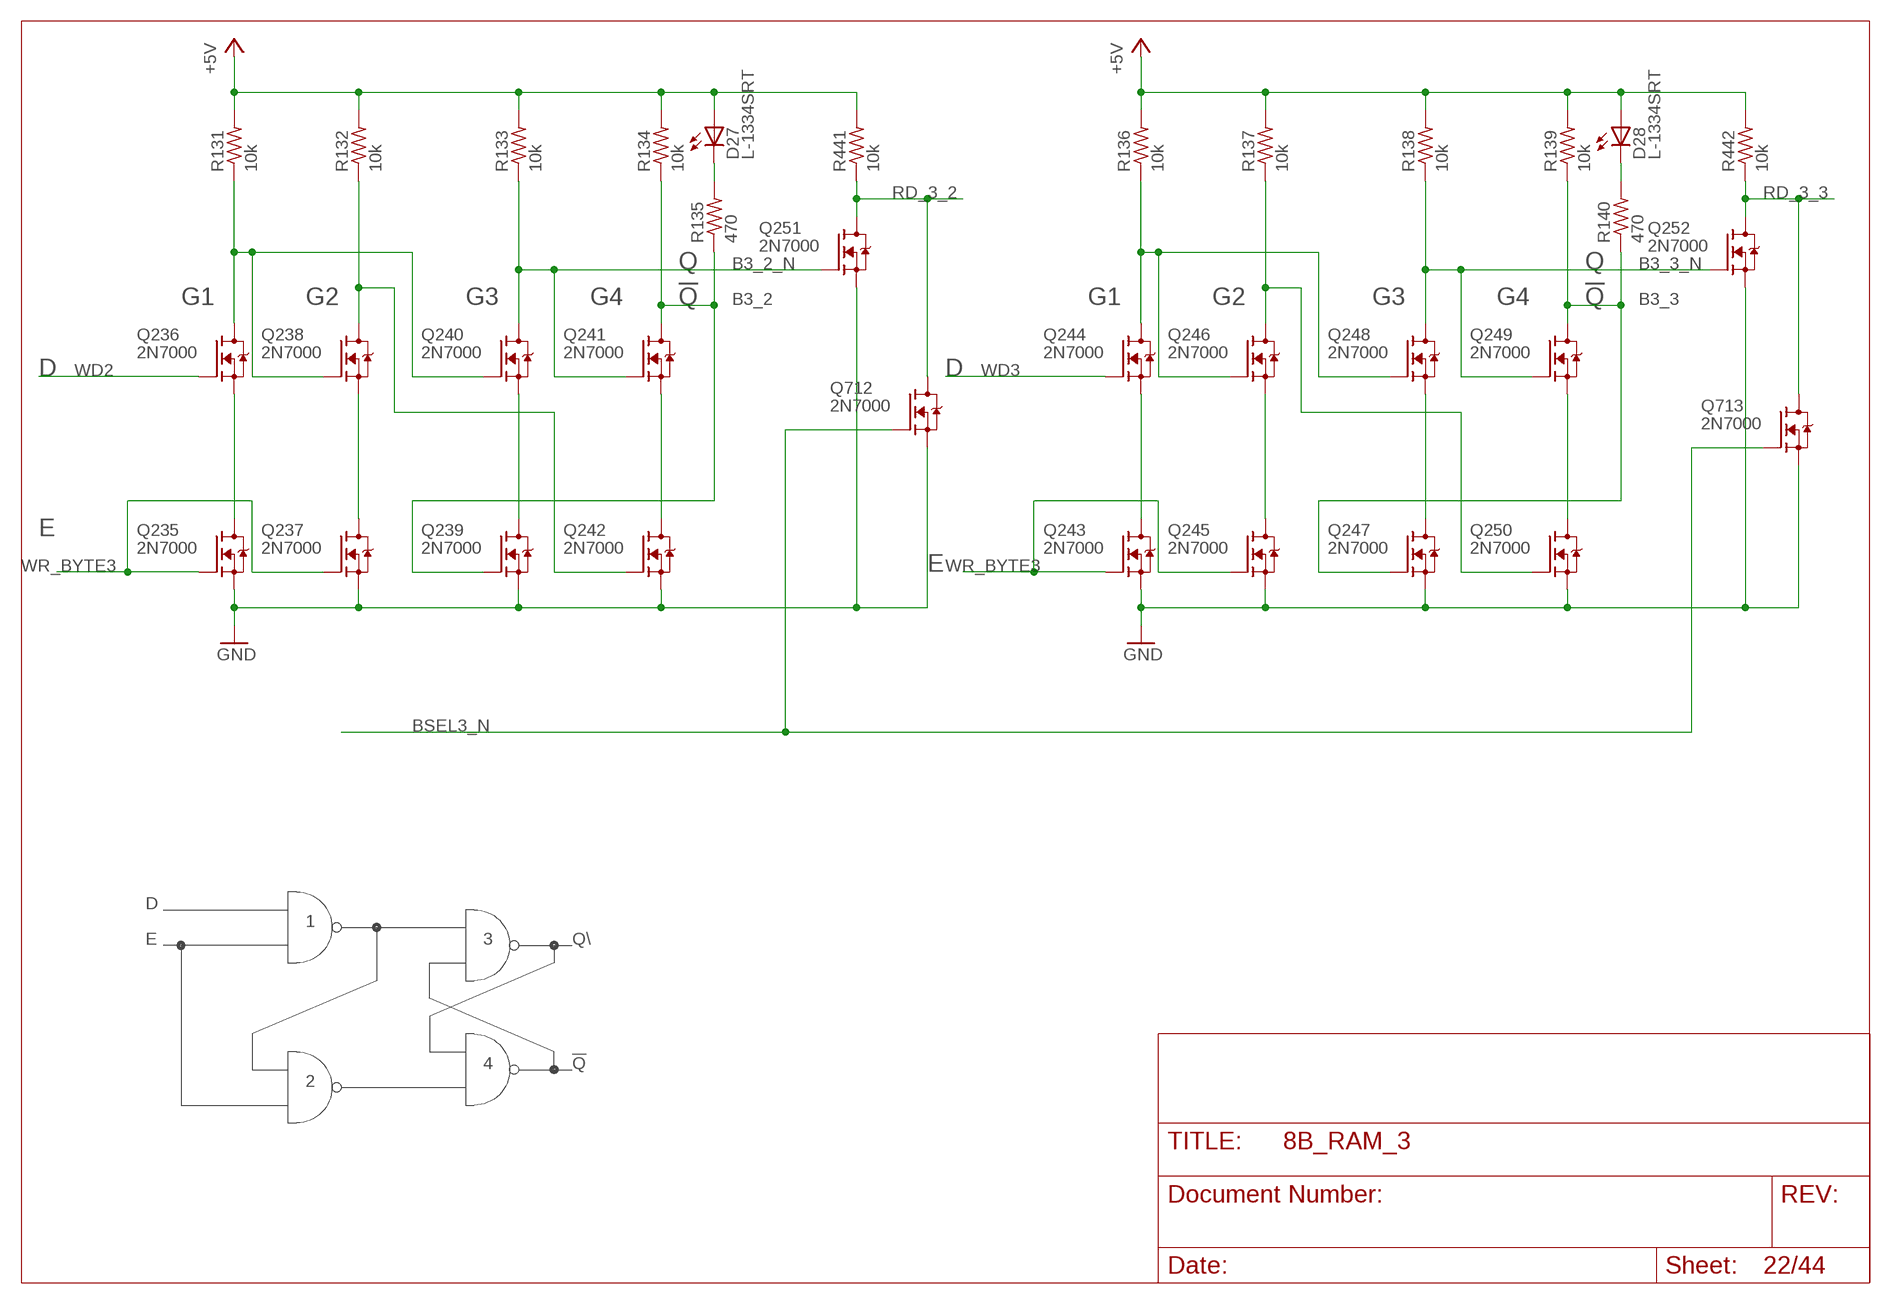
[diagram p21: schematic, sheet 22]

### Parts
D27  L-1334SRT  [LED3MM]
D28  L-1334SRT  [LED3MM]
Q235  2N7000  [TO92-DGS]
Q236  2N7000  [TO92-DGS]
Q237  2N7000  [TO92-DGS]
Q238  2N7000  [TO92-DGS]
Q239  2N7000  [TO92-DGS]
Q240  2N7000  [TO92-DGS]
Q241  2N7000  [TO92-DGS]
Q242  2N7000  [TO92-DGS]
Q243  2N7000  [TO92-DGS]
Q244  2N7000  [TO92-DGS]
Q245  2N7000  [TO92-DGS]
Q246  2N7000  [TO92-DGS]
Q247  2N7000  [TO92-DGS]
Q248  2N7000  [TO92-DGS]
Q249  2N7000  [TO92-DGS]
Q250  2N7000  [TO92-DGS]
Q251  2N7000  [TO92-DGS]
Q252  2N7000  [TO92-DGS]
Q712  2N7000  [TO92-DGS]
Q713  2N7000  [TO92-DGS]
R131  10k  R_P2INCH  [R_P2INCH]
R132  10k  R_P2INCH  [R_P2INCH]
R133  10k  R_P2INCH  [R_P2INCH]
R134  10k  R_P2INCH  [R_P2INCH]
R135  470  R_P2INCH  [R_P2INCH]
R136  10k  R_P2INCH  [R_P2INCH]
R137  10k  R_P2INCH  [R_P2INCH]
R138  10k  R_P2INCH  [R_P2INCH]
R139  10k  R_P2INCH  [R_P2INCH]
R140  470  R_P2INCH  [R_P2INCH]
R441  10k  R_P2INCH  [R_P2INCH]
R442  10k  R_P2INCH  [R_P2INCH]

### Nets
+5V: D27.A D28.A R131.2 R132.2 R133.2 R134.2 R136.2 R137.2 R138.2 R139.2 R441.2 R442.2 ; also sheet 2,4,5,6,7,8,9,10,11,12,13,14,15,16,17,18,19,20,21,23,24,25,26,27,28,29,30,31,32,33,34,35,36,37,38,39,40,41,42,43,44
B3_2: Q239.G Q241.D R134.1 R135.1
B3_2_N: Q240.D Q241.G Q251.G R133.1
B3_3: Q247.G Q249.D R139.1 R140.1
B3_3_N: Q248.D Q249.G Q252.G R138.1
BSEL3_N: Q712.G Q713.G ; also sheet 6,21,23,24
GND: Q235.S Q237.S Q239.S Q242.S Q243.S Q245.S Q247.S Q250.S Q251.S Q252.S Q712.S Q713.S ; also sheet 2,3,4,5,6,7,8,9,10,11,12,13,14,15,16,17,18,19,20,21,23,24,25,26,27,28,29,30,31,32,33,34,35,36,37,38,39,40,41,42,43,44
N$183: Q235.D Q236.S
N$184: Q237.D Q238.S
N$185: Q239.D Q240.S
N$186: Q236.D Q238.G Q240.G R131.1
N$187: Q238.D Q242.G R132.1
N$188: D27.K(C) R135.2
N$189: Q241.S Q242.D
N$190: Q243.D Q244.S
N$191: Q245.D Q246.S
N$192: Q247.D Q248.S
N$193: Q244.D Q246.G Q248.G R136.1
N$194: Q246.D Q250.G R137.1
N$195: D28.K(C) R140.2
N$196: Q249.S Q250.D
RD_3_2: Q251.D Q712.D R441.1 ; also sheet 42
RD_3_3: Q252.D Q713.D R442.1 ; also sheet 42
WD2: Q236.G ; also sheet 3,10,14,18,26,30,34,38
WD3: Q244.G ; also sheet 3,10,14,18,26,30,34,38
WR_BYTE3: Q235.G Q237.G Q243.G Q245.G ; also sheet 6,21,23,24

### Notes on the sheet
- Q | Q
- G1 | G2 | G3 | G4 | !Q | G1 | G2 | G3 | G4 | !Q
- D | D
- E
- E
- D
- 1
- E | 3 | Q\
- 4 | !Q
- 2

## Sheet 23 of 44
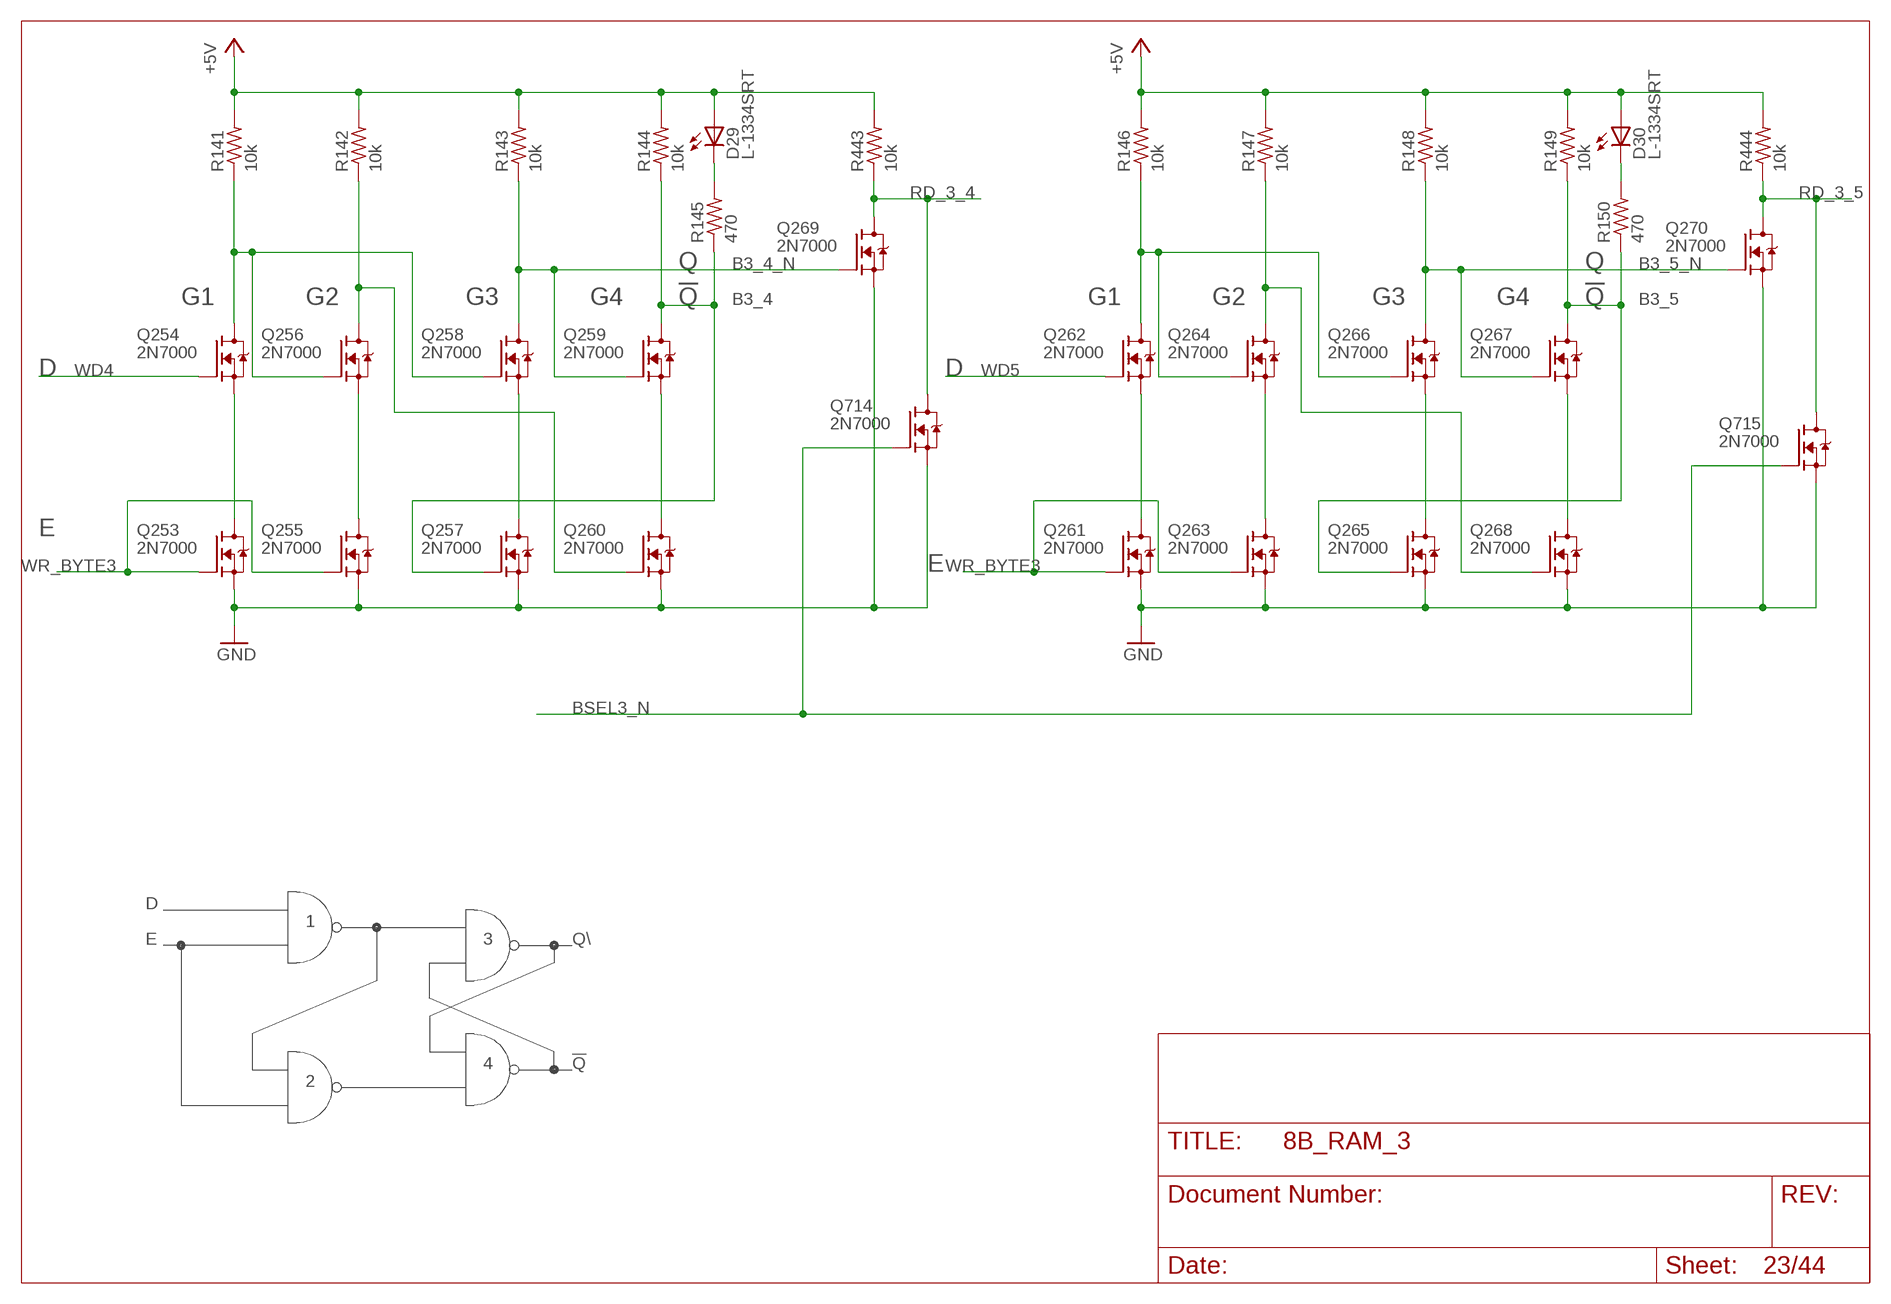
[diagram p22: schematic, sheet 23]

### Parts
D29  L-1334SRT  [LED3MM]
D30  L-1334SRT  [LED3MM]
Q253  2N7000  [TO92-DGS]
Q254  2N7000  [TO92-DGS]
Q255  2N7000  [TO92-DGS]
Q256  2N7000  [TO92-DGS]
Q257  2N7000  [TO92-DGS]
Q258  2N7000  [TO92-DGS]
Q259  2N7000  [TO92-DGS]
Q260  2N7000  [TO92-DGS]
Q261  2N7000  [TO92-DGS]
Q262  2N7000  [TO92-DGS]
Q263  2N7000  [TO92-DGS]
Q264  2N7000  [TO92-DGS]
Q265  2N7000  [TO92-DGS]
Q266  2N7000  [TO92-DGS]
Q267  2N7000  [TO92-DGS]
Q268  2N7000  [TO92-DGS]
Q269  2N7000  [TO92-DGS]
Q270  2N7000  [TO92-DGS]
Q714  2N7000  [TO92-DGS]
Q715  2N7000  [TO92-DGS]
R141  10k  R_P2INCH  [R_P2INCH]
R142  10k  R_P2INCH  [R_P2INCH]
R143  10k  R_P2INCH  [R_P2INCH]
R144  10k  R_P2INCH  [R_P2INCH]
R145  470  R_P2INCH  [R_P2INCH]
R146  10k  R_P2INCH  [R_P2INCH]
R147  10k  R_P2INCH  [R_P2INCH]
R148  10k  R_P2INCH  [R_P2INCH]
R149  10k  R_P2INCH  [R_P2INCH]
R150  470  R_P2INCH  [R_P2INCH]
R443  10k  R_P2INCH  [R_P2INCH]
R444  10k  R_P2INCH  [R_P2INCH]

### Nets
+5V: D29.A D30.A R141.2 R142.2 R143.2 R144.2 R146.2 R147.2 R148.2 R149.2 R443.2 R444.2 ; also sheet 2,4,5,6,7,8,9,10,11,12,13,14,15,16,17,18,19,20,21,22,24,25,26,27,28,29,30,31,32,33,34,35,36,37,38,39,40,41,42,43,44
B3_4: Q257.G Q259.D R144.1 R145.1
B3_4_N: Q258.D Q259.G Q269.G R143.1
B3_5: Q265.G Q267.D R149.1 R150.1
B3_5_N: Q266.D Q267.G Q270.G R148.1
BSEL3_N: Q714.G Q715.G ; also sheet 6,21,22,24
GND: Q253.S Q255.S Q257.S Q260.S Q261.S Q263.S Q265.S Q268.S Q269.S Q270.S Q714.S Q715.S ; also sheet 2,3,4,5,6,7,8,9,10,11,12,13,14,15,16,17,18,19,20,21,22,24,25,26,27,28,29,30,31,32,33,34,35,36,37,38,39,40,41,42,43,44
N$197: Q253.D Q254.S
N$198: Q255.D Q256.S
N$199: Q257.D Q258.S
N$200: Q254.D Q256.G Q258.G R141.1
N$201: Q256.D Q260.G R142.1
N$202: D29.K(C) R145.2
N$203: Q259.S Q260.D
N$204: Q261.D Q262.S
N$205: Q263.D Q264.S
N$206: Q265.D Q266.S
N$207: Q262.D Q264.G Q266.G R146.1
N$208: Q264.D Q268.G R147.1
N$209: D30.K(C) R150.2
N$210: Q267.S Q268.D
RD_3_4: Q269.D Q714.D R443.1 ; also sheet 43
RD_3_5: Q270.D Q715.D R444.1 ; also sheet 43
WD4: Q254.G ; also sheet 3,11,15,19,27,31,35,39
WD5: Q262.G ; also sheet 3,11,15,19,27,31,35,39
WR_BYTE3: Q253.G Q255.G Q261.G Q263.G ; also sheet 6,21,22,24

### Notes on the sheet
- Q | Q
- G1 | G2 | G3 | G4 | !Q | G1 | G2 | G3 | G4 | !Q
- D | D
- E
- E
- D
- 1
- E | 3 | Q\
- 4 | !Q
- 2

## Sheet 24 of 44
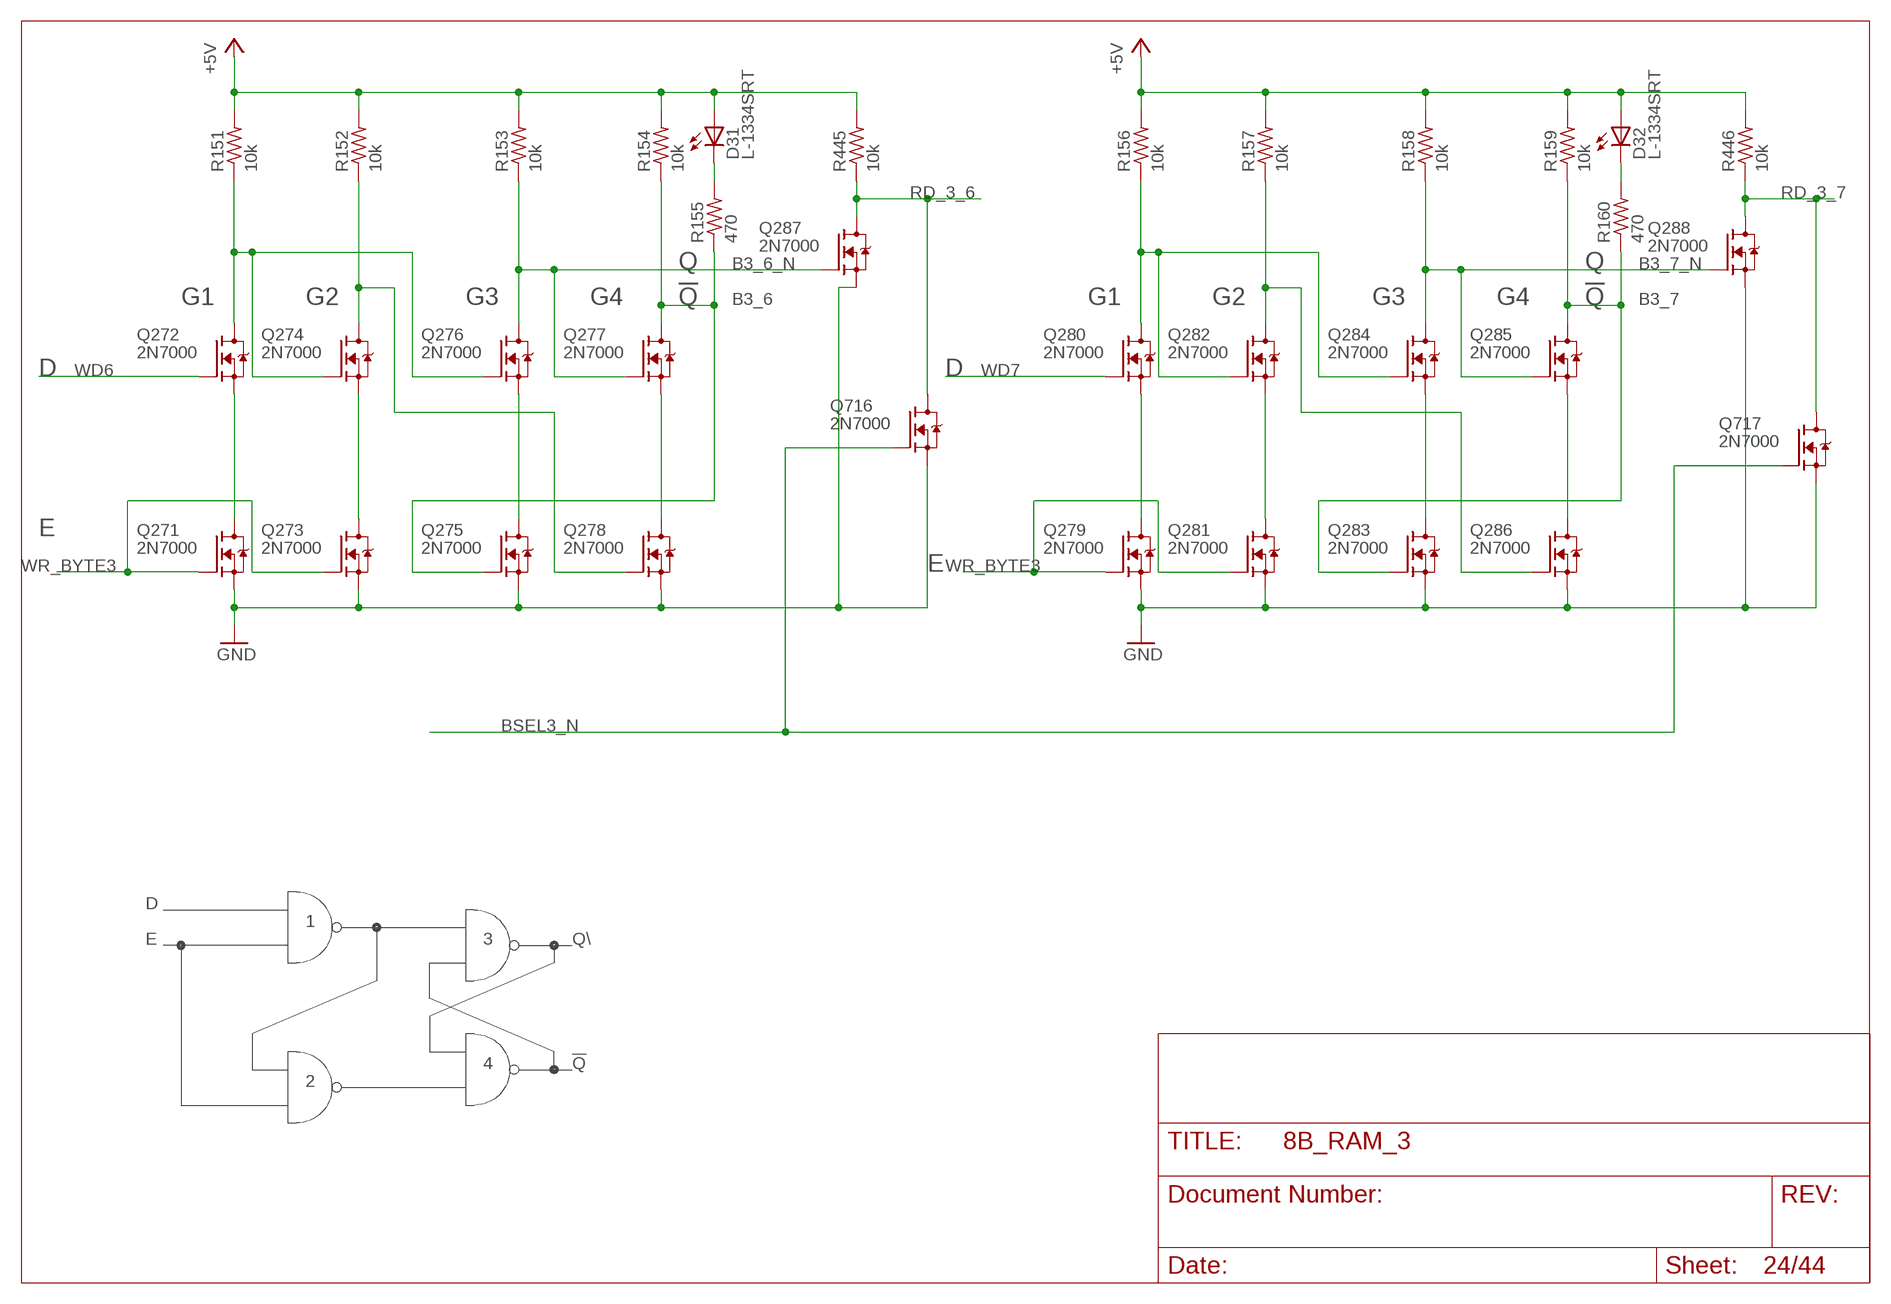
[diagram p23: schematic, sheet 24]

### Parts
D31  L-1334SRT  [LED3MM]
D32  L-1334SRT  [LED3MM]
Q271  2N7000  [TO92-DGS]
Q272  2N7000  [TO92-DGS]
Q273  2N7000  [TO92-DGS]
Q274  2N7000  [TO92-DGS]
Q275  2N7000  [TO92-DGS]
Q276  2N7000  [TO92-DGS]
Q277  2N7000  [TO92-DGS]
Q278  2N7000  [TO92-DGS]
Q279  2N7000  [TO92-DGS]
Q280  2N7000  [TO92-DGS]
Q281  2N7000  [TO92-DGS]
Q282  2N7000  [TO92-DGS]
Q283  2N7000  [TO92-DGS]
Q284  2N7000  [TO92-DGS]
Q285  2N7000  [TO92-DGS]
Q286  2N7000  [TO92-DGS]
Q287  2N7000  [TO92-DGS]
Q288  2N7000  [TO92-DGS]
Q716  2N7000  [TO92-DGS]
Q717  2N7000  [TO92-DGS]
R151  10k  R_P2INCH  [R_P2INCH]
R152  10k  R_P2INCH  [R_P2INCH]
R153  10k  R_P2INCH  [R_P2INCH]
R154  10k  R_P2INCH  [R_P2INCH]
R155  470  R_P2INCH  [R_P2INCH]
R156  10k  R_P2INCH  [R_P2INCH]
R157  10k  R_P2INCH  [R_P2INCH]
R158  10k  R_P2INCH  [R_P2INCH]
R159  10k  R_P2INCH  [R_P2INCH]
R160  470  R_P2INCH  [R_P2INCH]
R445  10k  R_P2INCH  [R_P2INCH]
R446  10k  R_P2INCH  [R_P2INCH]

### Nets
+5V: D31.A D32.A R151.2 R152.2 R153.2 R154.2 R156.2 R157.2 R158.2 R159.2 R445.2 R446.2 ; also sheet 2,4,5,6,7,8,9,10,11,12,13,14,15,16,17,18,19,20,21,22,23,25,26,27,28,29,30,31,32,33,34,35,36,37,38,39,40,41,42,43,44
B3_6: Q275.G Q277.D R154.1 R155.1
B3_6_N: Q276.D Q277.G Q287.G R153.1
B3_7: Q283.G Q285.D R159.1 R160.1
B3_7_N: Q284.D Q285.G Q288.G R158.1
BSEL3_N: Q716.G Q717.G ; also sheet 6,21,22,23
GND: Q271.S Q273.S Q275.S Q278.S Q279.S Q281.S Q283.S Q286.S Q287.S Q288.S Q716.S Q717.S ; also sheet 2,3,4,5,6,7,8,9,10,11,12,13,14,15,16,17,18,19,20,21,22,23,25,26,27,28,29,30,31,32,33,34,35,36,37,38,39,40,41,42,43,44
N$211: Q271.D Q272.S
N$212: Q273.D Q274.S
N$213: Q275.D Q276.S
N$214: Q272.D Q274.G Q276.G R151.1
N$215: Q274.D Q278.G R152.1
N$216: D31.K(C) R155.2
N$217: Q277.S Q278.D
N$218: Q279.D Q280.S
N$219: Q281.D Q282.S
N$220: Q283.D Q284.S
N$221: Q280.D Q282.G Q284.G R156.1
N$222: Q282.D Q286.G R157.1
N$223: D32.K(C) R160.2
N$224: Q285.S Q286.D
RD_3_6: Q287.D Q716.D R445.1 ; also sheet 44
RD_3_7: Q288.D Q717.D R446.1 ; also sheet 44
WD6: Q272.G ; also sheet 3,12,16,20,28,32,36,40
WD7: Q280.G ; also sheet 3,12,16,20,28,32,36,40
WR_BYTE3: Q271.G Q273.G Q279.G Q281.G ; also sheet 6,21,22,23

### Notes on the sheet
- Q | Q
- G1 | G2 | G3 | G4 | !Q | G1 | G2 | G3 | G4 | !Q
- D | D
- E
- E
- D
- 1
- E | 3 | Q\
- 4 | !Q
- 2